# EAGLE schematic MEM_MUX_3 (EAGLE 6.5.0)

## Sheet 1 of 18
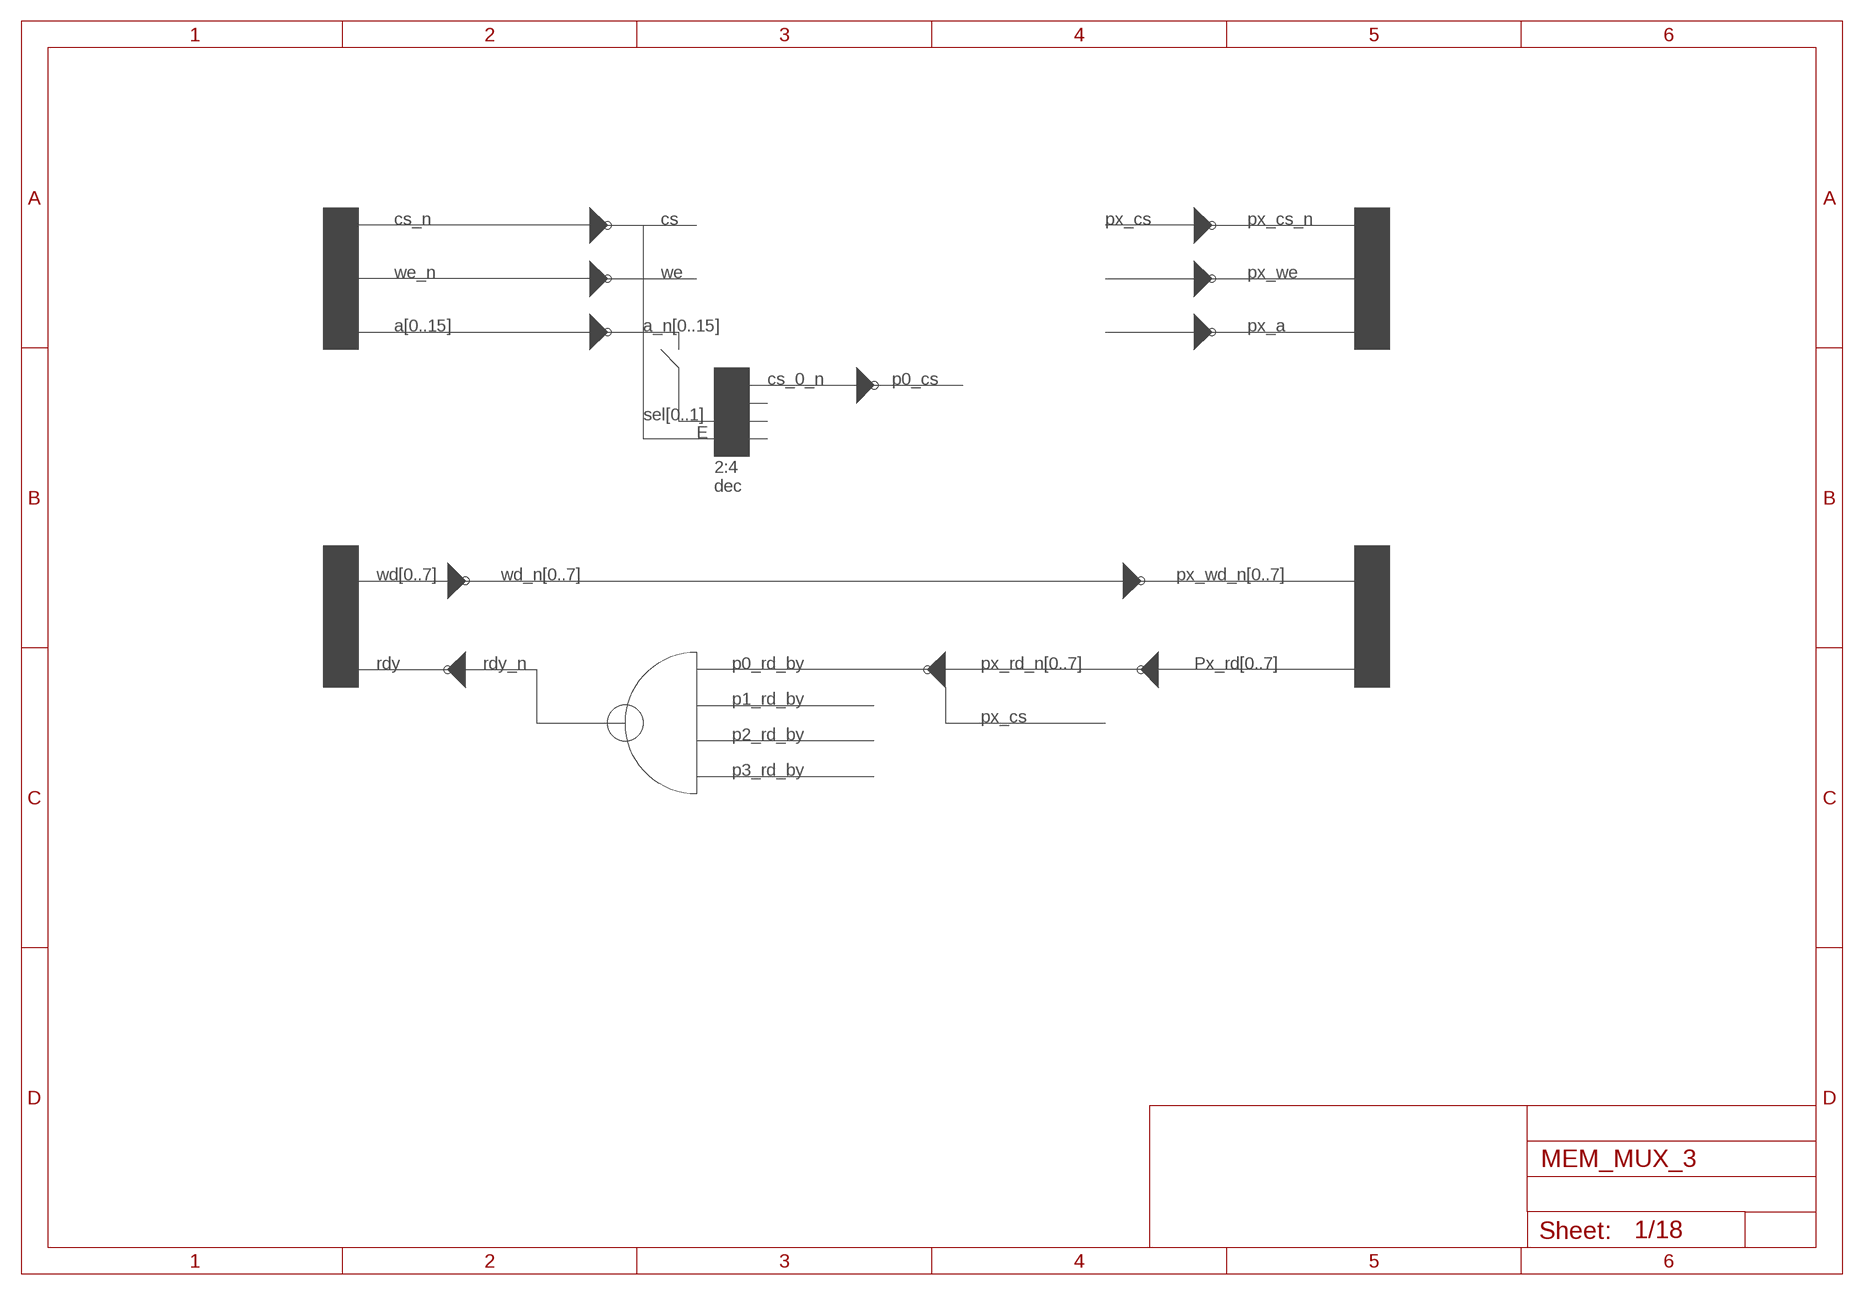
[diagram p0: schematic, sheet 1]

### Notes on the sheet
- cs_n | cs | px_cs | px_cs_n
- we_n | we | px_we
- a[0..15] | a_n[0..15] | px_a
- cs_0_n | p0_cs
- sel[0..1]
- E
- 2:4
  dec
- wd[0..7] | wd_n[0..7] | px_wd_n[0..7]
- rdy | rdy_n | p0_rd_by | px_rd_n[0..7] | Px_rd[0..7]
- p1_rd_by
- px_cs
- p2_rd_by
- p3_rd_by

## Sheet 2 of 18
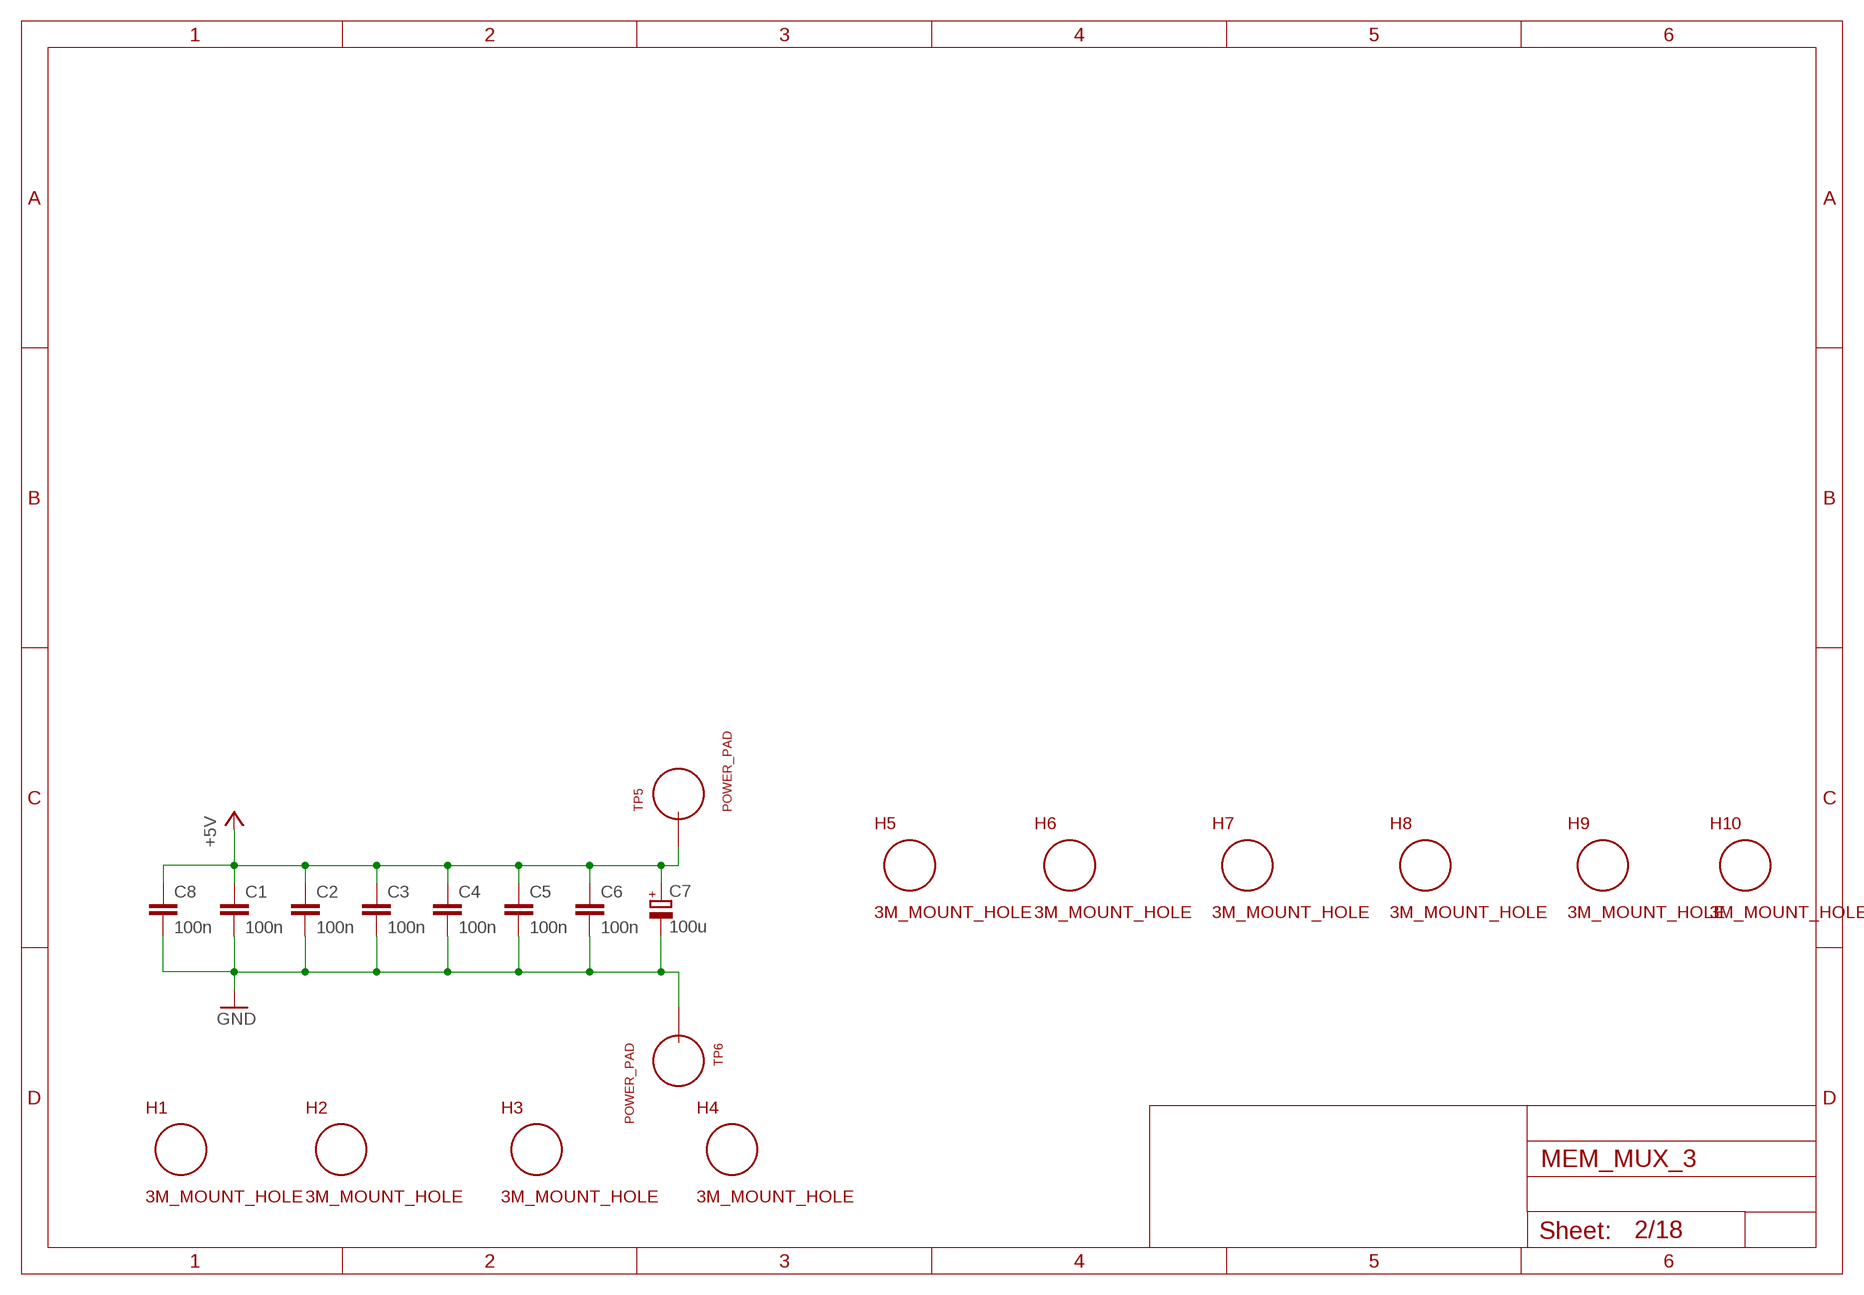
[diagram p1: schematic, sheet 2]

### Parts
C1  100n  C_P2INCH  [CAP_P2INCH]
C2  100n  C_P2INCH  [CAP_P2INCH]
C3  100n  C_P2INCH  [CAP_P2INCH]
C4  100n  C_P2INCH  [CAP_P2INCH]
C5  100n  C_P2INCH  [CAP_P2INCH]
C6  100n  C_P2INCH  [CAP_P2INCH]
C7  100u  POLARISED_CAP_2P5_6P3MM  [POLARISED_CAP_2P5_6P3MM]
C8  100n  C_P2INCH  [CAP_P2INCH]
H1  3M_MOUNT_HOLE  [3M_HOLE]
H2  3M_MOUNT_HOLE  [3M_HOLE]
H3  3M_MOUNT_HOLE  [3M_HOLE]
H4  3M_MOUNT_HOLE  [3M_HOLE]
H5  3M_MOUNT_HOLE  [3M_HOLE]
H6  3M_MOUNT_HOLE  [3M_HOLE]
H7  3M_MOUNT_HOLE  [3M_HOLE]
H8  3M_MOUNT_HOLE  [3M_HOLE]
H9  3M_MOUNT_HOLE  [3M_HOLE]
H10  3M_MOUNT_HOLE  [3M_HOLE]
TP5  POWER_PAD  [POWER_PAD]
TP6  POWER_PAD  [POWER_PAD]

### Nets
+5V: C1.1 C2.1 C3.1 C4.1 C5.1 C6.1 C7.A C8.1 TP5.1 ; also sheet 3,4,5,6,7,8,9,10,11,12,13,14,15,16,17,18
GND: C1.2 C2.2 C3.2 C4.2 C5.2 C6.2 C7.K C8.2 TP6.1 ; also sheet 3,4,5,6,7,8,9,10,11,12,13,14,15,16,17,18

## Sheet 3 of 18
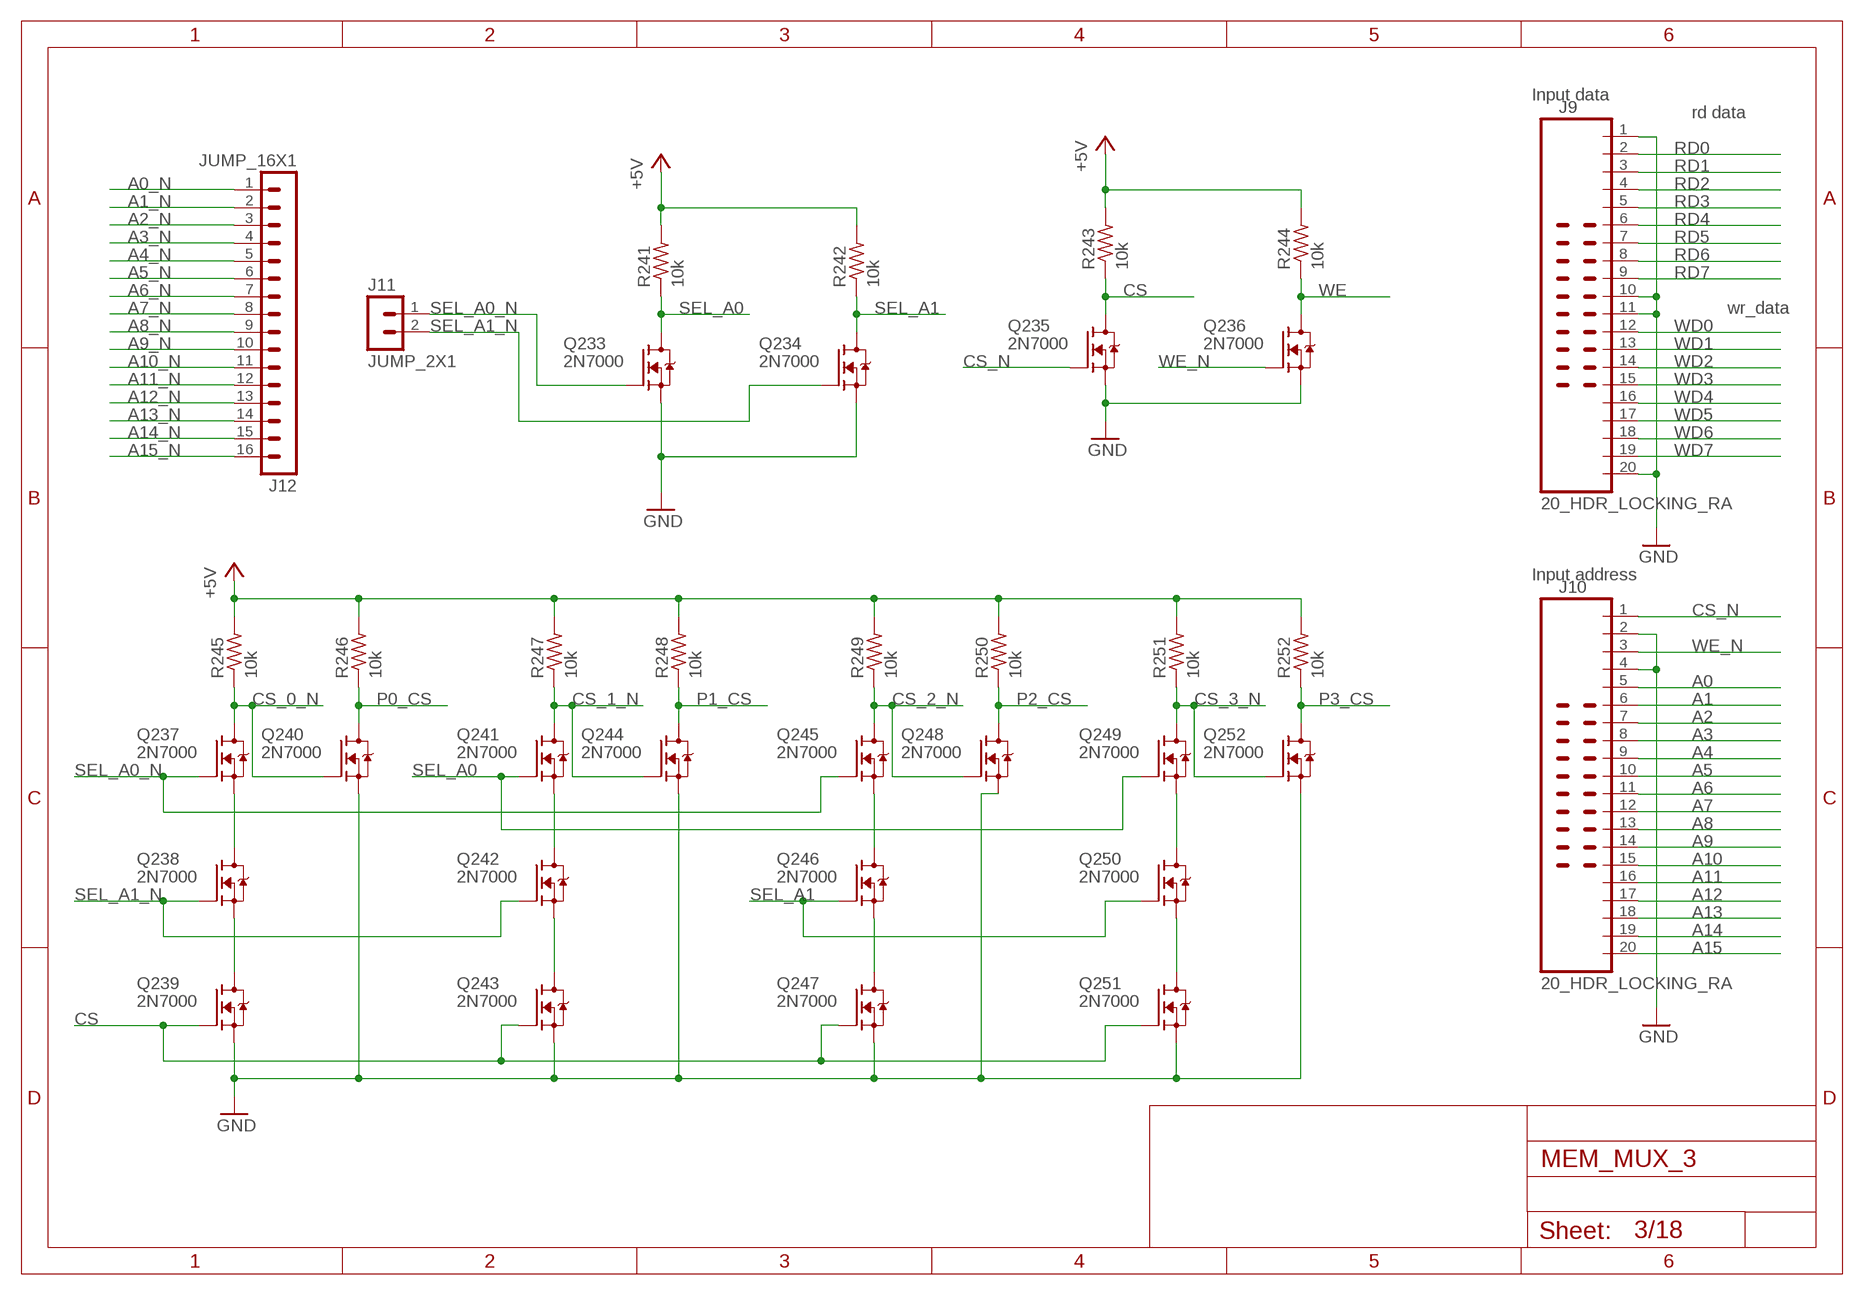
[diagram p2: schematic, sheet 3]

### Parts
J9  20_HDR_LOCKING_RA  [20_HDR_LOCKING_RA]
J10  20_HDR_LOCKING_RA  [20_HDR_LOCKING_RA]
J11  JUMP_2X1  [JUMP_2X1]
J12  JUMP_16X1  [JUMP_16X1]
Q233  2N7000  [TO92-DGS]
Q234  2N7000  [TO92-DGS]
Q235  2N7000  [TO92-DGS]
Q236  2N7000  [TO92-DGS]
Q237  2N7000  [TO92-DGS]
Q238  2N7000  [TO92-DGS]
Q239  2N7000  [TO92-DGS]
Q240  2N7000  [TO92-DGS]
Q241  2N7000  [TO92-DGS]
Q242  2N7000  [TO92-DGS]
Q243  2N7000  [TO92-DGS]
Q244  2N7000  [TO92-DGS]
Q245  2N7000  [TO92-DGS]
Q246  2N7000  [TO92-DGS]
Q247  2N7000  [TO92-DGS]
Q248  2N7000  [TO92-DGS]
Q249  2N7000  [TO92-DGS]
Q250  2N7000  [TO92-DGS]
Q251  2N7000  [TO92-DGS]
Q252  2N7000  [TO92-DGS]
R241  10k  R_P2INCH  [R_P2INCH]
R242  10k  R_P2INCH  [R_P2INCH]
R243  10k  R_P2INCH  [R_P2INCH]
R244  10k  R_P2INCH  [R_P2INCH]
R245  10k  R_P2INCH  [R_P2INCH]
R246  10k  R_P2INCH  [R_P2INCH]
R247  10k  R_P2INCH  [R_P2INCH]
R248  10k  R_P2INCH  [R_P2INCH]
R249  10k  R_P2INCH  [R_P2INCH]
R250  10k  R_P2INCH  [R_P2INCH]
R251  10k  R_P2INCH  [R_P2INCH]
R252  10k  R_P2INCH  [R_P2INCH]

### Nets
+5V: R241.2 R242.2 R243.2 R244.2 R245.2 R246.2 R247.2 R248.2 R249.2 R250.2 R251.2 R252.2 ; also sheet 2,4,5,6,7,8,9,10,11,12,13,14,15,16,17,18
A0: J10.5 ; also sheet 4
A0_N: J12.1 ; also sheet 4,7,10,13,16
A1: J10.6 ; also sheet 4
A1_N: J12.2 ; also sheet 4,7,10,13,16
A2: J10.7 ; also sheet 4
A2_N: J12.3 ; also sheet 4,7,10,13,16
A3: J10.8 ; also sheet 4
A3_N: J12.4 ; also sheet 4,7,10,13,16
A4: J10.9 ; also sheet 4
A4_N: J12.5 ; also sheet 4,7,10,13,16
A5: J10.10 ; also sheet 4
A5_N: J12.6 ; also sheet 4,7,10,13,16
A6: J10.11 ; also sheet 4
A6_N: J12.7 ; also sheet 4,7,10,13,16
A7: J10.12 ; also sheet 4
A7_N: J12.8 ; also sheet 4,7,10,13,16
A8: J10.13 ; also sheet 4
A8_N: J12.9 ; also sheet 4,7,10,13,16
A9: J10.14 ; also sheet 4
A9_N: J12.10 ; also sheet 4,7,10,13,16
A10: J10.15 ; also sheet 4
A10_N: J12.11 ; also sheet 4,7,10,13,16
A11: J10.16 ; also sheet 4
A11_N: J12.12 ; also sheet 4,7,10,13,16
A12: J10.17 ; also sheet 4
A12_N: J12.13 ; also sheet 4,7,10,13,16
A13: J10.18 ; also sheet 4
A13_N: J12.14 ; also sheet 4,7,10,13,16
A14: J10.19 ; also sheet 4
A14_N: J12.15 ; also sheet 4,7,10,13,16
A15: J10.20 ; also sheet 4
A15_N: J12.16 ; also sheet 4,7,10,13,16
CS: Q235.D Q239.G Q243.G Q247.G Q251.G R243.1
CS_0_N: Q237.D Q240.G R245.1 ; also sheet 5
CS_1_N: Q241.D Q244.G R247.1 ; also sheet 8
CS_2_N: Q245.D Q248.G R249.1 ; also sheet 11
CS_3_N: Q249.D Q252.G R251.1 ; also sheet 14
CS_N: J10.1 Q235.G
GND: J9.1 J9.10 J9.11 J9.20 J10.2 J10.4 Q233.S Q234.S Q235.S Q236.S Q239.S Q240.S Q243.S Q244.S Q247.S Q248.S Q251.S Q252.S ; also sheet 2,4,5,6,7,8,9,10,11,12,13,14,15,16,17,18
N$100: Q241.S Q242.D
N$101: Q237.S Q238.D
N$102: Q238.S Q239.D
N$103: Q242.S Q243.D
N$104: Q245.S Q246.D
N$105: Q246.S Q247.D
N$106: Q249.S Q250.D
N$107: Q250.S Q251.D
P0_CS: Q240.D R246.1 ; also sheet 6
P1_CS: Q244.D R248.1 ; also sheet 9
P2_CS: Q248.D R250.1 ; also sheet 12
P3_CS: Q252.D R252.1 ; also sheet 15
RD0: J9.2 ; also sheet 17
RD1: J9.3 ; also sheet 17
RD2: J9.4 ; also sheet 17
RD3: J9.5 ; also sheet 17
RD4: J9.6 ; also sheet 18
RD5: J9.7 ; also sheet 18
RD6: J9.8 ; also sheet 18
RD7: J9.9 ; also sheet 18
SEL_A0: Q233.D Q241.G Q249.G R241.1
SEL_A0_N: J11.1 Q233.G Q237.G Q245.G
SEL_A1: Q234.D Q246.G Q250.G R242.1
SEL_A1_N: J11.2 Q234.G Q238.G Q242.G
WD0: J9.12 ; also sheet 4
WD1: J9.13 ; also sheet 4
WD2: J9.14 ; also sheet 4
WD3: J9.15 ; also sheet 4
WD4: J9.16 ; also sheet 4
WD5: J9.17 ; also sheet 4
WD6: J9.18 ; also sheet 4
WD7: J9.19 ; also sheet 4
WE: Q236.D R244.1 ; also sheet 6,9,12,15
WE_N: J10.3 Q236.G

### Notes on the sheet
- Input data
- rd data
- wr_data
- Input address

## Sheet 4 of 18
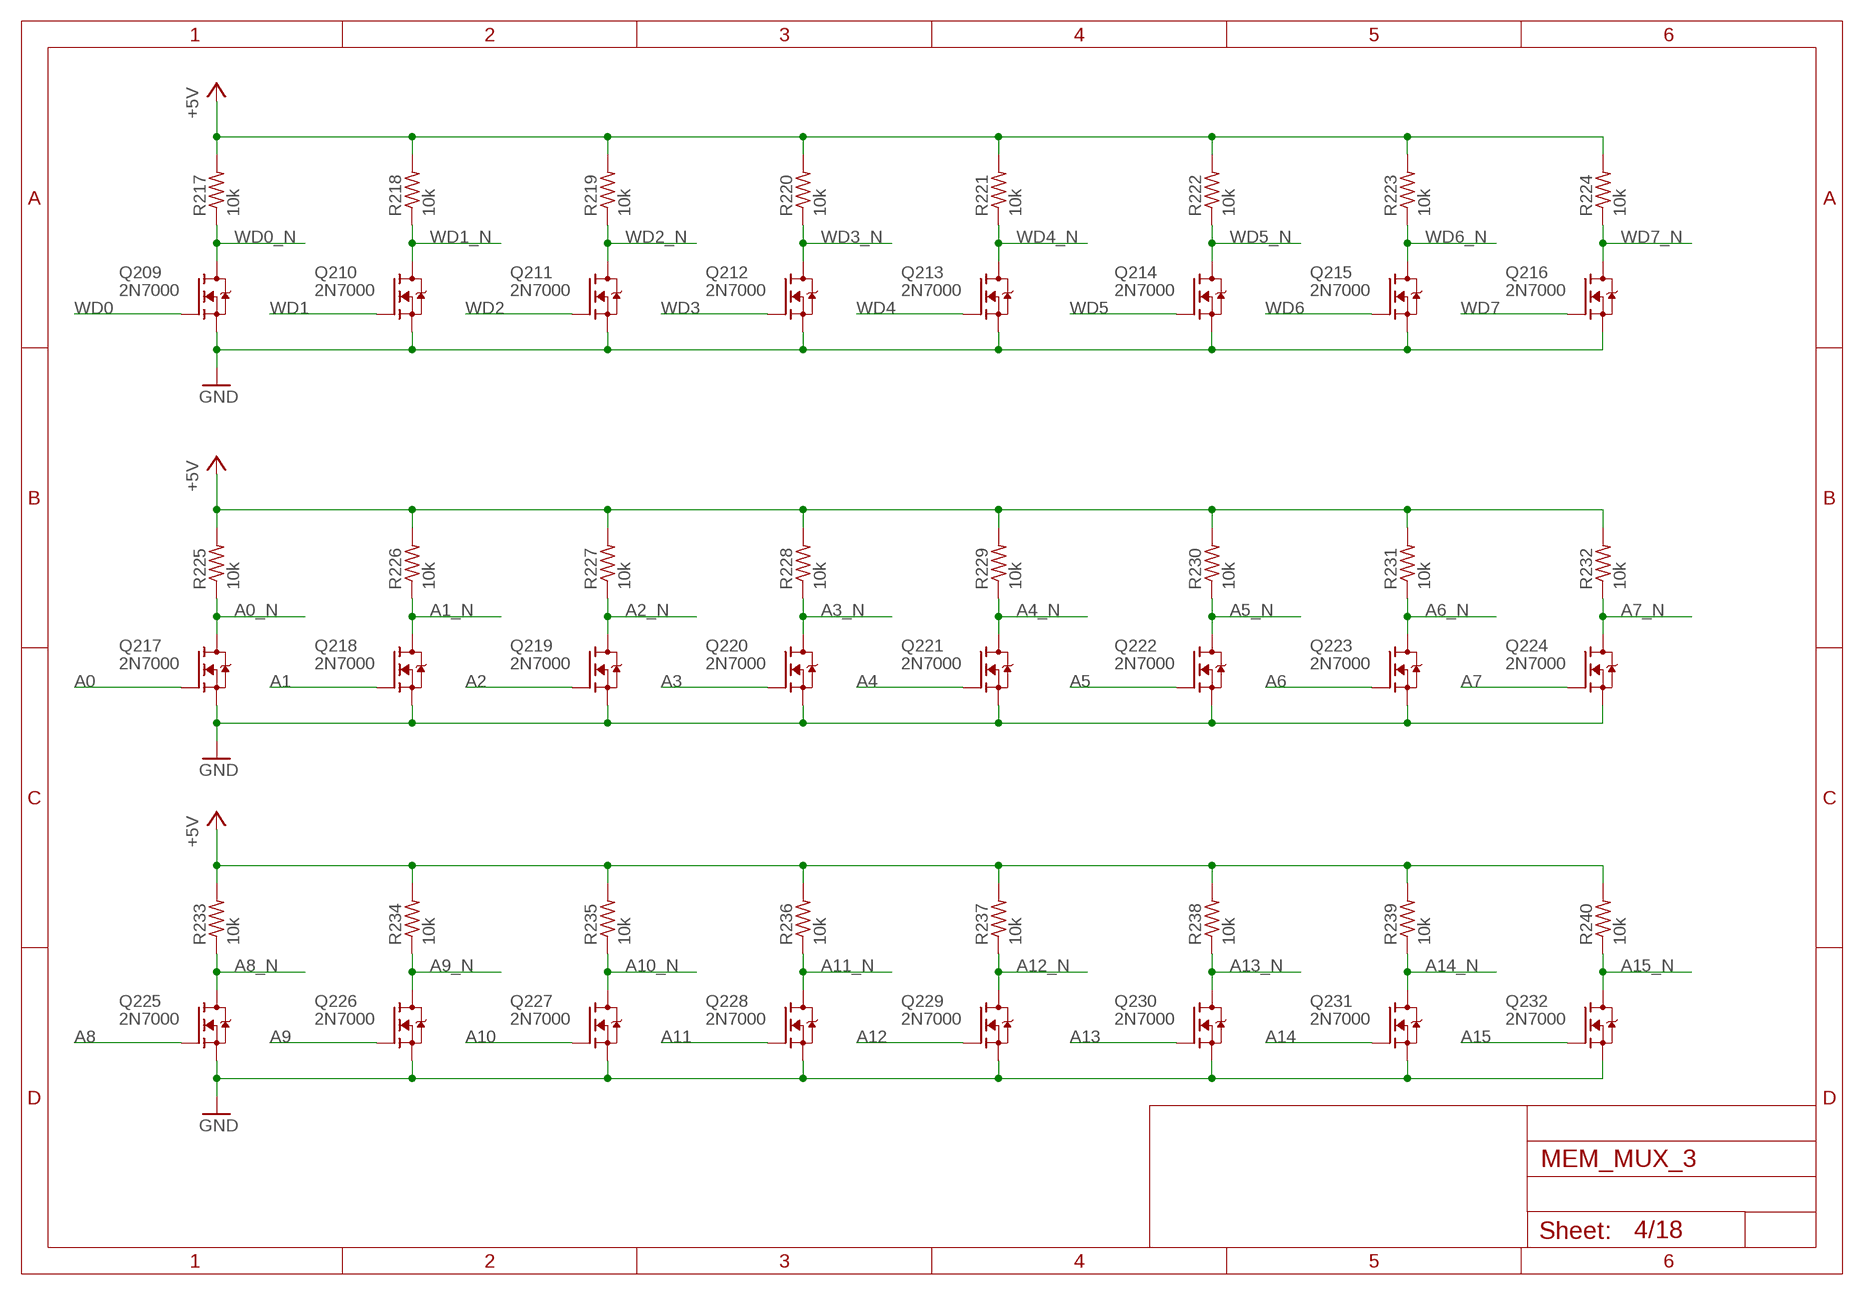
[diagram p3: schematic, sheet 4]

### Parts
Q209  2N7000  [TO92-DGS]
Q210  2N7000  [TO92-DGS]
Q211  2N7000  [TO92-DGS]
Q212  2N7000  [TO92-DGS]
Q213  2N7000  [TO92-DGS]
Q214  2N7000  [TO92-DGS]
Q215  2N7000  [TO92-DGS]
Q216  2N7000  [TO92-DGS]
Q217  2N7000  [TO92-DGS]
Q218  2N7000  [TO92-DGS]
Q219  2N7000  [TO92-DGS]
Q220  2N7000  [TO92-DGS]
Q221  2N7000  [TO92-DGS]
Q222  2N7000  [TO92-DGS]
Q223  2N7000  [TO92-DGS]
Q224  2N7000  [TO92-DGS]
Q225  2N7000  [TO92-DGS]
Q226  2N7000  [TO92-DGS]
Q227  2N7000  [TO92-DGS]
Q228  2N7000  [TO92-DGS]
Q229  2N7000  [TO92-DGS]
Q230  2N7000  [TO92-DGS]
Q231  2N7000  [TO92-DGS]
Q232  2N7000  [TO92-DGS]
R217  10k  R_P2INCH  [R_P2INCH]
R218  10k  R_P2INCH  [R_P2INCH]
R219  10k  R_P2INCH  [R_P2INCH]
R220  10k  R_P2INCH  [R_P2INCH]
R221  10k  R_P2INCH  [R_P2INCH]
R222  10k  R_P2INCH  [R_P2INCH]
R223  10k  R_P2INCH  [R_P2INCH]
R224  10k  R_P2INCH  [R_P2INCH]
R225  10k  R_P2INCH  [R_P2INCH]
R226  10k  R_P2INCH  [R_P2INCH]
R227  10k  R_P2INCH  [R_P2INCH]
R228  10k  R_P2INCH  [R_P2INCH]
R229  10k  R_P2INCH  [R_P2INCH]
R230  10k  R_P2INCH  [R_P2INCH]
R231  10k  R_P2INCH  [R_P2INCH]
R232  10k  R_P2INCH  [R_P2INCH]
R233  10k  R_P2INCH  [R_P2INCH]
R234  10k  R_P2INCH  [R_P2INCH]
R235  10k  R_P2INCH  [R_P2INCH]
R236  10k  R_P2INCH  [R_P2INCH]
R237  10k  R_P2INCH  [R_P2INCH]
R238  10k  R_P2INCH  [R_P2INCH]
R239  10k  R_P2INCH  [R_P2INCH]
R240  10k  R_P2INCH  [R_P2INCH]

### Nets
+5V: R217.2 R218.2 R219.2 R220.2 R221.2 R222.2 R223.2 R224.2 R225.2 R226.2 R227.2 R228.2 R229.2 R230.2 R231.2 R232.2 R233.2 R234.2 R235.2 R236.2 R237.2 R238.2 R239.2 R240.2 ; also sheet 2,3,5,6,7,8,9,10,11,12,13,14,15,16,17,18
A0: Q217.G ; also sheet 3
A0_N: Q217.D R225.1 ; also sheet 3,7,10,13,16
A1: Q218.G ; also sheet 3
A1_N: Q218.D R226.1 ; also sheet 3,7,10,13,16
A2: Q219.G ; also sheet 3
A2_N: Q219.D R227.1 ; also sheet 3,7,10,13,16
A3: Q220.G ; also sheet 3
A3_N: Q220.D R228.1 ; also sheet 3,7,10,13,16
A4: Q221.G ; also sheet 3
A4_N: Q221.D R229.1 ; also sheet 3,7,10,13,16
A5: Q222.G ; also sheet 3
A5_N: Q222.D R230.1 ; also sheet 3,7,10,13,16
A6: Q223.G ; also sheet 3
A6_N: Q223.D R231.1 ; also sheet 3,7,10,13,16
A7: Q224.G ; also sheet 3
A7_N: Q224.D R232.1 ; also sheet 3,7,10,13,16
A8: Q225.G ; also sheet 3
A8_N: Q225.D R233.1 ; also sheet 3,7,10,13,16
A9: Q226.G ; also sheet 3
A9_N: Q226.D R234.1 ; also sheet 3,7,10,13,16
A10: Q227.G ; also sheet 3
A10_N: Q227.D R235.1 ; also sheet 3,7,10,13,16
A11: Q228.G ; also sheet 3
A11_N: Q228.D R236.1 ; also sheet 3,7,10,13,16
A12: Q229.G ; also sheet 3
A12_N: Q229.D R237.1 ; also sheet 3,7,10,13,16
A13: Q230.G ; also sheet 3
A13_N: Q230.D R238.1 ; also sheet 3,7,10,13,16
A14: Q231.G ; also sheet 3
A14_N: Q231.D R239.1 ; also sheet 3,7,10,13,16
A15: Q232.G ; also sheet 3
A15_N: Q232.D R240.1 ; also sheet 3,7,10,13,16
GND: Q209.S Q210.S Q211.S Q212.S Q213.S Q214.S Q215.S Q216.S Q217.S Q218.S Q219.S Q220.S Q221.S Q222.S Q223.S Q224.S Q225.S Q226.S Q227.S Q228.S Q229.S Q230.S Q231.S Q232.S ; also sheet 2,3,5,6,7,8,9,10,11,12,13,14,15,16,17,18
WD0: Q209.G ; also sheet 3
WD0_N: Q209.D R217.1 ; also sheet 7,10,13,16
WD1: Q210.G ; also sheet 3
WD1_N: Q210.D R218.1 ; also sheet 7,10,13,16
WD2: Q211.G ; also sheet 3
WD2_N: Q211.D R219.1 ; also sheet 7,10,13,16
WD3: Q212.G ; also sheet 3
WD3_N: Q212.D R220.1 ; also sheet 7,10,13,16
WD4: Q213.G ; also sheet 3
WD4_N: Q213.D R221.1 ; also sheet 7,10,13,16
WD5: Q214.G ; also sheet 3
WD5_N: Q214.D R222.1 ; also sheet 7,10,13,16
WD6: Q215.G ; also sheet 3
WD6_N: Q215.D R223.1 ; also sheet 7,10,13,16
WD7: Q216.G ; also sheet 3
WD7_N: Q216.D R224.1 ; also sheet 7,10,13,16

## Sheet 5 of 18
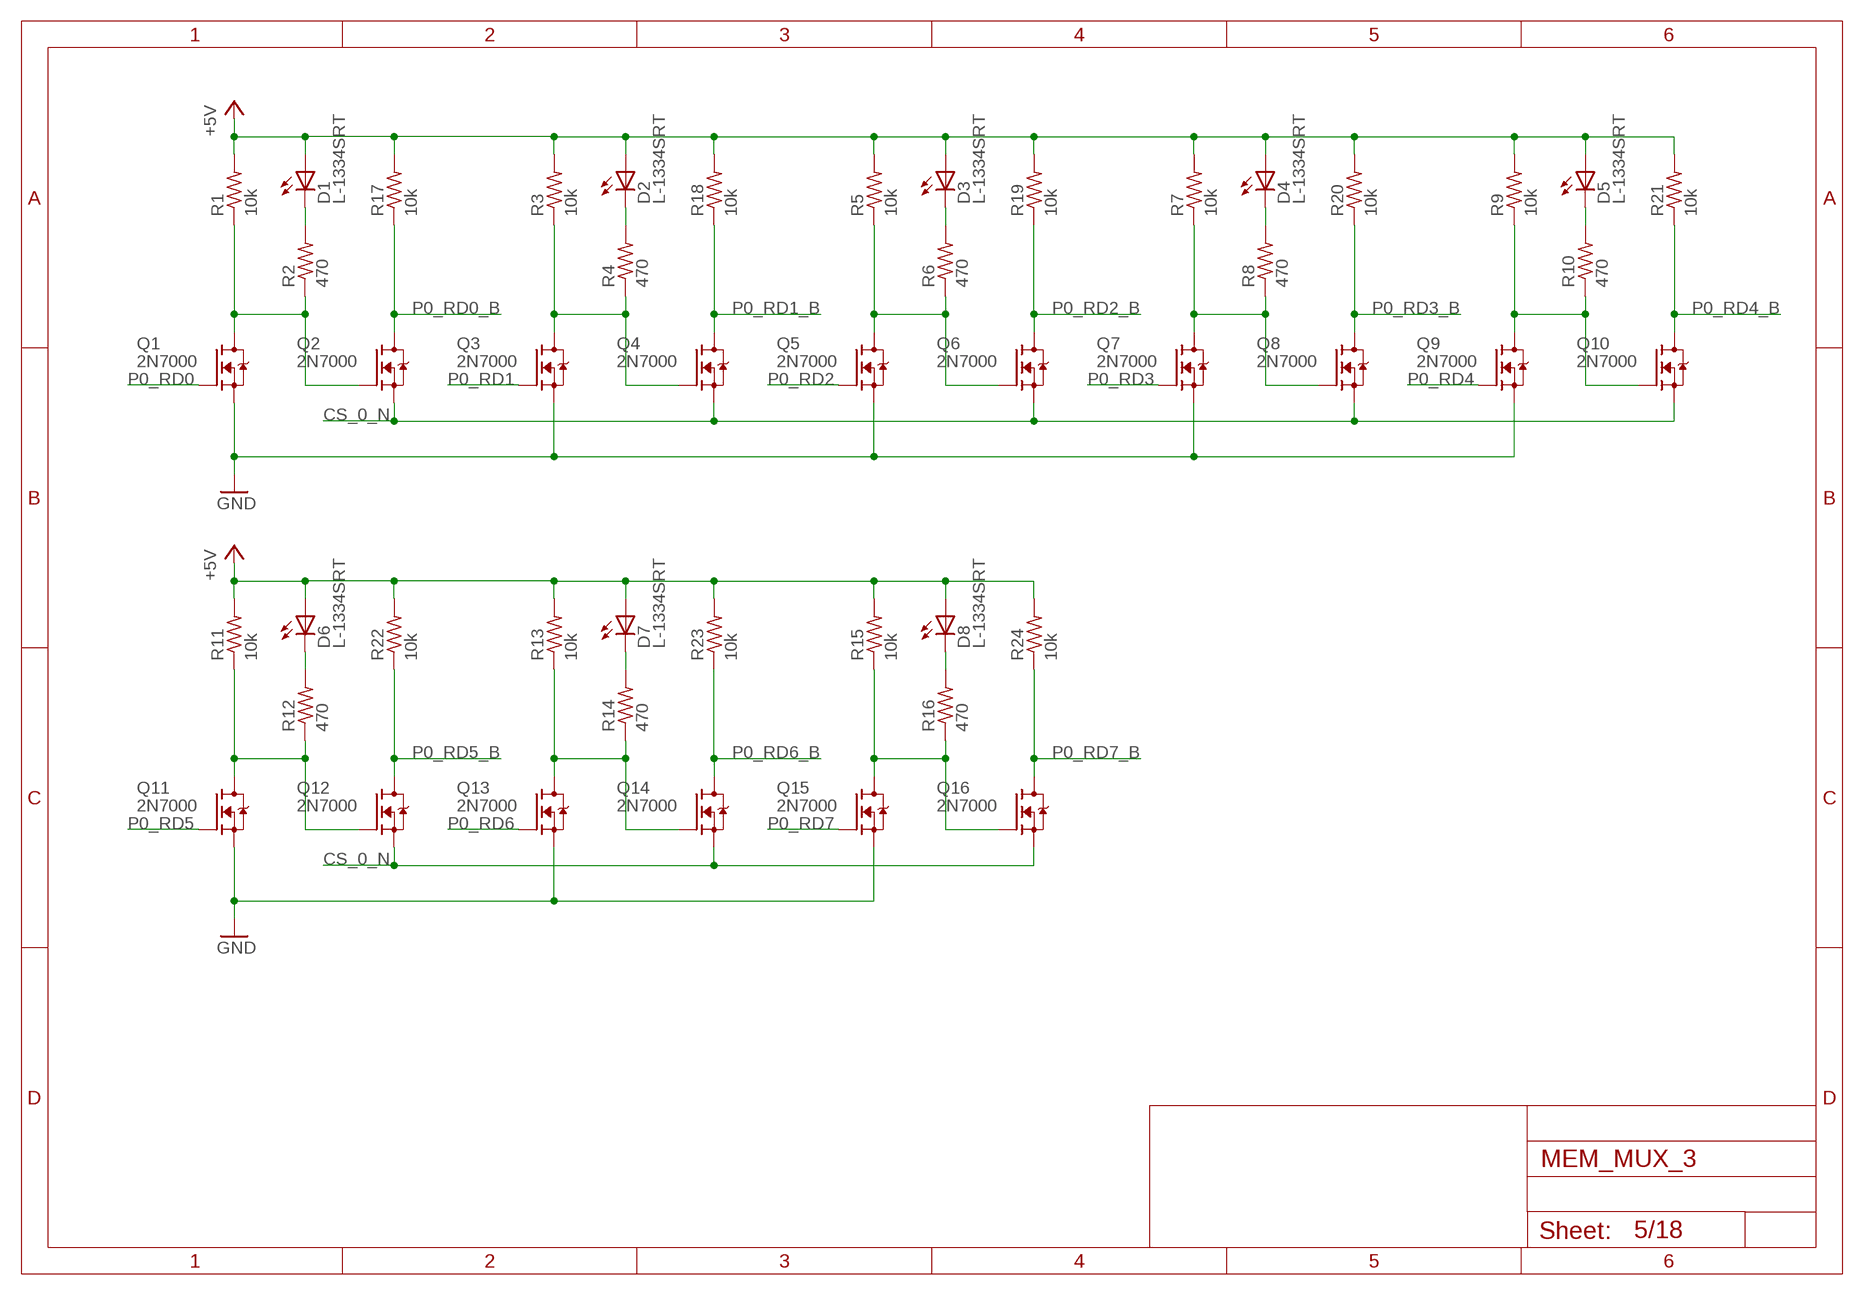
[diagram p4: schematic, sheet 5]

### Parts
D1  L-1334SRT  [LED3MM]
D2  L-1334SRT  [LED3MM]
D3  L-1334SRT  [LED3MM]
D4  L-1334SRT  [LED3MM]
D5  L-1334SRT  [LED3MM]
D6  L-1334SRT  [LED3MM]
D7  L-1334SRT  [LED3MM]
D8  L-1334SRT  [LED3MM]
Q1  2N7000  [TO92-DGS]
Q2  2N7000  [TO92-DGS]
Q3  2N7000  [TO92-DGS]
Q4  2N7000  [TO92-DGS]
Q5  2N7000  [TO92-DGS]
Q6  2N7000  [TO92-DGS]
Q7  2N7000  [TO92-DGS]
Q8  2N7000  [TO92-DGS]
Q9  2N7000  [TO92-DGS]
Q10  2N7000  [TO92-DGS]
Q11  2N7000  [TO92-DGS]
Q12  2N7000  [TO92-DGS]
Q13  2N7000  [TO92-DGS]
Q14  2N7000  [TO92-DGS]
Q15  2N7000  [TO92-DGS]
Q16  2N7000  [TO92-DGS]
R1  10k  R_P2INCH  [R_P2INCH]
R2  470  R_P2INCH  [R_P2INCH]
R3  10k  R_P2INCH  [R_P2INCH]
R4  470  R_P2INCH  [R_P2INCH]
R5  10k  R_P2INCH  [R_P2INCH]
R6  470  R_P2INCH  [R_P2INCH]
R7  10k  R_P2INCH  [R_P2INCH]
R8  470  R_P2INCH  [R_P2INCH]
R9  10k  R_P2INCH  [R_P2INCH]
R10  470  R_P2INCH  [R_P2INCH]
R11  10k  R_P2INCH  [R_P2INCH]
R12  470  R_P2INCH  [R_P2INCH]
R13  10k  R_P2INCH  [R_P2INCH]
R14  470  R_P2INCH  [R_P2INCH]
R15  10k  R_P2INCH  [R_P2INCH]
R16  470  R_P2INCH  [R_P2INCH]
R17  10k  R_P2INCH  [R_P2INCH]
R18  10k  R_P2INCH  [R_P2INCH]
R19  10k  R_P2INCH  [R_P2INCH]
R20  10k  R_P2INCH  [R_P2INCH]
R21  10k  R_P2INCH  [R_P2INCH]
R22  10k  R_P2INCH  [R_P2INCH]
R23  10k  R_P2INCH  [R_P2INCH]
R24  10k  R_P2INCH  [R_P2INCH]

### Nets
+5V: D1.A D2.A D3.A D4.A D5.A D6.A D7.A D8.A R1.2 R3.2 R5.2 R7.2 R9.2 R11.2 R13.2 R15.2 R17.2 R18.2 R19.2 R20.2 R21.2 R22.2 R23.2 R24.2 ; also sheet 2,3,4,6,7,8,9,10,11,12,13,14,15,16,17,18
CS_0_N: Q2.S Q4.S Q6.S Q8.S Q10.S Q12.S Q14.S Q16.S ; also sheet 3
GND: Q1.S Q3.S Q5.S Q7.S Q9.S Q11.S Q13.S Q15.S ; also sheet 2,3,4,6,7,8,9,10,11,12,13,14,15,16,17,18
N$1: Q3.D Q4.G R3.1 R4.1
N$2: Q1.D Q2.G R1.1 R2.1
N$3: D1.K(C) R2.2
N$4: D2.K(C) R4.2
N$5: Q5.D Q6.G R5.1 R6.1
N$6: D3.K(C) R6.2
N$7: Q7.D Q8.G R7.1 R8.1
N$8: D4.K(C) R8.2
N$9: Q9.D Q10.G R9.1 R10.1
N$10: D5.K(C) R10.2
N$12: Q11.D Q12.G R11.1 R12.1
N$13: D6.K(C) R12.2
N$14: Q13.D Q14.G R13.1 R14.1
N$15: D7.K(C) R14.2
N$16: Q15.D Q16.G R15.1 R16.1
N$17: D8.K(C) R16.2
P0_RD0: Q1.G ; also sheet 6
P0_RD0_B: Q2.D R17.1 ; also sheet 17
P0_RD1: Q3.G ; also sheet 6
P0_RD1_B: Q4.D R18.1 ; also sheet 17
P0_RD2: Q5.G ; also sheet 6
P0_RD2_B: Q6.D R19.1 ; also sheet 17
P0_RD3: Q7.G ; also sheet 6
P0_RD3_B: Q8.D R20.1 ; also sheet 17
P0_RD4: Q9.G ; also sheet 6
P0_RD4_B: Q10.D R21.1 ; also sheet 18
P0_RD5: Q11.G ; also sheet 6
P0_RD5_B: Q12.D R22.1 ; also sheet 18
P0_RD6: Q13.G ; also sheet 6
P0_RD6_B: Q14.D R23.1 ; also sheet 18
P0_RD7: Q15.G ; also sheet 6
P0_RD7_B: Q16.D R24.1 ; also sheet 18

## Sheet 6 of 18
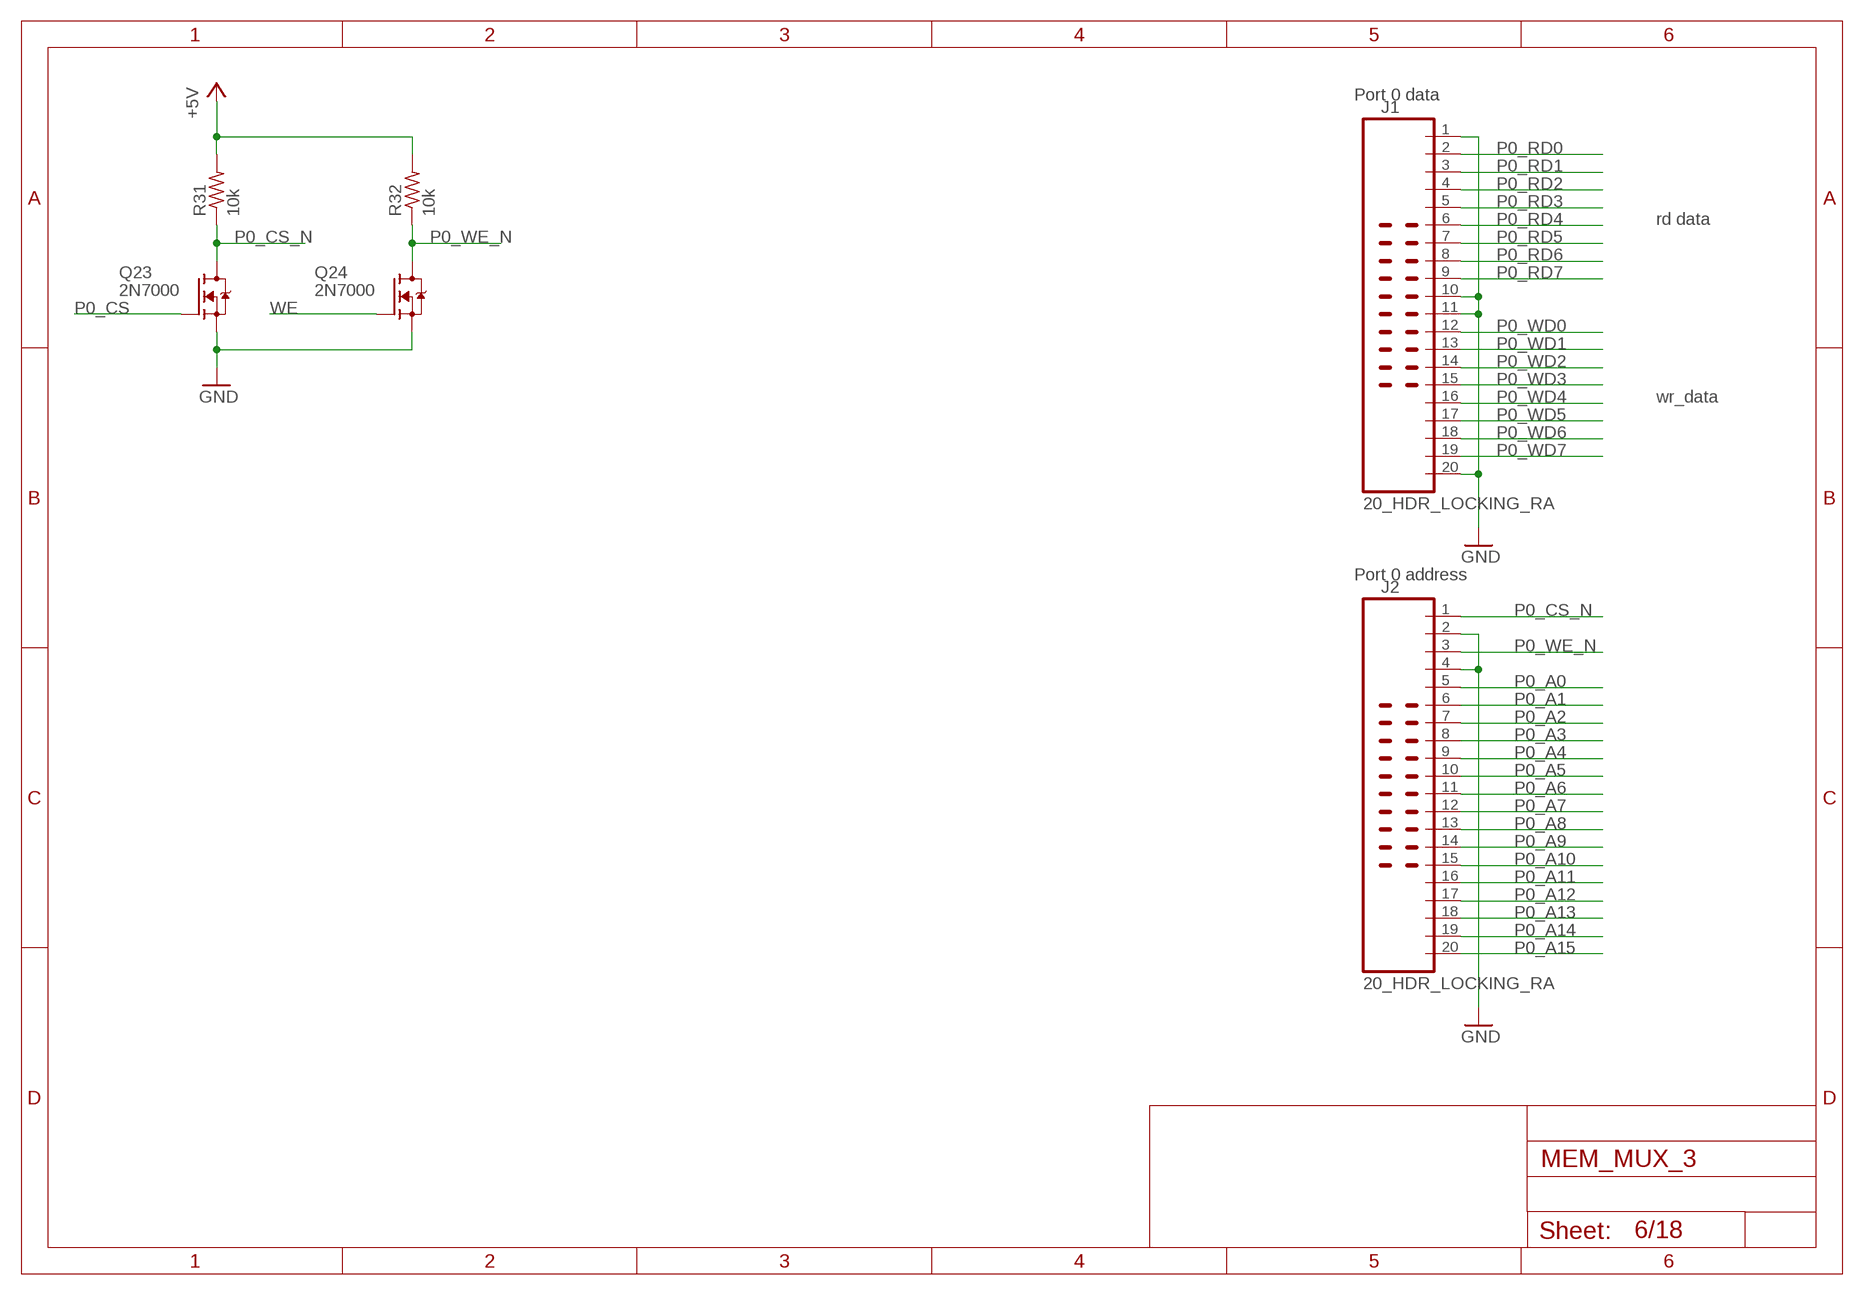
[diagram p5: schematic, sheet 6]

### Parts
J1  20_HDR_LOCKING_RA  [20_HDR_LOCKING_RA]
J2  20_HDR_LOCKING_RA  [20_HDR_LOCKING_RA]
Q23  2N7000  [TO92-DGS]
Q24  2N7000  [TO92-DGS]
R31  10k  R_P2INCH  [R_P2INCH]
R32  10k  R_P2INCH  [R_P2INCH]

### Nets
+5V: R31.2 R32.2 ; also sheet 2,3,4,5,7,8,9,10,11,12,13,14,15,16,17,18
GND: J1.1 J1.10 J1.11 J1.20 J2.2 J2.4 Q23.S Q24.S ; also sheet 2,3,4,5,7,8,9,10,11,12,13,14,15,16,17,18
P0_A0: J2.5 ; also sheet 7
P0_A1: J2.6 ; also sheet 7
P0_A2: J2.7 ; also sheet 7
P0_A3: J2.8 ; also sheet 7
P0_A4: J2.9 ; also sheet 7
P0_A5: J2.10 ; also sheet 7
P0_A6: J2.11 ; also sheet 7
P0_A7: J2.12 ; also sheet 7
P0_A8: J2.13 ; also sheet 7
P0_A9: J2.14 ; also sheet 7
P0_A10: J2.15 ; also sheet 7
P0_A11: J2.16 ; also sheet 7
P0_A12: J2.17 ; also sheet 7
P0_A13: J2.18 ; also sheet 7
P0_A14: J2.19 ; also sheet 7
P0_A15: J2.20 ; also sheet 7
P0_CS: Q23.G ; also sheet 3
P0_CS_N: J2.1 Q23.D R31.1
P0_RD0: J1.2 ; also sheet 5
P0_RD1: J1.3 ; also sheet 5
P0_RD2: J1.4 ; also sheet 5
P0_RD3: J1.5 ; also sheet 5
P0_RD4: J1.6 ; also sheet 5
P0_RD5: J1.7 ; also sheet 5
P0_RD6: J1.8 ; also sheet 5
P0_RD7: J1.9 ; also sheet 5
P0_WD0: J1.12 ; also sheet 7
P0_WD1: J1.13 ; also sheet 7
P0_WD2: J1.14 ; also sheet 7
P0_WD3: J1.15 ; also sheet 7
P0_WD4: J1.16 ; also sheet 7
P0_WD5: J1.17 ; also sheet 7
P0_WD6: J1.18 ; also sheet 7
P0_WD7: J1.19 ; also sheet 7
P0_WE_N: J2.3 Q24.D R32.1
WE: Q24.G ; also sheet 3,9,12,15

### Notes on the sheet
- Port 0 data
- rd data
- wr_data
- Port 0 address

## Sheet 7 of 18
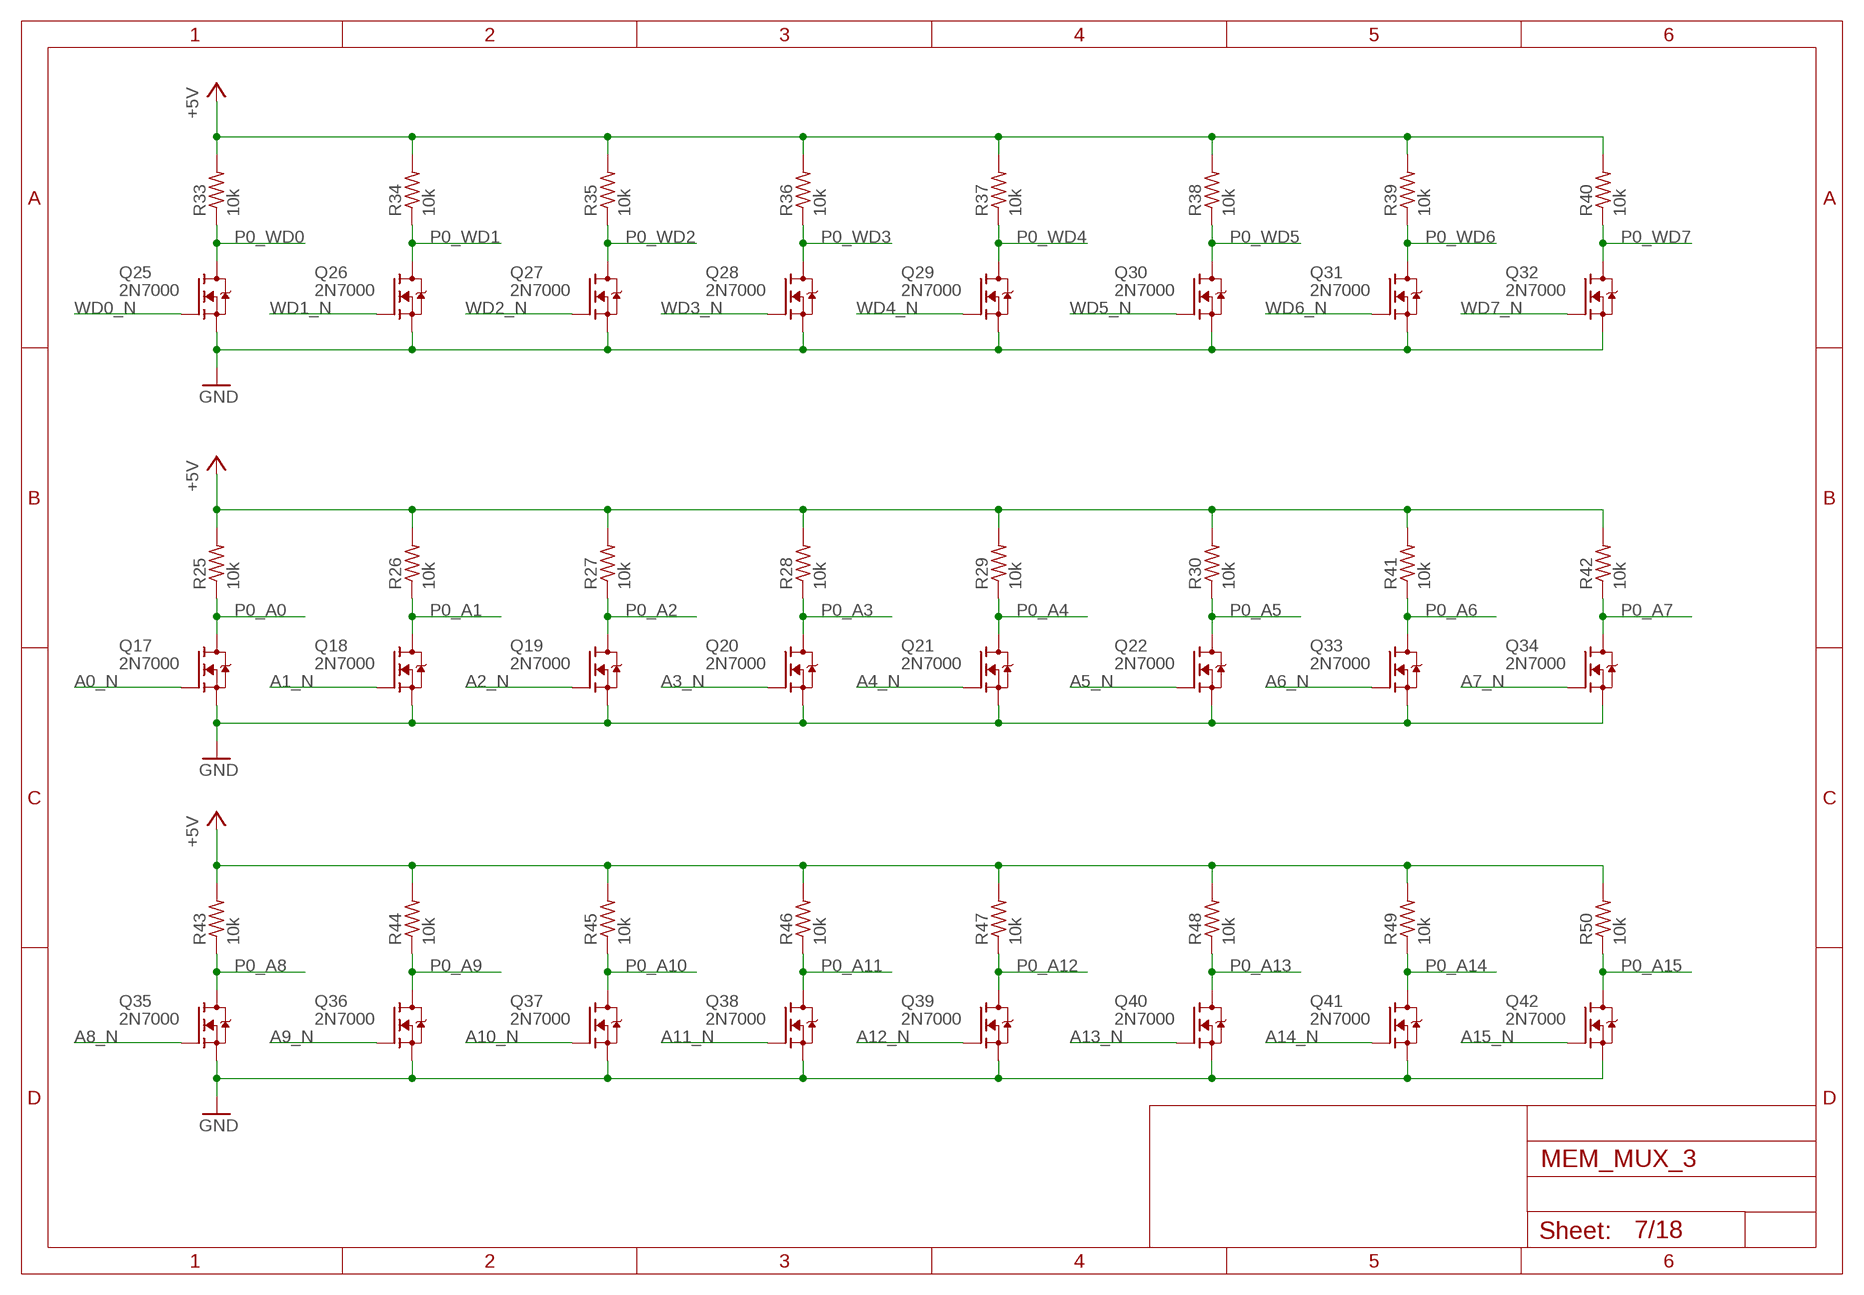
[diagram p6: schematic, sheet 7]

### Parts
Q17  2N7000  [TO92-DGS]
Q18  2N7000  [TO92-DGS]
Q19  2N7000  [TO92-DGS]
Q20  2N7000  [TO92-DGS]
Q21  2N7000  [TO92-DGS]
Q22  2N7000  [TO92-DGS]
Q25  2N7000  [TO92-DGS]
Q26  2N7000  [TO92-DGS]
Q27  2N7000  [TO92-DGS]
Q28  2N7000  [TO92-DGS]
Q29  2N7000  [TO92-DGS]
Q30  2N7000  [TO92-DGS]
Q31  2N7000  [TO92-DGS]
Q32  2N7000  [TO92-DGS]
Q33  2N7000  [TO92-DGS]
Q34  2N7000  [TO92-DGS]
Q35  2N7000  [TO92-DGS]
Q36  2N7000  [TO92-DGS]
Q37  2N7000  [TO92-DGS]
Q38  2N7000  [TO92-DGS]
Q39  2N7000  [TO92-DGS]
Q40  2N7000  [TO92-DGS]
Q41  2N7000  [TO92-DGS]
Q42  2N7000  [TO92-DGS]
R25  10k  R_P2INCH  [R_P2INCH]
R26  10k  R_P2INCH  [R_P2INCH]
R27  10k  R_P2INCH  [R_P2INCH]
R28  10k  R_P2INCH  [R_P2INCH]
R29  10k  R_P2INCH  [R_P2INCH]
R30  10k  R_P2INCH  [R_P2INCH]
R33  10k  R_P2INCH  [R_P2INCH]
R34  10k  R_P2INCH  [R_P2INCH]
R35  10k  R_P2INCH  [R_P2INCH]
R36  10k  R_P2INCH  [R_P2INCH]
R37  10k  R_P2INCH  [R_P2INCH]
R38  10k  R_P2INCH  [R_P2INCH]
R39  10k  R_P2INCH  [R_P2INCH]
R40  10k  R_P2INCH  [R_P2INCH]
R41  10k  R_P2INCH  [R_P2INCH]
R42  10k  R_P2INCH  [R_P2INCH]
R43  10k  R_P2INCH  [R_P2INCH]
R44  10k  R_P2INCH  [R_P2INCH]
R45  10k  R_P2INCH  [R_P2INCH]
R46  10k  R_P2INCH  [R_P2INCH]
R47  10k  R_P2INCH  [R_P2INCH]
R48  10k  R_P2INCH  [R_P2INCH]
R49  10k  R_P2INCH  [R_P2INCH]
R50  10k  R_P2INCH  [R_P2INCH]

### Nets
+5V: R25.2 R26.2 R27.2 R28.2 R29.2 R30.2 R33.2 R34.2 R35.2 R36.2 R37.2 R38.2 R39.2 R40.2 R41.2 R42.2 R43.2 R44.2 R45.2 R46.2 R47.2 R48.2 R49.2 R50.2 ; also sheet 2,3,4,5,6,8,9,10,11,12,13,14,15,16,17,18
A0_N: Q17.G ; also sheet 3,4,10,13,16
A1_N: Q18.G ; also sheet 3,4,10,13,16
A2_N: Q19.G ; also sheet 3,4,10,13,16
A3_N: Q20.G ; also sheet 3,4,10,13,16
A4_N: Q21.G ; also sheet 3,4,10,13,16
A5_N: Q22.G ; also sheet 3,4,10,13,16
A6_N: Q33.G ; also sheet 3,4,10,13,16
A7_N: Q34.G ; also sheet 3,4,10,13,16
A8_N: Q35.G ; also sheet 3,4,10,13,16
A9_N: Q36.G ; also sheet 3,4,10,13,16
A10_N: Q37.G ; also sheet 3,4,10,13,16
A11_N: Q38.G ; also sheet 3,4,10,13,16
A12_N: Q39.G ; also sheet 3,4,10,13,16
A13_N: Q40.G ; also sheet 3,4,10,13,16
A14_N: Q41.G ; also sheet 3,4,10,13,16
A15_N: Q42.G ; also sheet 3,4,10,13,16
GND: Q17.S Q18.S Q19.S Q20.S Q21.S Q22.S Q25.S Q26.S Q27.S Q28.S Q29.S Q30.S Q31.S Q32.S Q33.S Q34.S Q35.S Q36.S Q37.S Q38.S Q39.S Q40.S Q41.S Q42.S ; also sheet 2,3,4,5,6,8,9,10,11,12,13,14,15,16,17,18
P0_A0: Q17.D R25.1 ; also sheet 6
P0_A1: Q18.D R26.1 ; also sheet 6
P0_A2: Q19.D R27.1 ; also sheet 6
P0_A3: Q20.D R28.1 ; also sheet 6
P0_A4: Q21.D R29.1 ; also sheet 6
P0_A5: Q22.D R30.1 ; also sheet 6
P0_A6: Q33.D R41.1 ; also sheet 6
P0_A7: Q34.D R42.1 ; also sheet 6
P0_A8: Q35.D R43.1 ; also sheet 6
P0_A9: Q36.D R44.1 ; also sheet 6
P0_A10: Q37.D R45.1 ; also sheet 6
P0_A11: Q38.D R46.1 ; also sheet 6
P0_A12: Q39.D R47.1 ; also sheet 6
P0_A13: Q40.D R48.1 ; also sheet 6
P0_A14: Q41.D R49.1 ; also sheet 6
P0_A15: Q42.D R50.1 ; also sheet 6
P0_WD0: Q25.D R33.1 ; also sheet 6
P0_WD1: Q26.D R34.1 ; also sheet 6
P0_WD2: Q27.D R35.1 ; also sheet 6
P0_WD3: Q28.D R36.1 ; also sheet 6
P0_WD4: Q29.D R37.1 ; also sheet 6
P0_WD5: Q30.D R38.1 ; also sheet 6
P0_WD6: Q31.D R39.1 ; also sheet 6
P0_WD7: Q32.D R40.1 ; also sheet 6
WD0_N: Q25.G ; also sheet 4,10,13,16
WD1_N: Q26.G ; also sheet 4,10,13,16
WD2_N: Q27.G ; also sheet 4,10,13,16
WD3_N: Q28.G ; also sheet 4,10,13,16
WD4_N: Q29.G ; also sheet 4,10,13,16
WD5_N: Q30.G ; also sheet 4,10,13,16
WD6_N: Q31.G ; also sheet 4,10,13,16
WD7_N: Q32.G ; also sheet 4,10,13,16

## Sheet 8 of 18
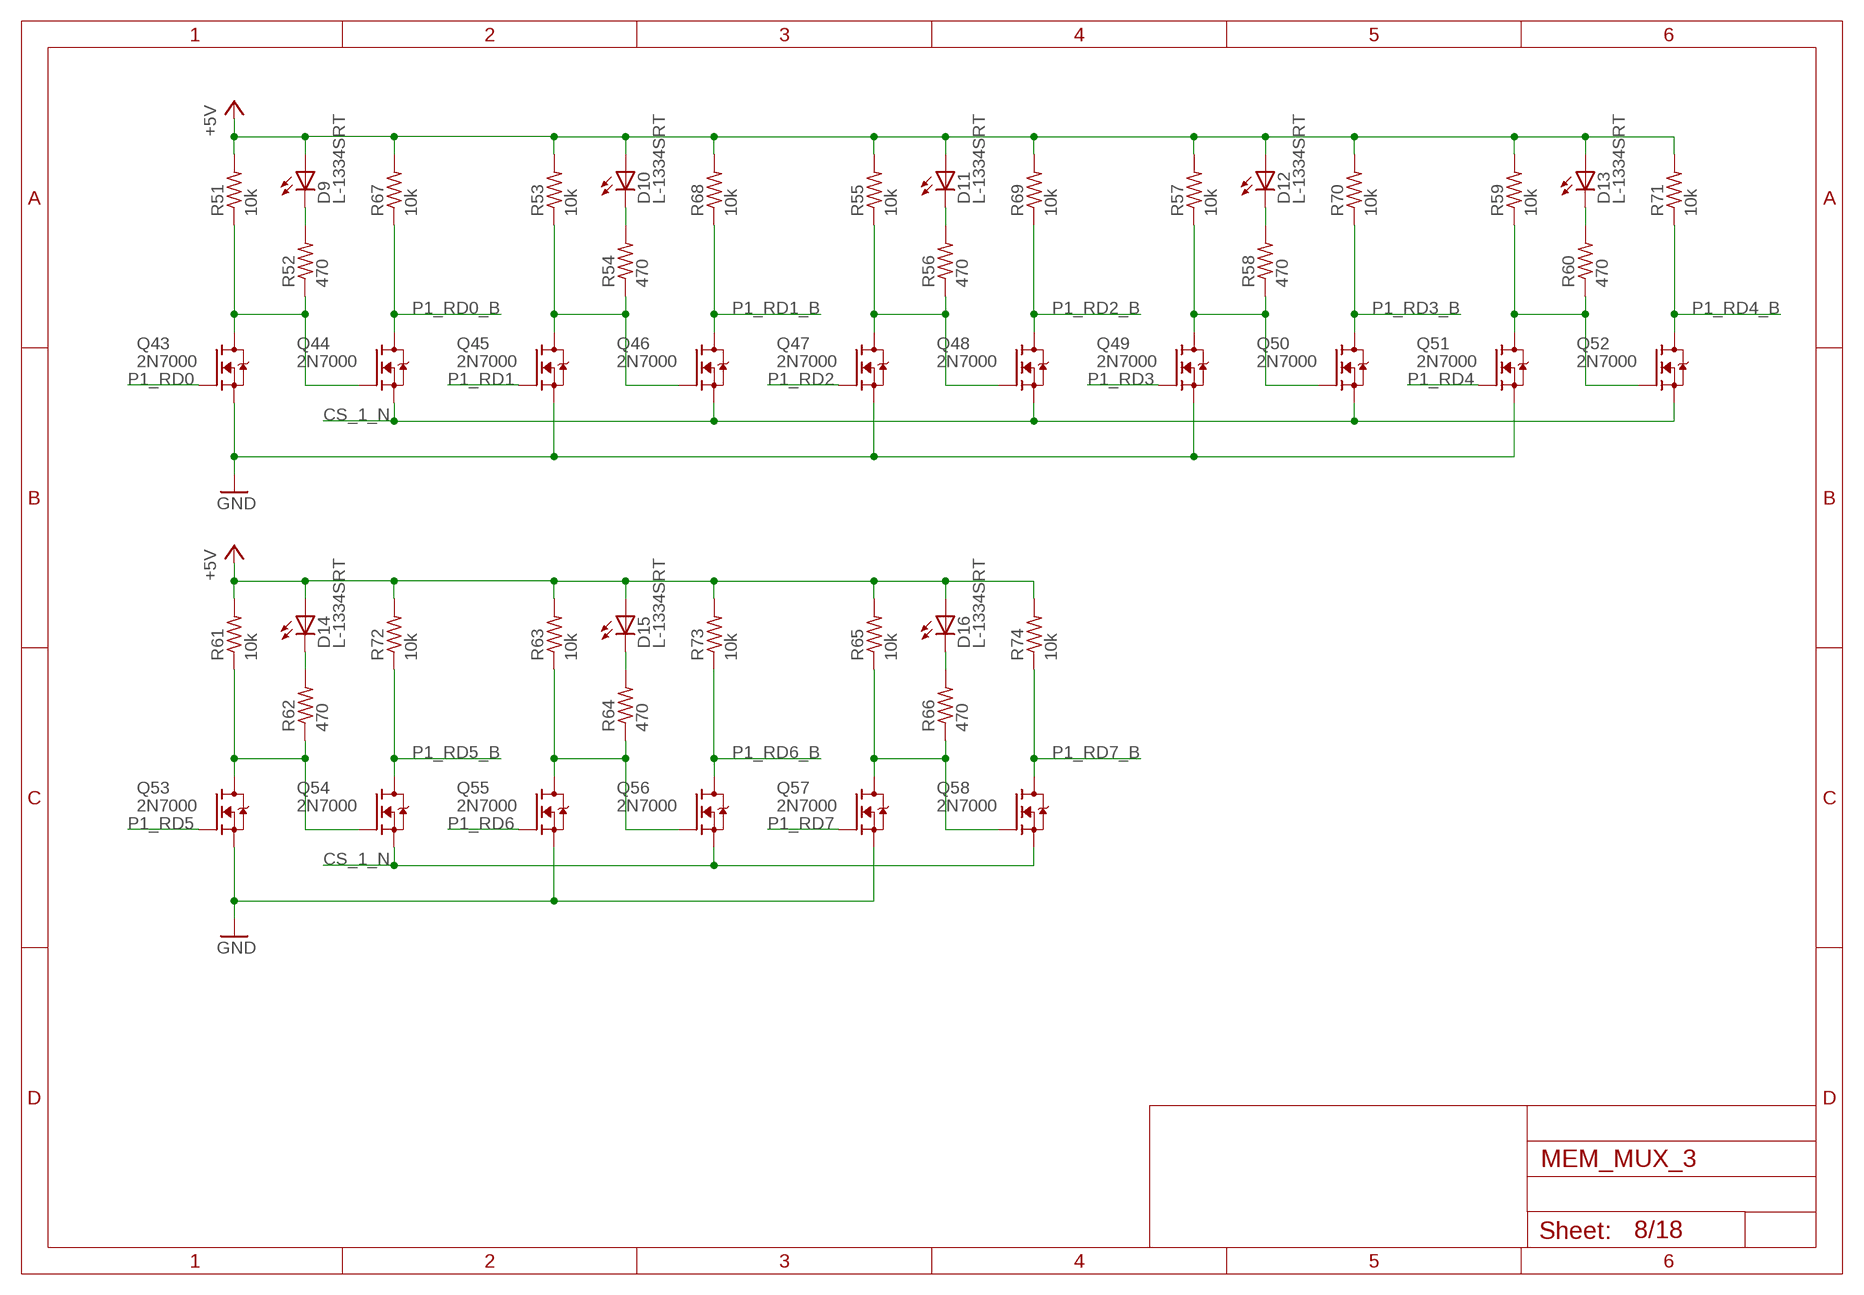
[diagram p7: schematic, sheet 8]

### Parts
D9  L-1334SRT  [LED3MM]
D10  L-1334SRT  [LED3MM]
D11  L-1334SRT  [LED3MM]
D12  L-1334SRT  [LED3MM]
D13  L-1334SRT  [LED3MM]
D14  L-1334SRT  [LED3MM]
D15  L-1334SRT  [LED3MM]
D16  L-1334SRT  [LED3MM]
Q43  2N7000  [TO92-DGS]
Q44  2N7000  [TO92-DGS]
Q45  2N7000  [TO92-DGS]
Q46  2N7000  [TO92-DGS]
Q47  2N7000  [TO92-DGS]
Q48  2N7000  [TO92-DGS]
Q49  2N7000  [TO92-DGS]
Q50  2N7000  [TO92-DGS]
Q51  2N7000  [TO92-DGS]
Q52  2N7000  [TO92-DGS]
Q53  2N7000  [TO92-DGS]
Q54  2N7000  [TO92-DGS]
Q55  2N7000  [TO92-DGS]
Q56  2N7000  [TO92-DGS]
Q57  2N7000  [TO92-DGS]
Q58  2N7000  [TO92-DGS]
R51  10k  R_P2INCH  [R_P2INCH]
R52  470  R_P2INCH  [R_P2INCH]
R53  10k  R_P2INCH  [R_P2INCH]
R54  470  R_P2INCH  [R_P2INCH]
R55  10k  R_P2INCH  [R_P2INCH]
R56  470  R_P2INCH  [R_P2INCH]
R57  10k  R_P2INCH  [R_P2INCH]
R58  470  R_P2INCH  [R_P2INCH]
R59  10k  R_P2INCH  [R_P2INCH]
R60  470  R_P2INCH  [R_P2INCH]
R61  10k  R_P2INCH  [R_P2INCH]
R62  470  R_P2INCH  [R_P2INCH]
R63  10k  R_P2INCH  [R_P2INCH]
R64  470  R_P2INCH  [R_P2INCH]
R65  10k  R_P2INCH  [R_P2INCH]
R66  470  R_P2INCH  [R_P2INCH]
R67  10k  R_P2INCH  [R_P2INCH]
R68  10k  R_P2INCH  [R_P2INCH]
R69  10k  R_P2INCH  [R_P2INCH]
R70  10k  R_P2INCH  [R_P2INCH]
R71  10k  R_P2INCH  [R_P2INCH]
R72  10k  R_P2INCH  [R_P2INCH]
R73  10k  R_P2INCH  [R_P2INCH]
R74  10k  R_P2INCH  [R_P2INCH]

### Nets
+5V: D9.A D10.A D11.A D12.A D13.A D14.A D15.A D16.A R51.2 R53.2 R55.2 R57.2 R59.2 R61.2 R63.2 R65.2 R67.2 R68.2 R69.2 R70.2 R71.2 R72.2 R73.2 R74.2 ; also sheet 2,3,4,5,6,7,9,10,11,12,13,14,15,16,17,18
CS_1_N: Q44.S Q46.S Q48.S Q50.S Q52.S Q54.S Q56.S Q58.S ; also sheet 3
GND: Q43.S Q45.S Q47.S Q49.S Q51.S Q53.S Q55.S Q57.S ; also sheet 2,3,4,5,6,7,9,10,11,12,13,14,15,16,17,18
N$11: Q43.D Q44.G R51.1 R52.1
N$18: D9.K(C) R52.2
N$19: Q45.D Q46.G R53.1 R54.1
N$20: D10.K(C) R54.2
N$21: Q47.D Q48.G R55.1 R56.1
N$22: D11.K(C) R56.2
N$23: Q49.D Q50.G R57.1 R58.1
N$24: D12.K(C) R58.2
N$25: Q51.D Q52.G R59.1 R60.1
N$26: D13.K(C) R60.2
N$27: Q53.D Q54.G R61.1 R62.1
N$28: D14.K(C) R62.2
N$29: Q55.D Q56.G R63.1 R64.1
N$30: D15.K(C) R64.2
N$31: Q57.D Q58.G R65.1 R66.1
N$32: D16.K(C) R66.2
P1_RD0: Q43.G ; also sheet 9
P1_RD0_B: Q44.D R67.1 ; also sheet 17
P1_RD1: Q45.G ; also sheet 9
P1_RD1_B: Q46.D R68.1 ; also sheet 17
P1_RD2: Q47.G ; also sheet 9
P1_RD2_B: Q48.D R69.1 ; also sheet 17
P1_RD3: Q49.G ; also sheet 9
P1_RD3_B: Q50.D R70.1 ; also sheet 17
P1_RD4: Q51.G ; also sheet 9
P1_RD4_B: Q52.D R71.1 ; also sheet 18
P1_RD5: Q53.G ; also sheet 9
P1_RD5_B: Q54.D R72.1 ; also sheet 18
P1_RD6: Q55.G ; also sheet 9
P1_RD6_B: Q56.D R73.1 ; also sheet 18
P1_RD7: Q57.G ; also sheet 9
P1_RD7_B: Q58.D R74.1 ; also sheet 18

## Sheet 9 of 18
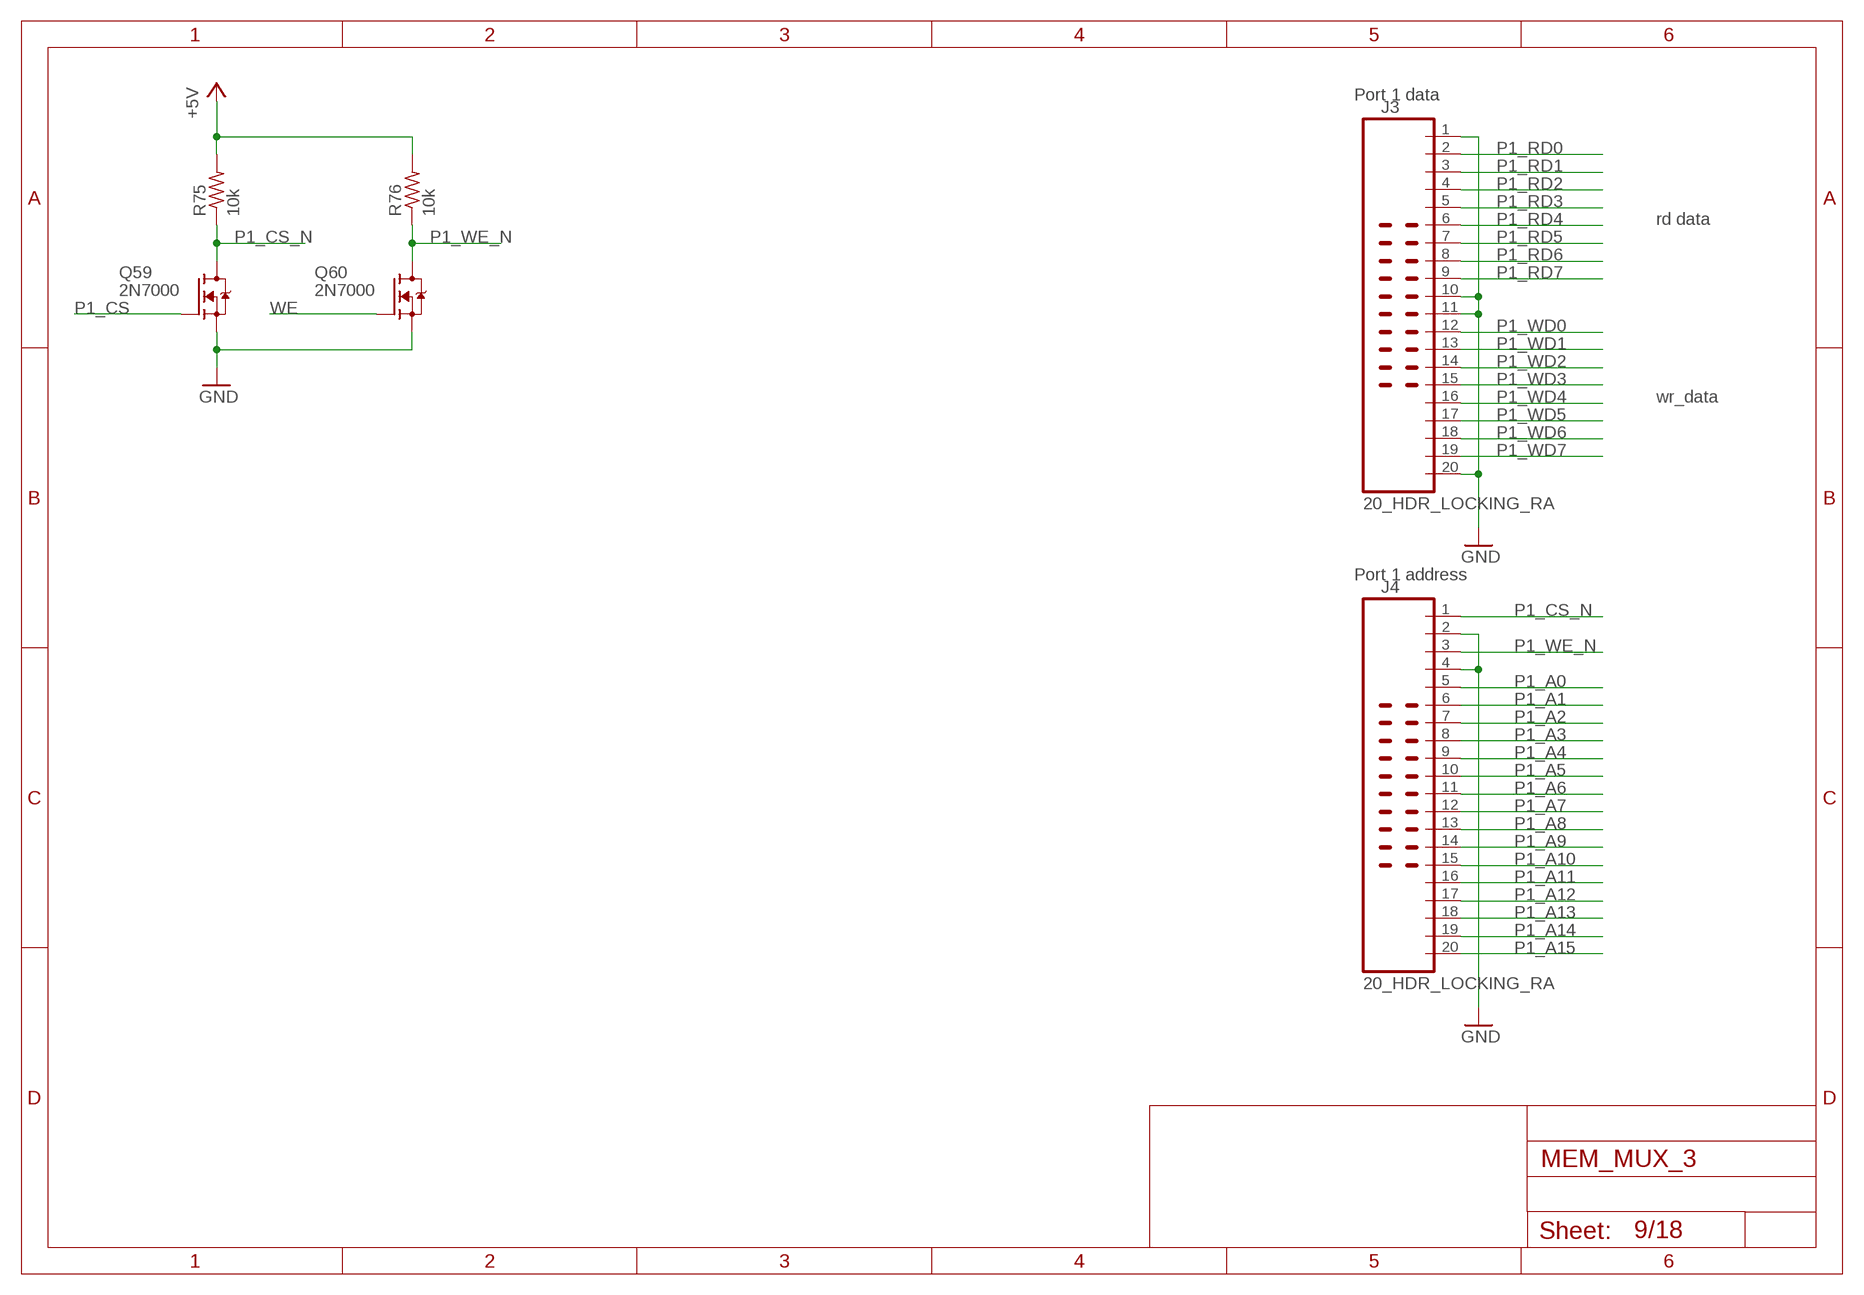
[diagram p8: schematic, sheet 9]

### Parts
J3  20_HDR_LOCKING_RA  [20_HDR_LOCKING_RA]
J4  20_HDR_LOCKING_RA  [20_HDR_LOCKING_RA]
Q59  2N7000  [TO92-DGS]
Q60  2N7000  [TO92-DGS]
R75  10k  R_P2INCH  [R_P2INCH]
R76  10k  R_P2INCH  [R_P2INCH]

### Nets
+5V: R75.2 R76.2 ; also sheet 2,3,4,5,6,7,8,10,11,12,13,14,15,16,17,18
GND: J3.1 J3.10 J3.11 J3.20 J4.2 J4.4 Q59.S Q60.S ; also sheet 2,3,4,5,6,7,8,10,11,12,13,14,15,16,17,18
P1_A0: J4.5 ; also sheet 10
P1_A1: J4.6 ; also sheet 10
P1_A2: J4.7 ; also sheet 10
P1_A3: J4.8 ; also sheet 10
P1_A4: J4.9 ; also sheet 10
P1_A5: J4.10 ; also sheet 10
P1_A6: J4.11 ; also sheet 10
P1_A7: J4.12 ; also sheet 10
P1_A8: J4.13 ; also sheet 10
P1_A9: J4.14 ; also sheet 10
P1_A10: J4.15 ; also sheet 10
P1_A11: J4.16 ; also sheet 10
P1_A12: J4.17 ; also sheet 10
P1_A13: J4.18 ; also sheet 10
P1_A14: J4.19 ; also sheet 10
P1_A15: J4.20 ; also sheet 10
P1_CS: Q59.G ; also sheet 3
P1_CS_N: J4.1 Q59.D R75.1
P1_RD0: J3.2 ; also sheet 8
P1_RD1: J3.3 ; also sheet 8
P1_RD2: J3.4 ; also sheet 8
P1_RD3: J3.5 ; also sheet 8
P1_RD4: J3.6 ; also sheet 8
P1_RD5: J3.7 ; also sheet 8
P1_RD6: J3.8 ; also sheet 8
P1_RD7: J3.9 ; also sheet 8
P1_WD0: J3.12 ; also sheet 10
P1_WD1: J3.13 ; also sheet 10
P1_WD2: J3.14 ; also sheet 10
P1_WD3: J3.15 ; also sheet 10
P1_WD4: J3.16 ; also sheet 10
P1_WD5: J3.17 ; also sheet 10
P1_WD6: J3.18 ; also sheet 10
P1_WD7: J3.19 ; also sheet 10
P1_WE_N: J4.3 Q60.D R76.1
WE: Q60.G ; also sheet 3,6,12,15

### Notes on the sheet
- Port 1 data
- rd data
- wr_data
- Port 1 address

## Sheet 10 of 18
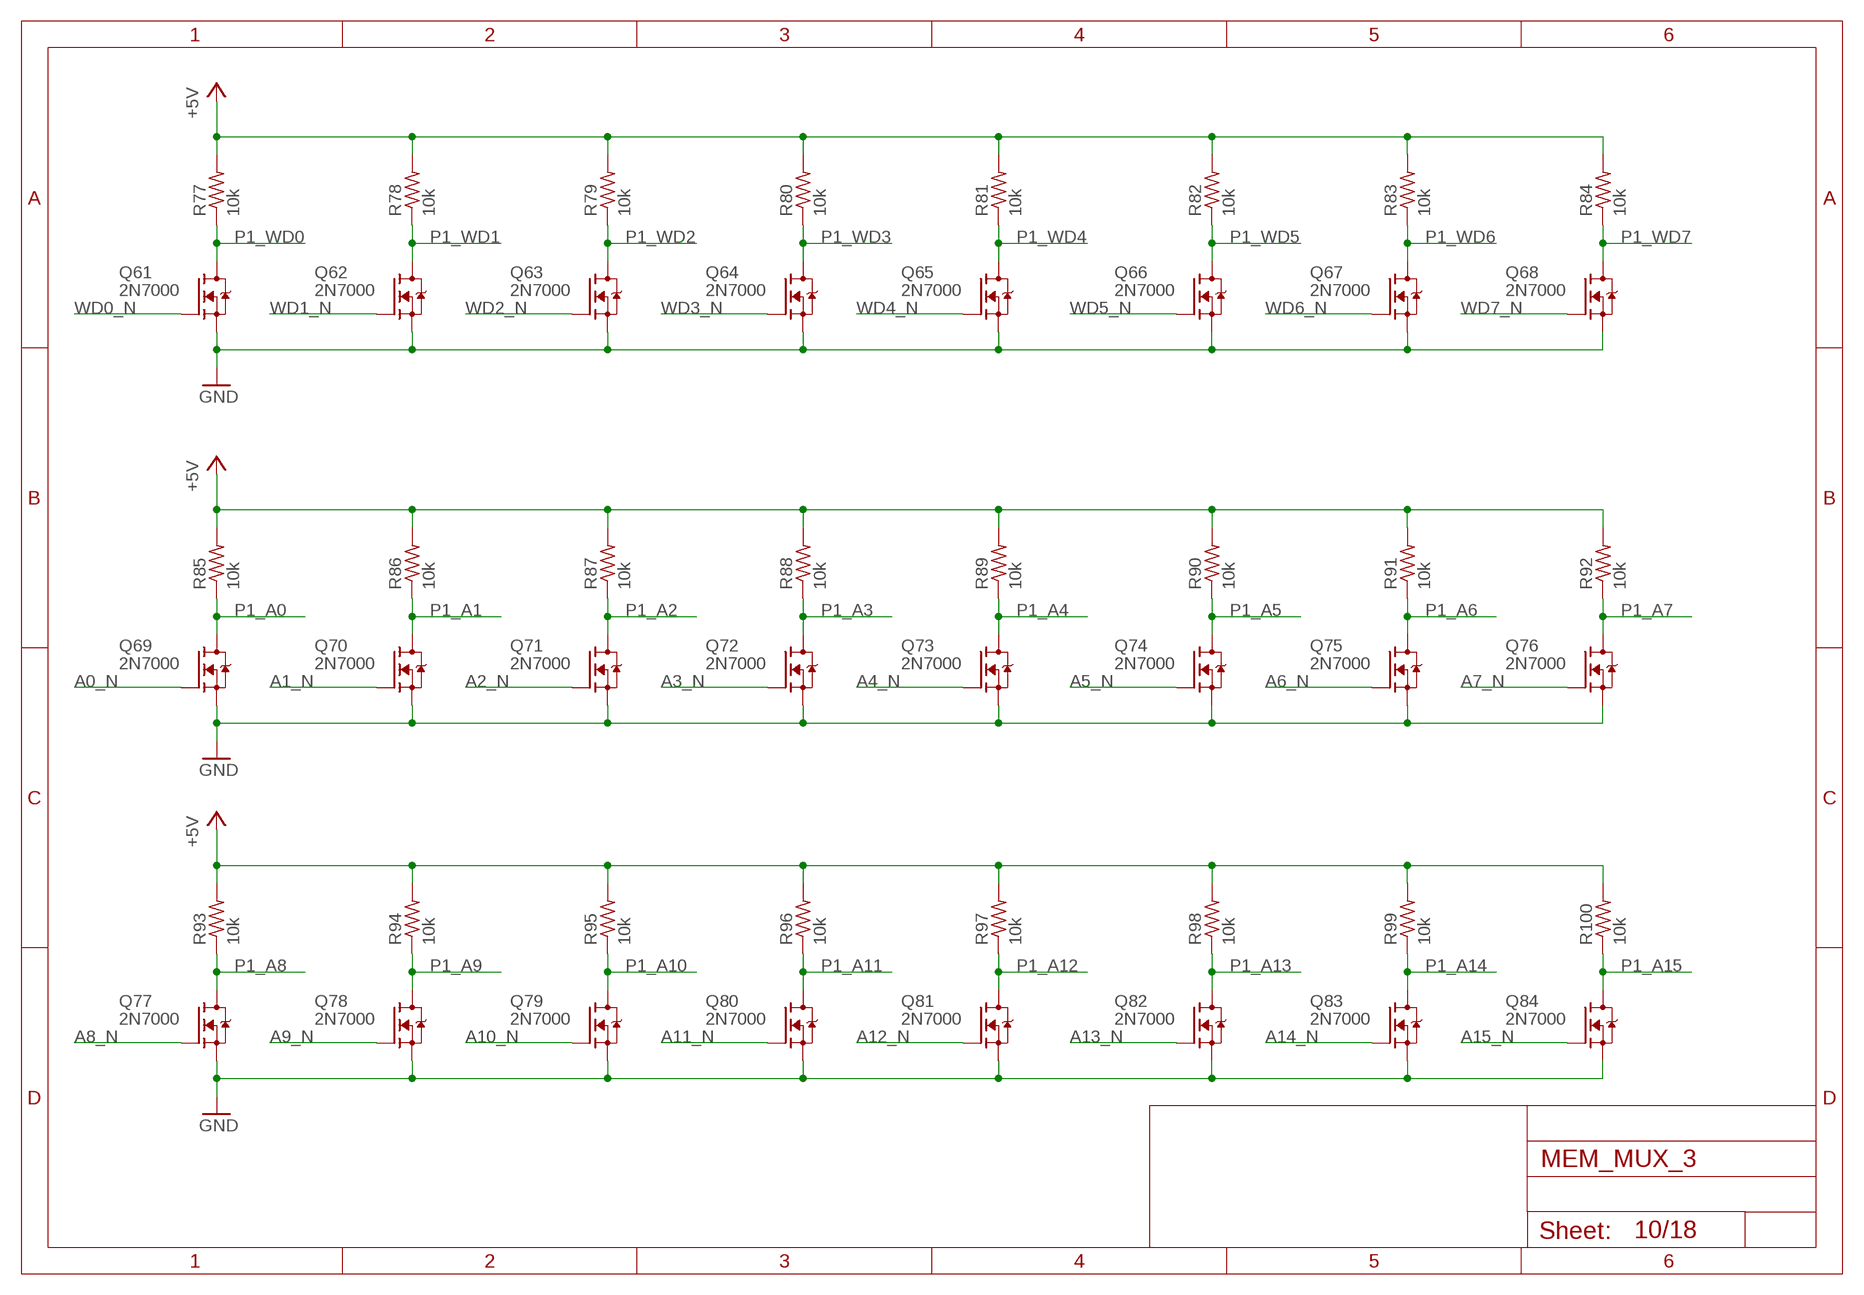
[diagram p9: schematic, sheet 10]

### Parts
Q61  2N7000  [TO92-DGS]
Q62  2N7000  [TO92-DGS]
Q63  2N7000  [TO92-DGS]
Q64  2N7000  [TO92-DGS]
Q65  2N7000  [TO92-DGS]
Q66  2N7000  [TO92-DGS]
Q67  2N7000  [TO92-DGS]
Q68  2N7000  [TO92-DGS]
Q69  2N7000  [TO92-DGS]
Q70  2N7000  [TO92-DGS]
Q71  2N7000  [TO92-DGS]
Q72  2N7000  [TO92-DGS]
Q73  2N7000  [TO92-DGS]
Q74  2N7000  [TO92-DGS]
Q75  2N7000  [TO92-DGS]
Q76  2N7000  [TO92-DGS]
Q77  2N7000  [TO92-DGS]
Q78  2N7000  [TO92-DGS]
Q79  2N7000  [TO92-DGS]
Q80  2N7000  [TO92-DGS]
Q81  2N7000  [TO92-DGS]
Q82  2N7000  [TO92-DGS]
Q83  2N7000  [TO92-DGS]
Q84  2N7000  [TO92-DGS]
R77  10k  R_P2INCH  [R_P2INCH]
R78  10k  R_P2INCH  [R_P2INCH]
R79  10k  R_P2INCH  [R_P2INCH]
R80  10k  R_P2INCH  [R_P2INCH]
R81  10k  R_P2INCH  [R_P2INCH]
R82  10k  R_P2INCH  [R_P2INCH]
R83  10k  R_P2INCH  [R_P2INCH]
R84  10k  R_P2INCH  [R_P2INCH]
R85  10k  R_P2INCH  [R_P2INCH]
R86  10k  R_P2INCH  [R_P2INCH]
R87  10k  R_P2INCH  [R_P2INCH]
R88  10k  R_P2INCH  [R_P2INCH]
R89  10k  R_P2INCH  [R_P2INCH]
R90  10k  R_P2INCH  [R_P2INCH]
R91  10k  R_P2INCH  [R_P2INCH]
R92  10k  R_P2INCH  [R_P2INCH]
R93  10k  R_P2INCH  [R_P2INCH]
R94  10k  R_P2INCH  [R_P2INCH]
R95  10k  R_P2INCH  [R_P2INCH]
R96  10k  R_P2INCH  [R_P2INCH]
R97  10k  R_P2INCH  [R_P2INCH]
R98  10k  R_P2INCH  [R_P2INCH]
R99  10k  R_P2INCH  [R_P2INCH]
R100  10k  R_P2INCH  [R_P2INCH]

### Nets
+5V: R77.2 R78.2 R79.2 R80.2 R81.2 R82.2 R83.2 R84.2 R85.2 R86.2 R87.2 R88.2 R89.2 R90.2 R91.2 R92.2 R93.2 R94.2 R95.2 R96.2 R97.2 R98.2 R99.2 R100.2 ; also sheet 2,3,4,5,6,7,8,9,11,12,13,14,15,16,17,18
A0_N: Q69.G ; also sheet 3,4,7,13,16
A1_N: Q70.G ; also sheet 3,4,7,13,16
A2_N: Q71.G ; also sheet 3,4,7,13,16
A3_N: Q72.G ; also sheet 3,4,7,13,16
A4_N: Q73.G ; also sheet 3,4,7,13,16
A5_N: Q74.G ; also sheet 3,4,7,13,16
A6_N: Q75.G ; also sheet 3,4,7,13,16
A7_N: Q76.G ; also sheet 3,4,7,13,16
A8_N: Q77.G ; also sheet 3,4,7,13,16
A9_N: Q78.G ; also sheet 3,4,7,13,16
A10_N: Q79.G ; also sheet 3,4,7,13,16
A11_N: Q80.G ; also sheet 3,4,7,13,16
A12_N: Q81.G ; also sheet 3,4,7,13,16
A13_N: Q82.G ; also sheet 3,4,7,13,16
A14_N: Q83.G ; also sheet 3,4,7,13,16
A15_N: Q84.G ; also sheet 3,4,7,13,16
GND: Q61.S Q62.S Q63.S Q64.S Q65.S Q66.S Q67.S Q68.S Q69.S Q70.S Q71.S Q72.S Q73.S Q74.S Q75.S Q76.S Q77.S Q78.S Q79.S Q80.S Q81.S Q82.S Q83.S Q84.S ; also sheet 2,3,4,5,6,7,8,9,11,12,13,14,15,16,17,18
P1_A0: Q69.D R85.1 ; also sheet 9
P1_A1: Q70.D R86.1 ; also sheet 9
P1_A2: Q71.D R87.1 ; also sheet 9
P1_A3: Q72.D R88.1 ; also sheet 9
P1_A4: Q73.D R89.1 ; also sheet 9
P1_A5: Q74.D R90.1 ; also sheet 9
P1_A6: Q75.D R91.1 ; also sheet 9
P1_A7: Q76.D R92.1 ; also sheet 9
P1_A8: Q77.D R93.1 ; also sheet 9
P1_A9: Q78.D R94.1 ; also sheet 9
P1_A10: Q79.D R95.1 ; also sheet 9
P1_A11: Q80.D R96.1 ; also sheet 9
P1_A12: Q81.D R97.1 ; also sheet 9
P1_A13: Q82.D R98.1 ; also sheet 9
P1_A14: Q83.D R99.1 ; also sheet 9
P1_A15: Q84.D R100.1 ; also sheet 9
P1_WD0: Q61.D R77.1 ; also sheet 9
P1_WD1: Q62.D R78.1 ; also sheet 9
P1_WD2: Q63.D R79.1 ; also sheet 9
P1_WD3: Q64.D R80.1 ; also sheet 9
P1_WD4: Q65.D R81.1 ; also sheet 9
P1_WD5: Q66.D R82.1 ; also sheet 9
P1_WD6: Q67.D R83.1 ; also sheet 9
P1_WD7: Q68.D R84.1 ; also sheet 9
WD0_N: Q61.G ; also sheet 4,7,13,16
WD1_N: Q62.G ; also sheet 4,7,13,16
WD2_N: Q63.G ; also sheet 4,7,13,16
WD3_N: Q64.G ; also sheet 4,7,13,16
WD4_N: Q65.G ; also sheet 4,7,13,16
WD5_N: Q66.G ; also sheet 4,7,13,16
WD6_N: Q67.G ; also sheet 4,7,13,16
WD7_N: Q68.G ; also sheet 4,7,13,16

## Sheet 11 of 18
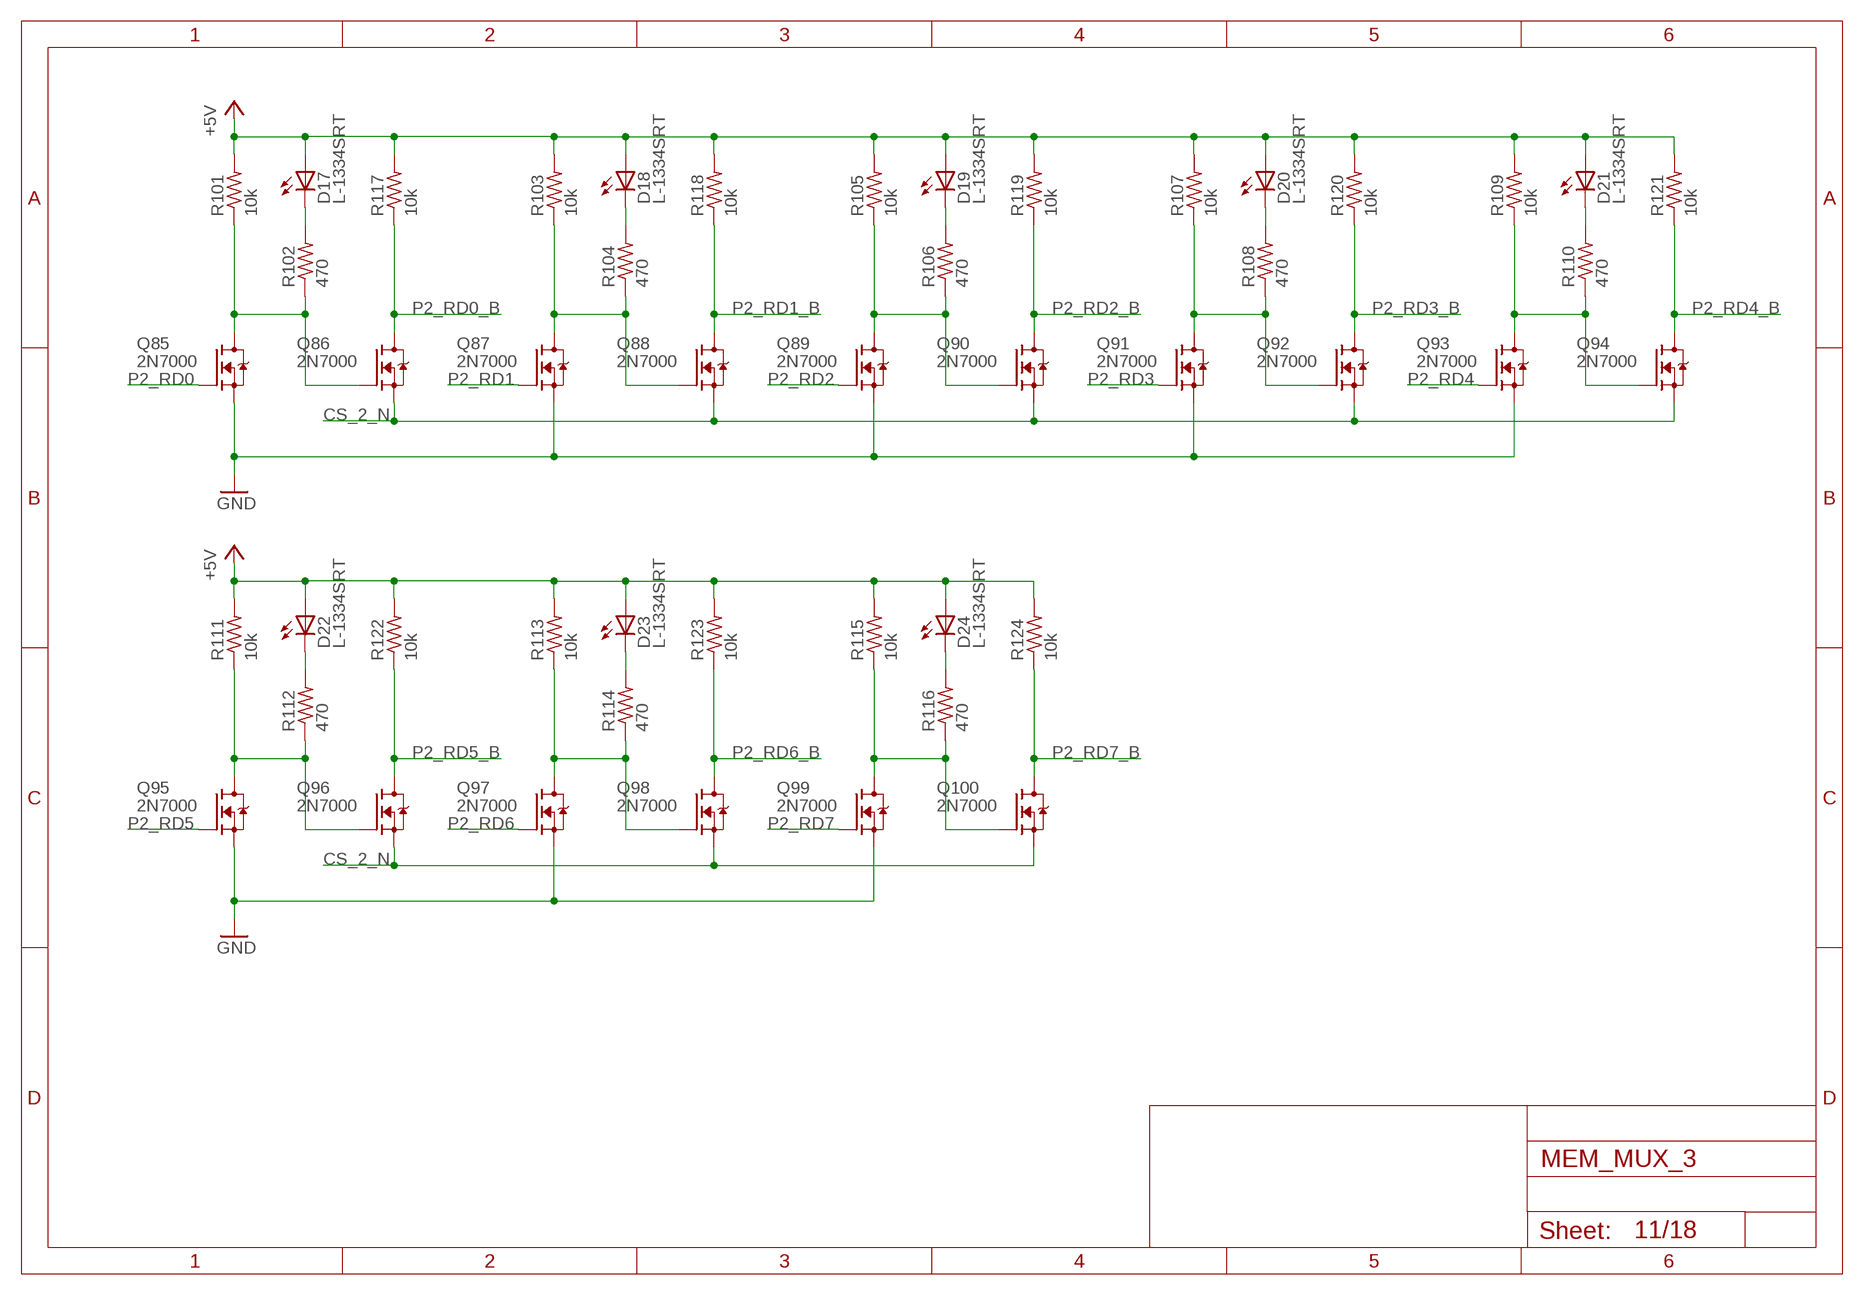
[diagram p10: schematic, sheet 11]

### Parts
D17  L-1334SRT  [LED3MM]
D18  L-1334SRT  [LED3MM]
D19  L-1334SRT  [LED3MM]
D20  L-1334SRT  [LED3MM]
D21  L-1334SRT  [LED3MM]
D22  L-1334SRT  [LED3MM]
D23  L-1334SRT  [LED3MM]
D24  L-1334SRT  [LED3MM]
Q85  2N7000  [TO92-DGS]
Q86  2N7000  [TO92-DGS]
Q87  2N7000  [TO92-DGS]
Q88  2N7000  [TO92-DGS]
Q89  2N7000  [TO92-DGS]
Q90  2N7000  [TO92-DGS]
Q91  2N7000  [TO92-DGS]
Q92  2N7000  [TO92-DGS]
Q93  2N7000  [TO92-DGS]
Q94  2N7000  [TO92-DGS]
Q95  2N7000  [TO92-DGS]
Q96  2N7000  [TO92-DGS]
Q97  2N7000  [TO92-DGS]
Q98  2N7000  [TO92-DGS]
Q99  2N7000  [TO92-DGS]
Q100  2N7000  [TO92-DGS]
R101  10k  R_P2INCH  [R_P2INCH]
R102  470  R_P2INCH  [R_P2INCH]
R103  10k  R_P2INCH  [R_P2INCH]
R104  470  R_P2INCH  [R_P2INCH]
R105  10k  R_P2INCH  [R_P2INCH]
R106  470  R_P2INCH  [R_P2INCH]
R107  10k  R_P2INCH  [R_P2INCH]
R108  470  R_P2INCH  [R_P2INCH]
R109  10k  R_P2INCH  [R_P2INCH]
R110  470  R_P2INCH  [R_P2INCH]
R111  10k  R_P2INCH  [R_P2INCH]
R112  470  R_P2INCH  [R_P2INCH]
R113  10k  R_P2INCH  [R_P2INCH]
R114  470  R_P2INCH  [R_P2INCH]
R115  10k  R_P2INCH  [R_P2INCH]
R116  470  R_P2INCH  [R_P2INCH]
R117  10k  R_P2INCH  [R_P2INCH]
R118  10k  R_P2INCH  [R_P2INCH]
R119  10k  R_P2INCH  [R_P2INCH]
R120  10k  R_P2INCH  [R_P2INCH]
R121  10k  R_P2INCH  [R_P2INCH]
R122  10k  R_P2INCH  [R_P2INCH]
R123  10k  R_P2INCH  [R_P2INCH]
R124  10k  R_P2INCH  [R_P2INCH]

### Nets
+5V: D17.A D18.A D19.A D20.A D21.A D22.A D23.A D24.A R101.2 R103.2 R105.2 R107.2 R109.2 R111.2 R113.2 R115.2 R117.2 R118.2 R119.2 R120.2 R121.2 R122.2 R123.2 R124.2 ; also sheet 2,3,4,5,6,7,8,9,10,12,13,14,15,16,17,18
CS_2_N: Q86.S Q88.S Q90.S Q92.S Q94.S Q96.S Q98.S Q100.S ; also sheet 3
GND: Q85.S Q87.S Q89.S Q91.S Q93.S Q95.S Q97.S Q99.S ; also sheet 2,3,4,5,6,7,8,9,10,12,13,14,15,16,17,18
N$33: Q85.D Q86.G R101.1 R102.1
N$34: D17.K(C) R102.2
N$35: Q87.D Q88.G R103.1 R104.1
N$36: D18.K(C) R104.2
N$37: Q89.D Q90.G R105.1 R106.1
N$38: D19.K(C) R106.2
N$39: Q91.D Q92.G R107.1 R108.1
N$40: D20.K(C) R108.2
N$41: Q93.D Q94.G R109.1 R110.1
N$42: D21.K(C) R110.2
N$43: Q95.D Q96.G R111.1 R112.1
N$44: D22.K(C) R112.2
N$45: Q97.D Q98.G R113.1 R114.1
N$46: D23.K(C) R114.2
N$47: Q99.D Q100.G R115.1 R116.1
N$48: D24.K(C) R116.2
P2_RD0: Q85.G ; also sheet 12
P2_RD0_B: Q86.D R117.1 ; also sheet 17
P2_RD1: Q87.G ; also sheet 12
P2_RD1_B: Q88.D R118.1 ; also sheet 17
P2_RD2: Q89.G ; also sheet 12
P2_RD2_B: Q90.D R119.1 ; also sheet 17
P2_RD3: Q91.G ; also sheet 12
P2_RD3_B: Q92.D R120.1 ; also sheet 17
P2_RD4: Q93.G ; also sheet 12
P2_RD4_B: Q94.D R121.1 ; also sheet 18
P2_RD5: Q95.G ; also sheet 12
P2_RD5_B: Q96.D R122.1 ; also sheet 18
P2_RD6: Q97.G ; also sheet 12
P2_RD6_B: Q98.D R123.1 ; also sheet 18
P2_RD7: Q99.G ; also sheet 12
P2_RD7_B: Q100.D R124.1 ; also sheet 18

## Sheet 12 of 18
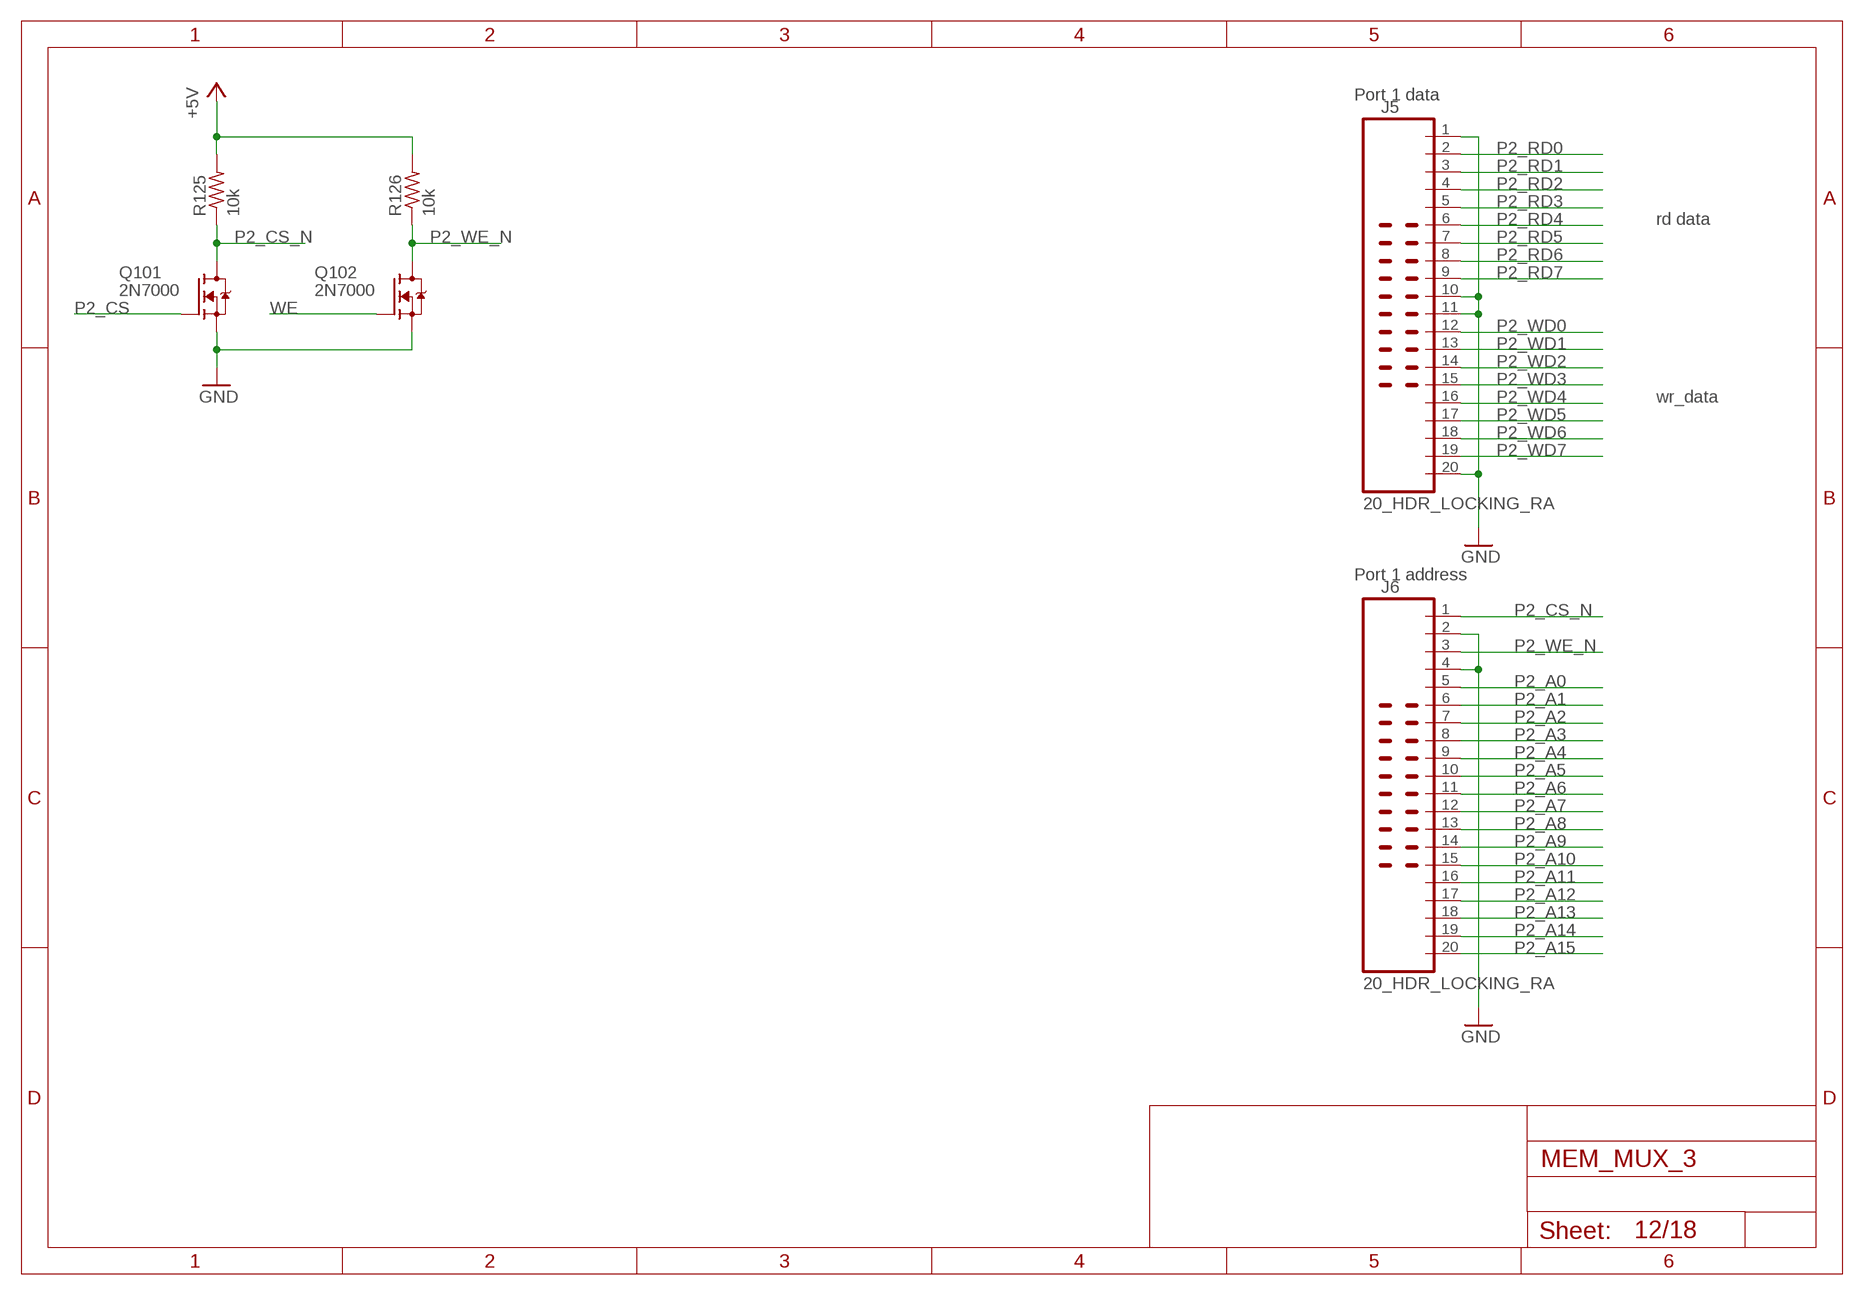
[diagram p11: schematic, sheet 12]

### Parts
J5  20_HDR_LOCKING_RA  [20_HDR_LOCKING_RA]
J6  20_HDR_LOCKING_RA  [20_HDR_LOCKING_RA]
Q101  2N7000  [TO92-DGS]
Q102  2N7000  [TO92-DGS]
R125  10k  R_P2INCH  [R_P2INCH]
R126  10k  R_P2INCH  [R_P2INCH]

### Nets
+5V: R125.2 R126.2 ; also sheet 2,3,4,5,6,7,8,9,10,11,13,14,15,16,17,18
GND: J5.1 J5.10 J5.11 J5.20 J6.2 J6.4 Q101.S Q102.S ; also sheet 2,3,4,5,6,7,8,9,10,11,13,14,15,16,17,18
P2_A0: J6.5 ; also sheet 13
P2_A1: J6.6 ; also sheet 13
P2_A2: J6.7 ; also sheet 13
P2_A3: J6.8 ; also sheet 13
P2_A4: J6.9 ; also sheet 13
P2_A5: J6.10 ; also sheet 13
P2_A6: J6.11 ; also sheet 13
P2_A7: J6.12 ; also sheet 13
P2_A8: J6.13 ; also sheet 13
P2_A9: J6.14 ; also sheet 13
P2_A10: J6.15 ; also sheet 13
P2_A11: J6.16 ; also sheet 13
P2_A12: J6.17 ; also sheet 13
P2_A13: J6.18 ; also sheet 13
P2_A14: J6.19 ; also sheet 13
P2_A15: J6.20 ; also sheet 13
P2_CS: Q101.G ; also sheet 3
P2_CS_N: J6.1 Q101.D R125.1
P2_RD0: J5.2 ; also sheet 11
P2_RD1: J5.3 ; also sheet 11
P2_RD2: J5.4 ; also sheet 11
P2_RD3: J5.5 ; also sheet 11
P2_RD4: J5.6 ; also sheet 11
P2_RD5: J5.7 ; also sheet 11
P2_RD6: J5.8 ; also sheet 11
P2_RD7: J5.9 ; also sheet 11
P2_WD0: J5.12 ; also sheet 13
P2_WD1: J5.13 ; also sheet 13
P2_WD2: J5.14 ; also sheet 13
P2_WD3: J5.15 ; also sheet 13
P2_WD4: J5.16 ; also sheet 13
P2_WD5: J5.17 ; also sheet 13
P2_WD6: J5.18 ; also sheet 13
P2_WD7: J5.19 ; also sheet 13
P2_WE_N: J6.3 Q102.D R126.1
WE: Q102.G ; also sheet 3,6,9,15

### Notes on the sheet
- Port 1 data
- rd data
- wr_data
- Port 1 address

## Sheet 13 of 18
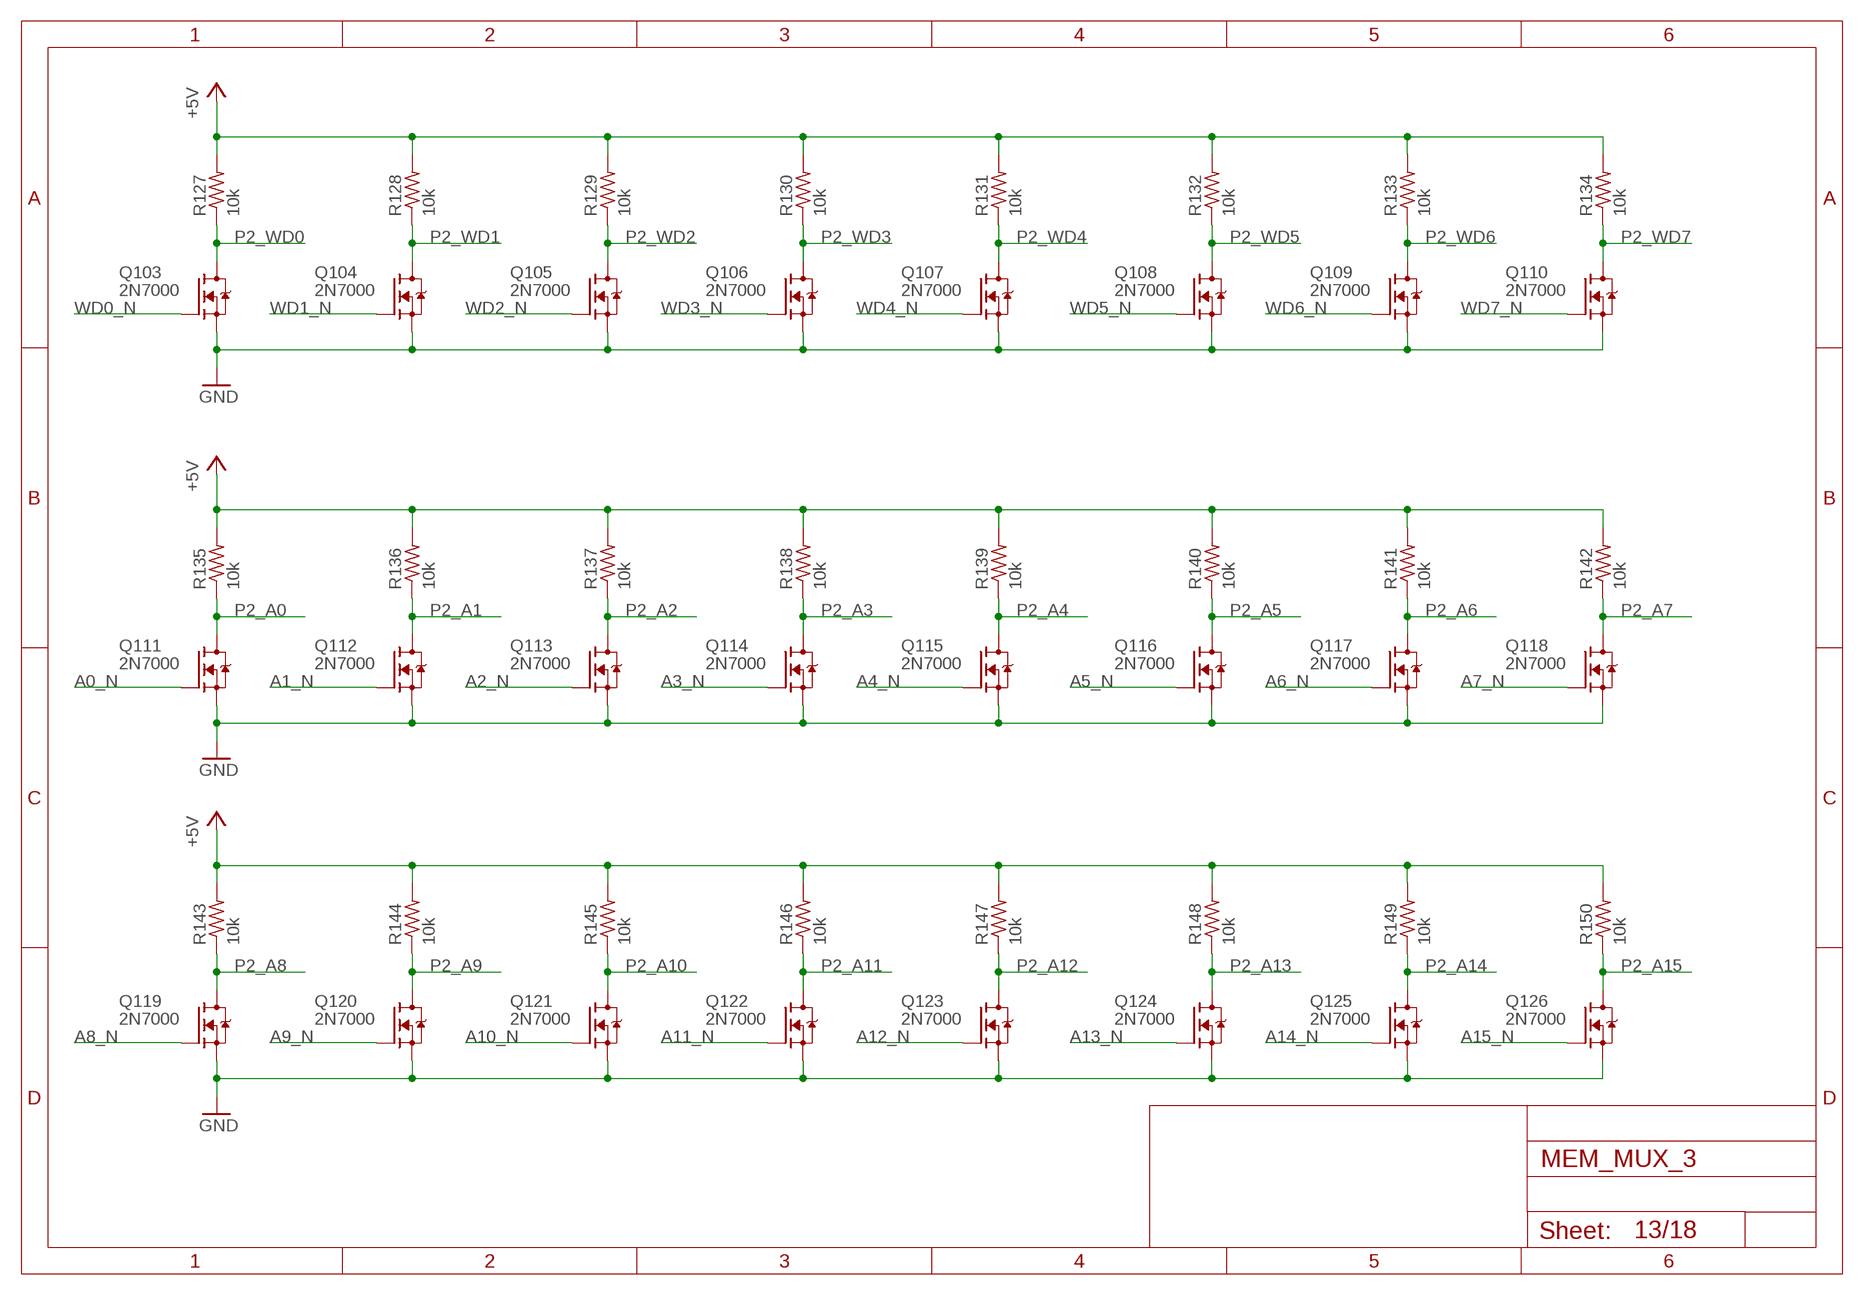
[diagram p12: schematic, sheet 13]

### Parts
Q103  2N7000  [TO92-DGS]
Q104  2N7000  [TO92-DGS]
Q105  2N7000  [TO92-DGS]
Q106  2N7000  [TO92-DGS]
Q107  2N7000  [TO92-DGS]
Q108  2N7000  [TO92-DGS]
Q109  2N7000  [TO92-DGS]
Q110  2N7000  [TO92-DGS]
Q111  2N7000  [TO92-DGS]
Q112  2N7000  [TO92-DGS]
Q113  2N7000  [TO92-DGS]
Q114  2N7000  [TO92-DGS]
Q115  2N7000  [TO92-DGS]
Q116  2N7000  [TO92-DGS]
Q117  2N7000  [TO92-DGS]
Q118  2N7000  [TO92-DGS]
Q119  2N7000  [TO92-DGS]
Q120  2N7000  [TO92-DGS]
Q121  2N7000  [TO92-DGS]
Q122  2N7000  [TO92-DGS]
Q123  2N7000  [TO92-DGS]
Q124  2N7000  [TO92-DGS]
Q125  2N7000  [TO92-DGS]
Q126  2N7000  [TO92-DGS]
R127  10k  R_P2INCH  [R_P2INCH]
R128  10k  R_P2INCH  [R_P2INCH]
R129  10k  R_P2INCH  [R_P2INCH]
R130  10k  R_P2INCH  [R_P2INCH]
R131  10k  R_P2INCH  [R_P2INCH]
R132  10k  R_P2INCH  [R_P2INCH]
R133  10k  R_P2INCH  [R_P2INCH]
R134  10k  R_P2INCH  [R_P2INCH]
R135  10k  R_P2INCH  [R_P2INCH]
R136  10k  R_P2INCH  [R_P2INCH]
R137  10k  R_P2INCH  [R_P2INCH]
R138  10k  R_P2INCH  [R_P2INCH]
R139  10k  R_P2INCH  [R_P2INCH]
R140  10k  R_P2INCH  [R_P2INCH]
R141  10k  R_P2INCH  [R_P2INCH]
R142  10k  R_P2INCH  [R_P2INCH]
R143  10k  R_P2INCH  [R_P2INCH]
R144  10k  R_P2INCH  [R_P2INCH]
R145  10k  R_P2INCH  [R_P2INCH]
R146  10k  R_P2INCH  [R_P2INCH]
R147  10k  R_P2INCH  [R_P2INCH]
R148  10k  R_P2INCH  [R_P2INCH]
R149  10k  R_P2INCH  [R_P2INCH]
R150  10k  R_P2INCH  [R_P2INCH]

### Nets
+5V: R127.2 R128.2 R129.2 R130.2 R131.2 R132.2 R133.2 R134.2 R135.2 R136.2 R137.2 R138.2 R139.2 R140.2 R141.2 R142.2 R143.2 R144.2 R145.2 R146.2 R147.2 R148.2 R149.2 R150.2 ; also sheet 2,3,4,5,6,7,8,9,10,11,12,14,15,16,17,18
A0_N: Q111.G ; also sheet 3,4,7,10,16
A1_N: Q112.G ; also sheet 3,4,7,10,16
A2_N: Q113.G ; also sheet 3,4,7,10,16
A3_N: Q114.G ; also sheet 3,4,7,10,16
A4_N: Q115.G ; also sheet 3,4,7,10,16
A5_N: Q116.G ; also sheet 3,4,7,10,16
A6_N: Q117.G ; also sheet 3,4,7,10,16
A7_N: Q118.G ; also sheet 3,4,7,10,16
A8_N: Q119.G ; also sheet 3,4,7,10,16
A9_N: Q120.G ; also sheet 3,4,7,10,16
A10_N: Q121.G ; also sheet 3,4,7,10,16
A11_N: Q122.G ; also sheet 3,4,7,10,16
A12_N: Q123.G ; also sheet 3,4,7,10,16
A13_N: Q124.G ; also sheet 3,4,7,10,16
A14_N: Q125.G ; also sheet 3,4,7,10,16
A15_N: Q126.G ; also sheet 3,4,7,10,16
GND: Q103.S Q104.S Q105.S Q106.S Q107.S Q108.S Q109.S Q110.S Q111.S Q112.S Q113.S Q114.S Q115.S Q116.S Q117.S Q118.S Q119.S Q120.S Q121.S Q122.S Q123.S Q124.S Q125.S Q126.S ; also sheet 2,3,4,5,6,7,8,9,10,11,12,14,15,16,17,18
P2_A0: Q111.D R135.1 ; also sheet 12
P2_A1: Q112.D R136.1 ; also sheet 12
P2_A2: Q113.D R137.1 ; also sheet 12
P2_A3: Q114.D R138.1 ; also sheet 12
P2_A4: Q115.D R139.1 ; also sheet 12
P2_A5: Q116.D R140.1 ; also sheet 12
P2_A6: Q117.D R141.1 ; also sheet 12
P2_A7: Q118.D R142.1 ; also sheet 12
P2_A8: Q119.D R143.1 ; also sheet 12
P2_A9: Q120.D R144.1 ; also sheet 12
P2_A10: Q121.D R145.1 ; also sheet 12
P2_A11: Q122.D R146.1 ; also sheet 12
P2_A12: Q123.D R147.1 ; also sheet 12
P2_A13: Q124.D R148.1 ; also sheet 12
P2_A14: Q125.D R149.1 ; also sheet 12
P2_A15: Q126.D R150.1 ; also sheet 12
P2_WD0: Q103.D R127.1 ; also sheet 12
P2_WD1: Q104.D R128.1 ; also sheet 12
P2_WD2: Q105.D R129.1 ; also sheet 12
P2_WD3: Q106.D R130.1 ; also sheet 12
P2_WD4: Q107.D R131.1 ; also sheet 12
P2_WD5: Q108.D R132.1 ; also sheet 12
P2_WD6: Q109.D R133.1 ; also sheet 12
P2_WD7: Q110.D R134.1 ; also sheet 12
WD0_N: Q103.G ; also sheet 4,7,10,16
WD1_N: Q104.G ; also sheet 4,7,10,16
WD2_N: Q105.G ; also sheet 4,7,10,16
WD3_N: Q106.G ; also sheet 4,7,10,16
WD4_N: Q107.G ; also sheet 4,7,10,16
WD5_N: Q108.G ; also sheet 4,7,10,16
WD6_N: Q109.G ; also sheet 4,7,10,16
WD7_N: Q110.G ; also sheet 4,7,10,16

## Sheet 14 of 18
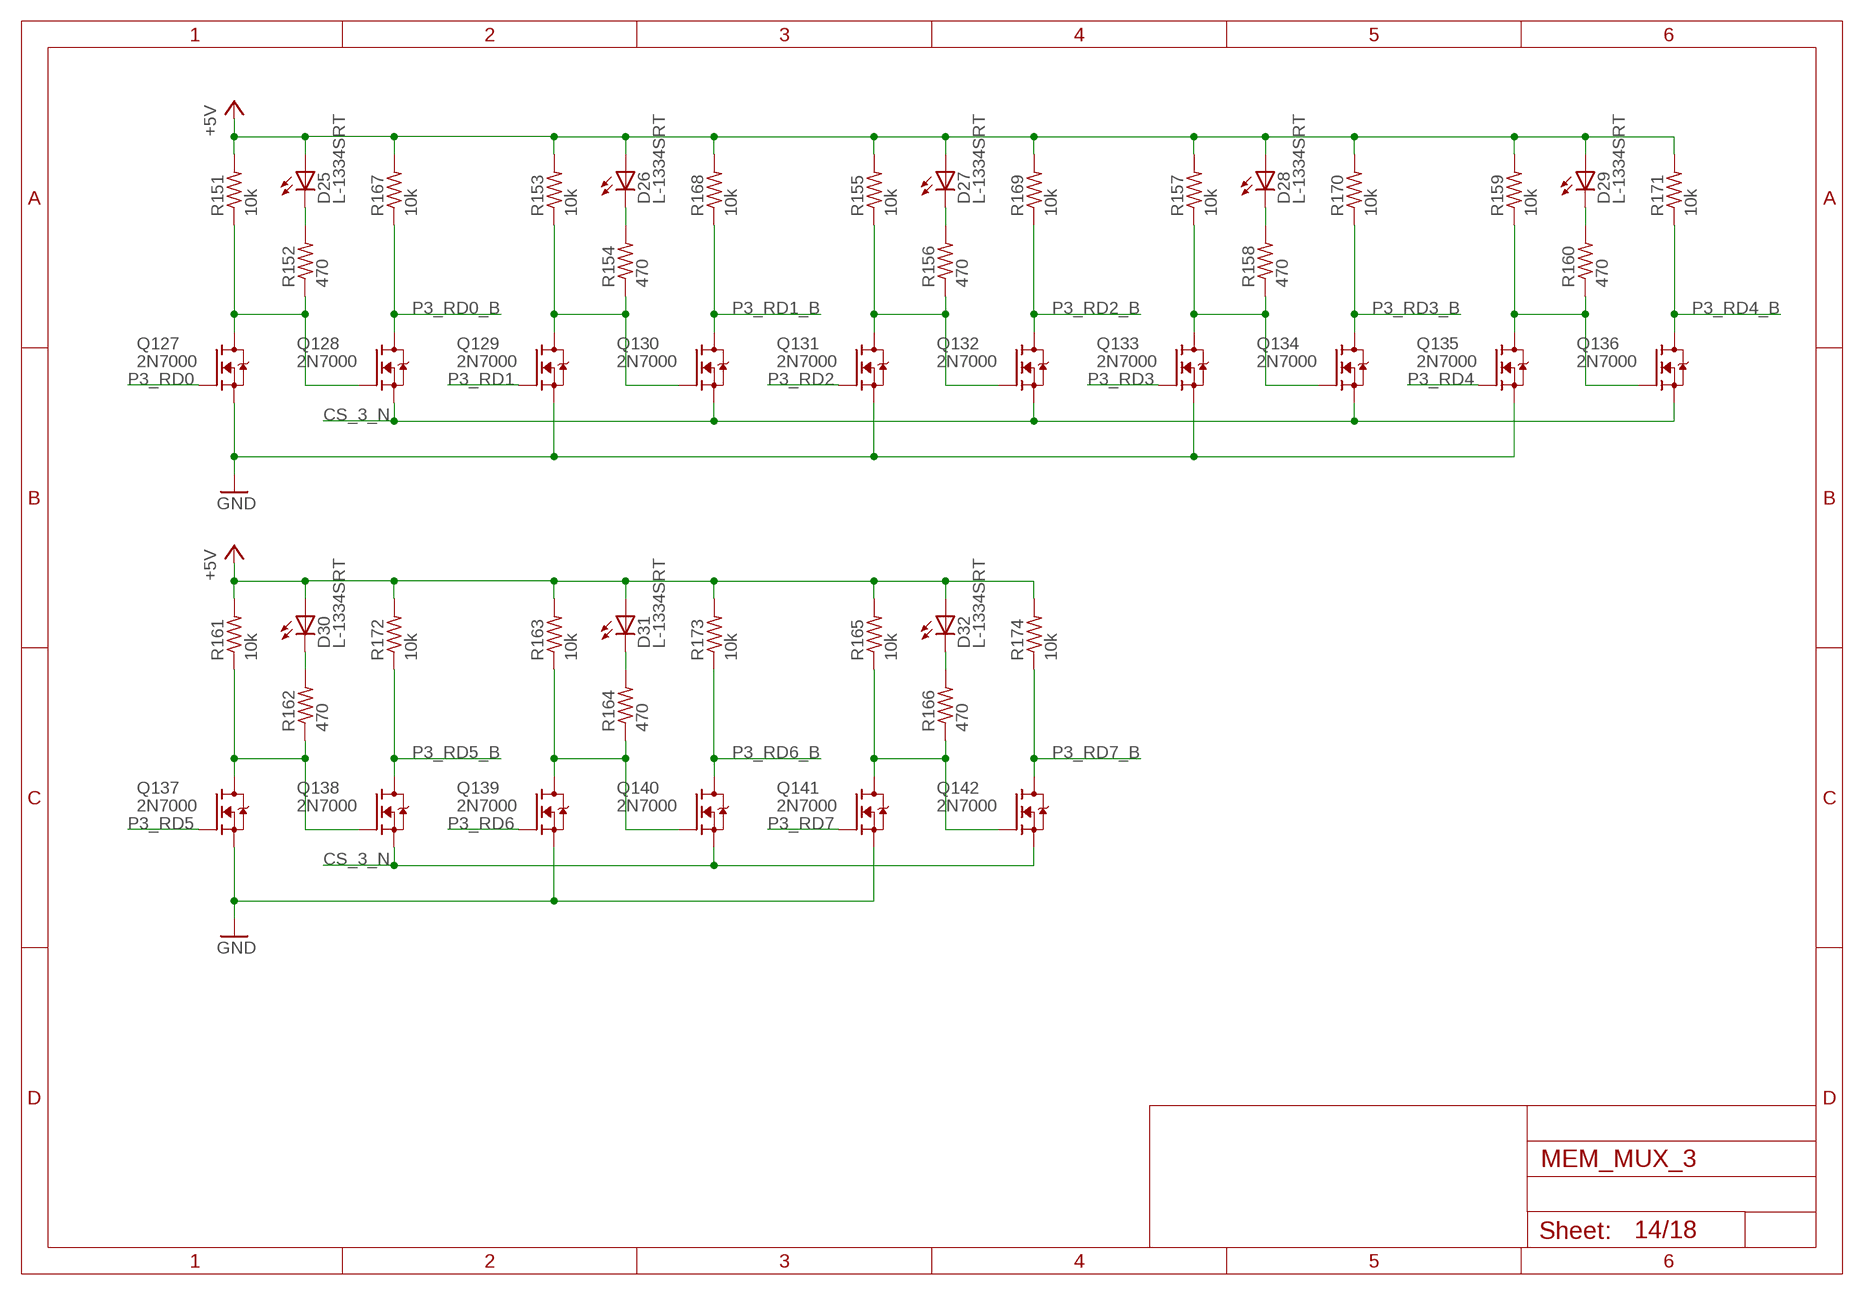
[diagram p13: schematic, sheet 14]

### Parts
D25  L-1334SRT  [LED3MM]
D26  L-1334SRT  [LED3MM]
D27  L-1334SRT  [LED3MM]
D28  L-1334SRT  [LED3MM]
D29  L-1334SRT  [LED3MM]
D30  L-1334SRT  [LED3MM]
D31  L-1334SRT  [LED3MM]
D32  L-1334SRT  [LED3MM]
Q127  2N7000  [TO92-DGS]
Q128  2N7000  [TO92-DGS]
Q129  2N7000  [TO92-DGS]
Q130  2N7000  [TO92-DGS]
Q131  2N7000  [TO92-DGS]
Q132  2N7000  [TO92-DGS]
Q133  2N7000  [TO92-DGS]
Q134  2N7000  [TO92-DGS]
Q135  2N7000  [TO92-DGS]
Q136  2N7000  [TO92-DGS]
Q137  2N7000  [TO92-DGS]
Q138  2N7000  [TO92-DGS]
Q139  2N7000  [TO92-DGS]
Q140  2N7000  [TO92-DGS]
Q141  2N7000  [TO92-DGS]
Q142  2N7000  [TO92-DGS]
R151  10k  R_P2INCH  [R_P2INCH]
R152  470  R_P2INCH  [R_P2INCH]
R153  10k  R_P2INCH  [R_P2INCH]
R154  470  R_P2INCH  [R_P2INCH]
R155  10k  R_P2INCH  [R_P2INCH]
R156  470  R_P2INCH  [R_P2INCH]
R157  10k  R_P2INCH  [R_P2INCH]
R158  470  R_P2INCH  [R_P2INCH]
R159  10k  R_P2INCH  [R_P2INCH]
R160  470  R_P2INCH  [R_P2INCH]
R161  10k  R_P2INCH  [R_P2INCH]
R162  470  R_P2INCH  [R_P2INCH]
R163  10k  R_P2INCH  [R_P2INCH]
R164  470  R_P2INCH  [R_P2INCH]
R165  10k  R_P2INCH  [R_P2INCH]
R166  470  R_P2INCH  [R_P2INCH]
R167  10k  R_P2INCH  [R_P2INCH]
R168  10k  R_P2INCH  [R_P2INCH]
R169  10k  R_P2INCH  [R_P2INCH]
R170  10k  R_P2INCH  [R_P2INCH]
R171  10k  R_P2INCH  [R_P2INCH]
R172  10k  R_P2INCH  [R_P2INCH]
R173  10k  R_P2INCH  [R_P2INCH]
R174  10k  R_P2INCH  [R_P2INCH]

### Nets
+5V: D25.A D26.A D27.A D28.A D29.A D30.A D31.A D32.A R151.2 R153.2 R155.2 R157.2 R159.2 R161.2 R163.2 R165.2 R167.2 R168.2 R169.2 R170.2 R171.2 R172.2 R173.2 R174.2 ; also sheet 2,3,4,5,6,7,8,9,10,11,12,13,15,16,17,18
CS_3_N: Q128.S Q130.S Q132.S Q134.S Q136.S Q138.S Q140.S Q142.S ; also sheet 3
GND: Q127.S Q129.S Q131.S Q133.S Q135.S Q137.S Q139.S Q141.S ; also sheet 2,3,4,5,6,7,8,9,10,11,12,13,15,16,17,18
N$49: Q127.D Q128.G R151.1 R152.1
N$50: D25.K(C) R152.2
N$51: Q129.D Q130.G R153.1 R154.1
N$52: D26.K(C) R154.2
N$53: Q131.D Q132.G R155.1 R156.1
N$54: D27.K(C) R156.2
N$55: Q133.D Q134.G R157.1 R158.1
N$56: D28.K(C) R158.2
N$57: Q135.D Q136.G R159.1 R160.1
N$58: D29.K(C) R160.2
N$59: Q137.D Q138.G R161.1 R162.1
N$60: D30.K(C) R162.2
N$61: Q139.D Q140.G R163.1 R164.1
N$62: D31.K(C) R164.2
N$63: Q141.D Q142.G R165.1 R166.1
N$64: D32.K(C) R166.2
P3_RD0: Q127.G ; also sheet 15
P3_RD0_B: Q128.D R167.1 ; also sheet 17
P3_RD1: Q129.G ; also sheet 15
P3_RD1_B: Q130.D R168.1 ; also sheet 17
P3_RD2: Q131.G ; also sheet 15
P3_RD2_B: Q132.D R169.1 ; also sheet 17
P3_RD3: Q133.G ; also sheet 15
P3_RD3_B: Q134.D R170.1 ; also sheet 17
P3_RD4: Q135.G ; also sheet 15
P3_RD4_B: Q136.D R171.1 ; also sheet 18
P3_RD5: Q137.G ; also sheet 15
P3_RD5_B: Q138.D R172.1 ; also sheet 18
P3_RD6: Q139.G ; also sheet 15
P3_RD6_B: Q140.D R173.1 ; also sheet 18
P3_RD7: Q141.G ; also sheet 15
P3_RD7_B: Q142.D R174.1 ; also sheet 18

## Sheet 15 of 18
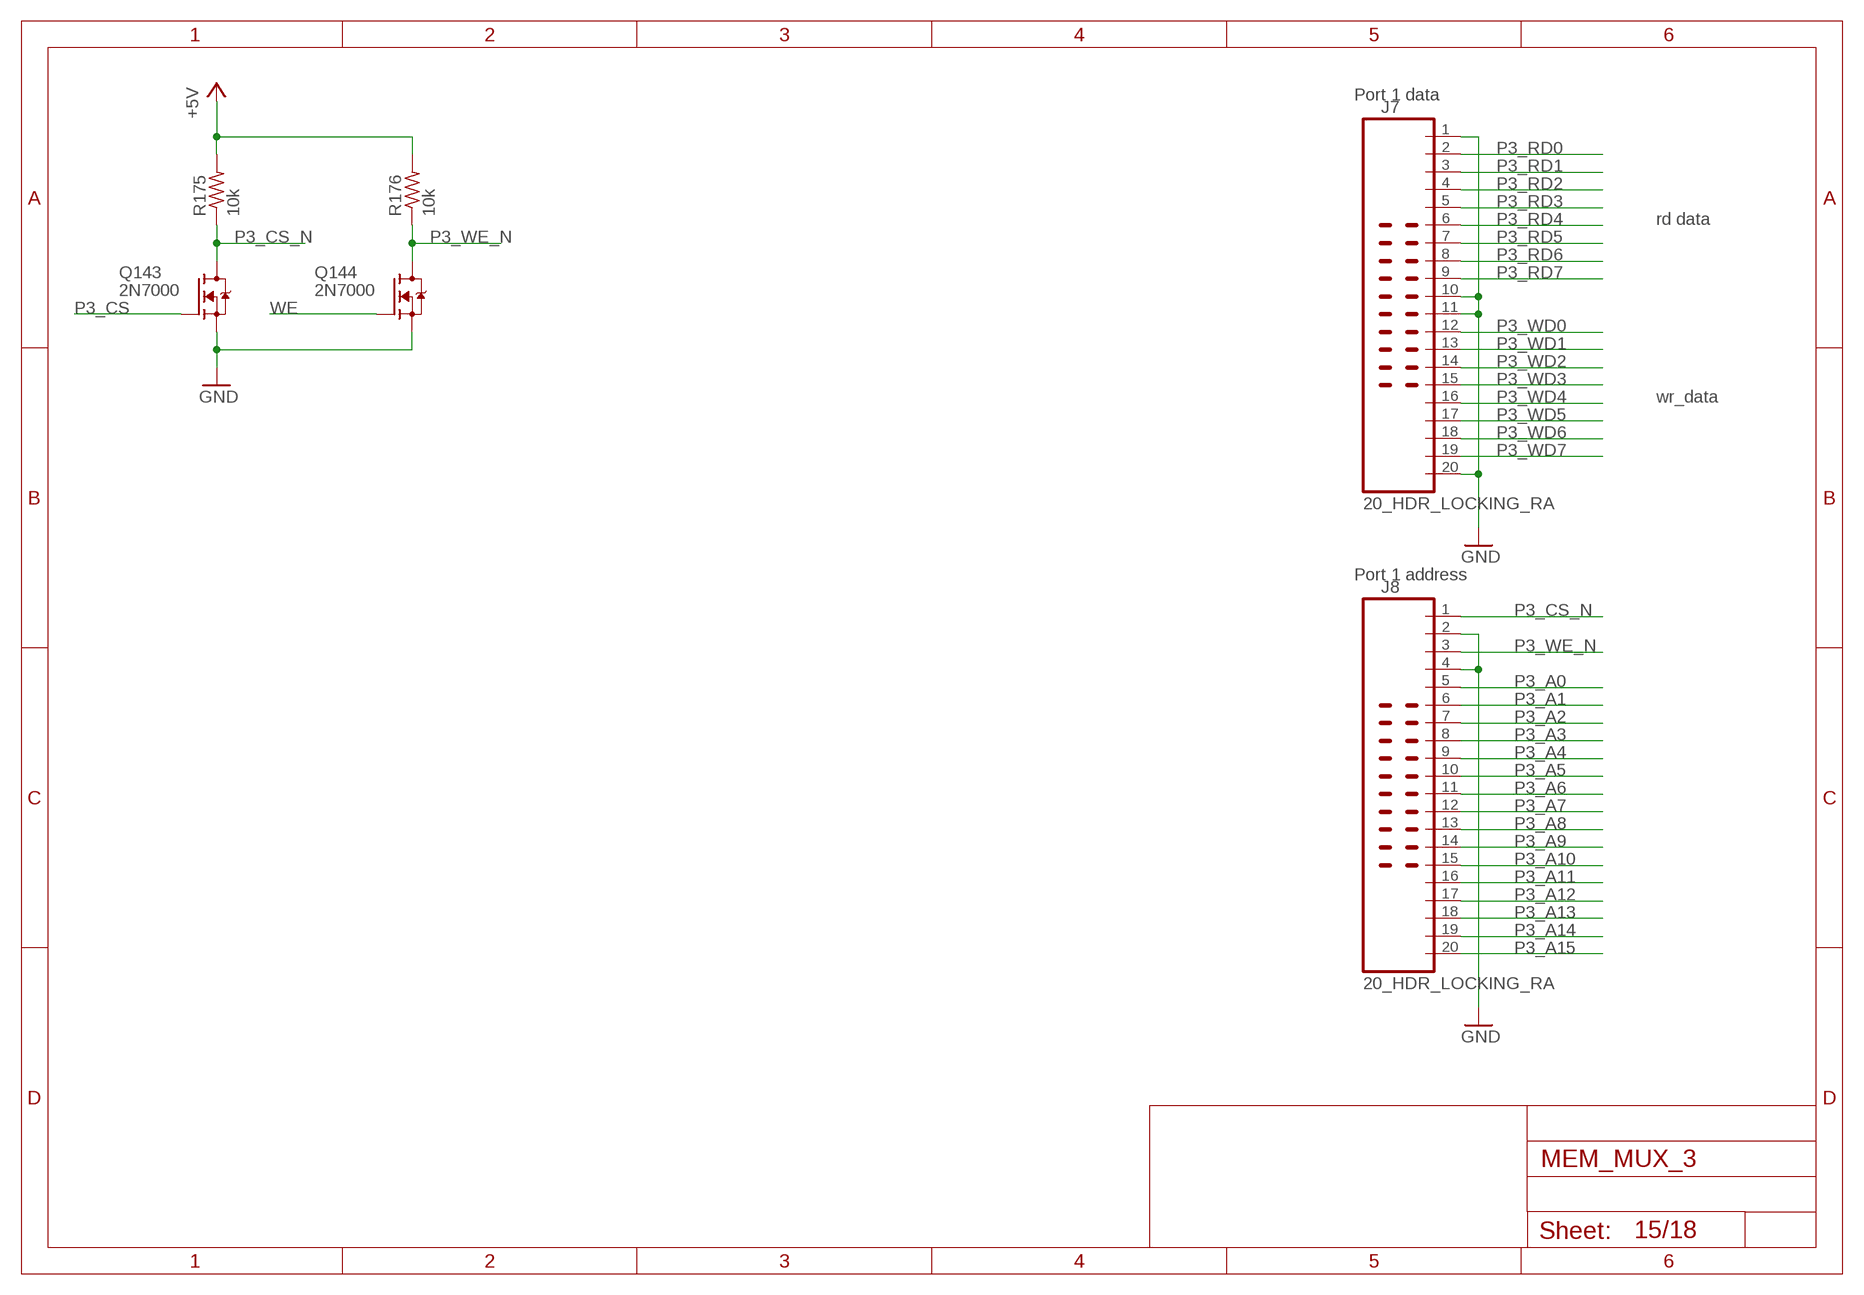
[diagram p14: schematic, sheet 15]

### Parts
J7  20_HDR_LOCKING_RA  [20_HDR_LOCKING_RA]
J8  20_HDR_LOCKING_RA  [20_HDR_LOCKING_RA]
Q143  2N7000  [TO92-DGS]
Q144  2N7000  [TO92-DGS]
R175  10k  R_P2INCH  [R_P2INCH]
R176  10k  R_P2INCH  [R_P2INCH]

### Nets
+5V: R175.2 R176.2 ; also sheet 2,3,4,5,6,7,8,9,10,11,12,13,14,16,17,18
GND: J7.1 J7.10 J7.11 J7.20 J8.2 J8.4 Q143.S Q144.S ; also sheet 2,3,4,5,6,7,8,9,10,11,12,13,14,16,17,18
P3_A0: J8.5 ; also sheet 16
P3_A1: J8.6 ; also sheet 16
P3_A2: J8.7 ; also sheet 16
P3_A3: J8.8 ; also sheet 16
P3_A4: J8.9 ; also sheet 16
P3_A5: J8.10 ; also sheet 16
P3_A6: J8.11 ; also sheet 16
P3_A7: J8.12 ; also sheet 16
P3_A8: J8.13 ; also sheet 16
P3_A9: J8.14 ; also sheet 16
P3_A10: J8.15 ; also sheet 16
P3_A11: J8.16 ; also sheet 16
P3_A12: J8.17 ; also sheet 16
P3_A13: J8.18 ; also sheet 16
P3_A14: J8.19 ; also sheet 16
P3_A15: J8.20 ; also sheet 16
P3_CS: Q143.G ; also sheet 3
P3_CS_N: J8.1 Q143.D R175.1
P3_RD0: J7.2 ; also sheet 14
P3_RD1: J7.3 ; also sheet 14
P3_RD2: J7.4 ; also sheet 14
P3_RD3: J7.5 ; also sheet 14
P3_RD4: J7.6 ; also sheet 14
P3_RD5: J7.7 ; also sheet 14
P3_RD6: J7.8 ; also sheet 14
P3_RD7: J7.9 ; also sheet 14
P3_WD0: J7.12 ; also sheet 16
P3_WD1: J7.13 ; also sheet 16
P3_WD2: J7.14 ; also sheet 16
P3_WD3: J7.15 ; also sheet 16
P3_WD4: J7.16 ; also sheet 16
P3_WD5: J7.17 ; also sheet 16
P3_WD6: J7.18 ; also sheet 16
P3_WD7: J7.19 ; also sheet 16
P3_WE_N: J8.3 Q144.D R176.1
WE: Q144.G ; also sheet 3,6,9,12

### Notes on the sheet
- Port 1 data
- rd data
- wr_data
- Port 1 address

## Sheet 16 of 18
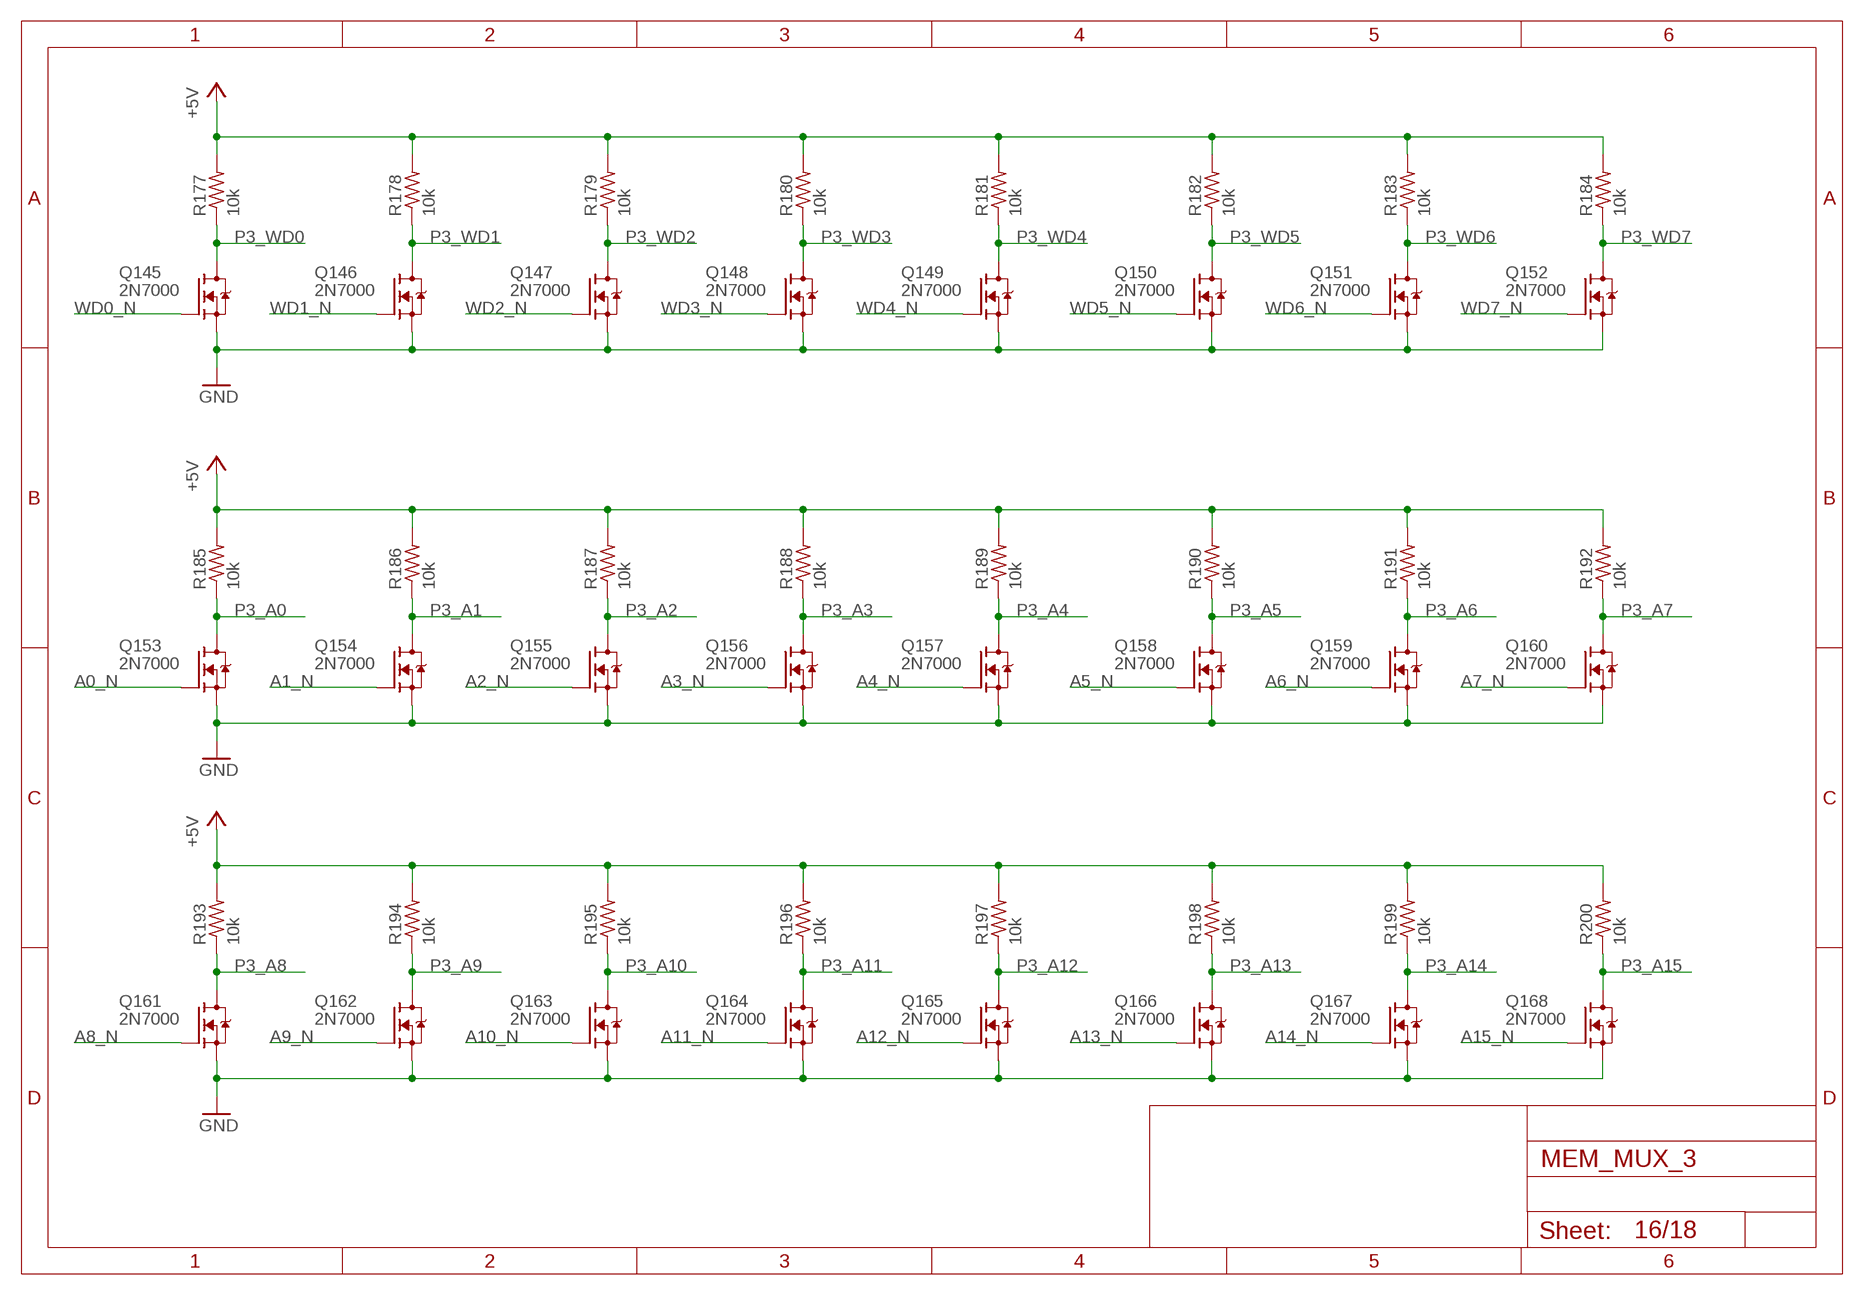
[diagram p15: schematic, sheet 16]

### Parts
Q145  2N7000  [TO92-DGS]
Q146  2N7000  [TO92-DGS]
Q147  2N7000  [TO92-DGS]
Q148  2N7000  [TO92-DGS]
Q149  2N7000  [TO92-DGS]
Q150  2N7000  [TO92-DGS]
Q151  2N7000  [TO92-DGS]
Q152  2N7000  [TO92-DGS]
Q153  2N7000  [TO92-DGS]
Q154  2N7000  [TO92-DGS]
Q155  2N7000  [TO92-DGS]
Q156  2N7000  [TO92-DGS]
Q157  2N7000  [TO92-DGS]
Q158  2N7000  [TO92-DGS]
Q159  2N7000  [TO92-DGS]
Q160  2N7000  [TO92-DGS]
Q161  2N7000  [TO92-DGS]
Q162  2N7000  [TO92-DGS]
Q163  2N7000  [TO92-DGS]
Q164  2N7000  [TO92-DGS]
Q165  2N7000  [TO92-DGS]
Q166  2N7000  [TO92-DGS]
Q167  2N7000  [TO92-DGS]
Q168  2N7000  [TO92-DGS]
R177  10k  R_P2INCH  [R_P2INCH]
R178  10k  R_P2INCH  [R_P2INCH]
R179  10k  R_P2INCH  [R_P2INCH]
R180  10k  R_P2INCH  [R_P2INCH]
R181  10k  R_P2INCH  [R_P2INCH]
R182  10k  R_P2INCH  [R_P2INCH]
R183  10k  R_P2INCH  [R_P2INCH]
R184  10k  R_P2INCH  [R_P2INCH]
R185  10k  R_P2INCH  [R_P2INCH]
R186  10k  R_P2INCH  [R_P2INCH]
R187  10k  R_P2INCH  [R_P2INCH]
R188  10k  R_P2INCH  [R_P2INCH]
R189  10k  R_P2INCH  [R_P2INCH]
R190  10k  R_P2INCH  [R_P2INCH]
R191  10k  R_P2INCH  [R_P2INCH]
R192  10k  R_P2INCH  [R_P2INCH]
R193  10k  R_P2INCH  [R_P2INCH]
R194  10k  R_P2INCH  [R_P2INCH]
R195  10k  R_P2INCH  [R_P2INCH]
R196  10k  R_P2INCH  [R_P2INCH]
R197  10k  R_P2INCH  [R_P2INCH]
R198  10k  R_P2INCH  [R_P2INCH]
R199  10k  R_P2INCH  [R_P2INCH]
R200  10k  R_P2INCH  [R_P2INCH]

### Nets
+5V: R177.2 R178.2 R179.2 R180.2 R181.2 R182.2 R183.2 R184.2 R185.2 R186.2 R187.2 R188.2 R189.2 R190.2 R191.2 R192.2 R193.2 R194.2 R195.2 R196.2 R197.2 R198.2 R199.2 R200.2 ; also sheet 2,3,4,5,6,7,8,9,10,11,12,13,14,15,17,18
A0_N: Q153.G ; also sheet 3,4,7,10,13
A1_N: Q154.G ; also sheet 3,4,7,10,13
A2_N: Q155.G ; also sheet 3,4,7,10,13
A3_N: Q156.G ; also sheet 3,4,7,10,13
A4_N: Q157.G ; also sheet 3,4,7,10,13
A5_N: Q158.G ; also sheet 3,4,7,10,13
A6_N: Q159.G ; also sheet 3,4,7,10,13
A7_N: Q160.G ; also sheet 3,4,7,10,13
A8_N: Q161.G ; also sheet 3,4,7,10,13
A9_N: Q162.G ; also sheet 3,4,7,10,13
A10_N: Q163.G ; also sheet 3,4,7,10,13
A11_N: Q164.G ; also sheet 3,4,7,10,13
A12_N: Q165.G ; also sheet 3,4,7,10,13
A13_N: Q166.G ; also sheet 3,4,7,10,13
A14_N: Q167.G ; also sheet 3,4,7,10,13
A15_N: Q168.G ; also sheet 3,4,7,10,13
GND: Q145.S Q146.S Q147.S Q148.S Q149.S Q150.S Q151.S Q152.S Q153.S Q154.S Q155.S Q156.S Q157.S Q158.S Q159.S Q160.S Q161.S Q162.S Q163.S Q164.S Q165.S Q166.S Q167.S Q168.S ; also sheet 2,3,4,5,6,7,8,9,10,11,12,13,14,15,17,18
P3_A0: Q153.D R185.1 ; also sheet 15
P3_A1: Q154.D R186.1 ; also sheet 15
P3_A2: Q155.D R187.1 ; also sheet 15
P3_A3: Q156.D R188.1 ; also sheet 15
P3_A4: Q157.D R189.1 ; also sheet 15
P3_A5: Q158.D R190.1 ; also sheet 15
P3_A6: Q159.D R191.1 ; also sheet 15
P3_A7: Q160.D R192.1 ; also sheet 15
P3_A8: Q161.D R193.1 ; also sheet 15
P3_A9: Q162.D R194.1 ; also sheet 15
P3_A10: Q163.D R195.1 ; also sheet 15
P3_A11: Q164.D R196.1 ; also sheet 15
P3_A12: Q165.D R197.1 ; also sheet 15
P3_A13: Q166.D R198.1 ; also sheet 15
P3_A14: Q167.D R199.1 ; also sheet 15
P3_A15: Q168.D R200.1 ; also sheet 15
P3_WD0: Q145.D R177.1 ; also sheet 15
P3_WD1: Q146.D R178.1 ; also sheet 15
P3_WD2: Q147.D R179.1 ; also sheet 15
P3_WD3: Q148.D R180.1 ; also sheet 15
P3_WD4: Q149.D R181.1 ; also sheet 15
P3_WD5: Q150.D R182.1 ; also sheet 15
P3_WD6: Q151.D R183.1 ; also sheet 15
P3_WD7: Q152.D R184.1 ; also sheet 15
WD0_N: Q145.G ; also sheet 4,7,10,13
WD1_N: Q146.G ; also sheet 4,7,10,13
WD2_N: Q147.G ; also sheet 4,7,10,13
WD3_N: Q148.G ; also sheet 4,7,10,13
WD4_N: Q149.G ; also sheet 4,7,10,13
WD5_N: Q150.G ; also sheet 4,7,10,13
WD6_N: Q151.G ; also sheet 4,7,10,13
WD7_N: Q152.G ; also sheet 4,7,10,13

## Sheet 17 of 18
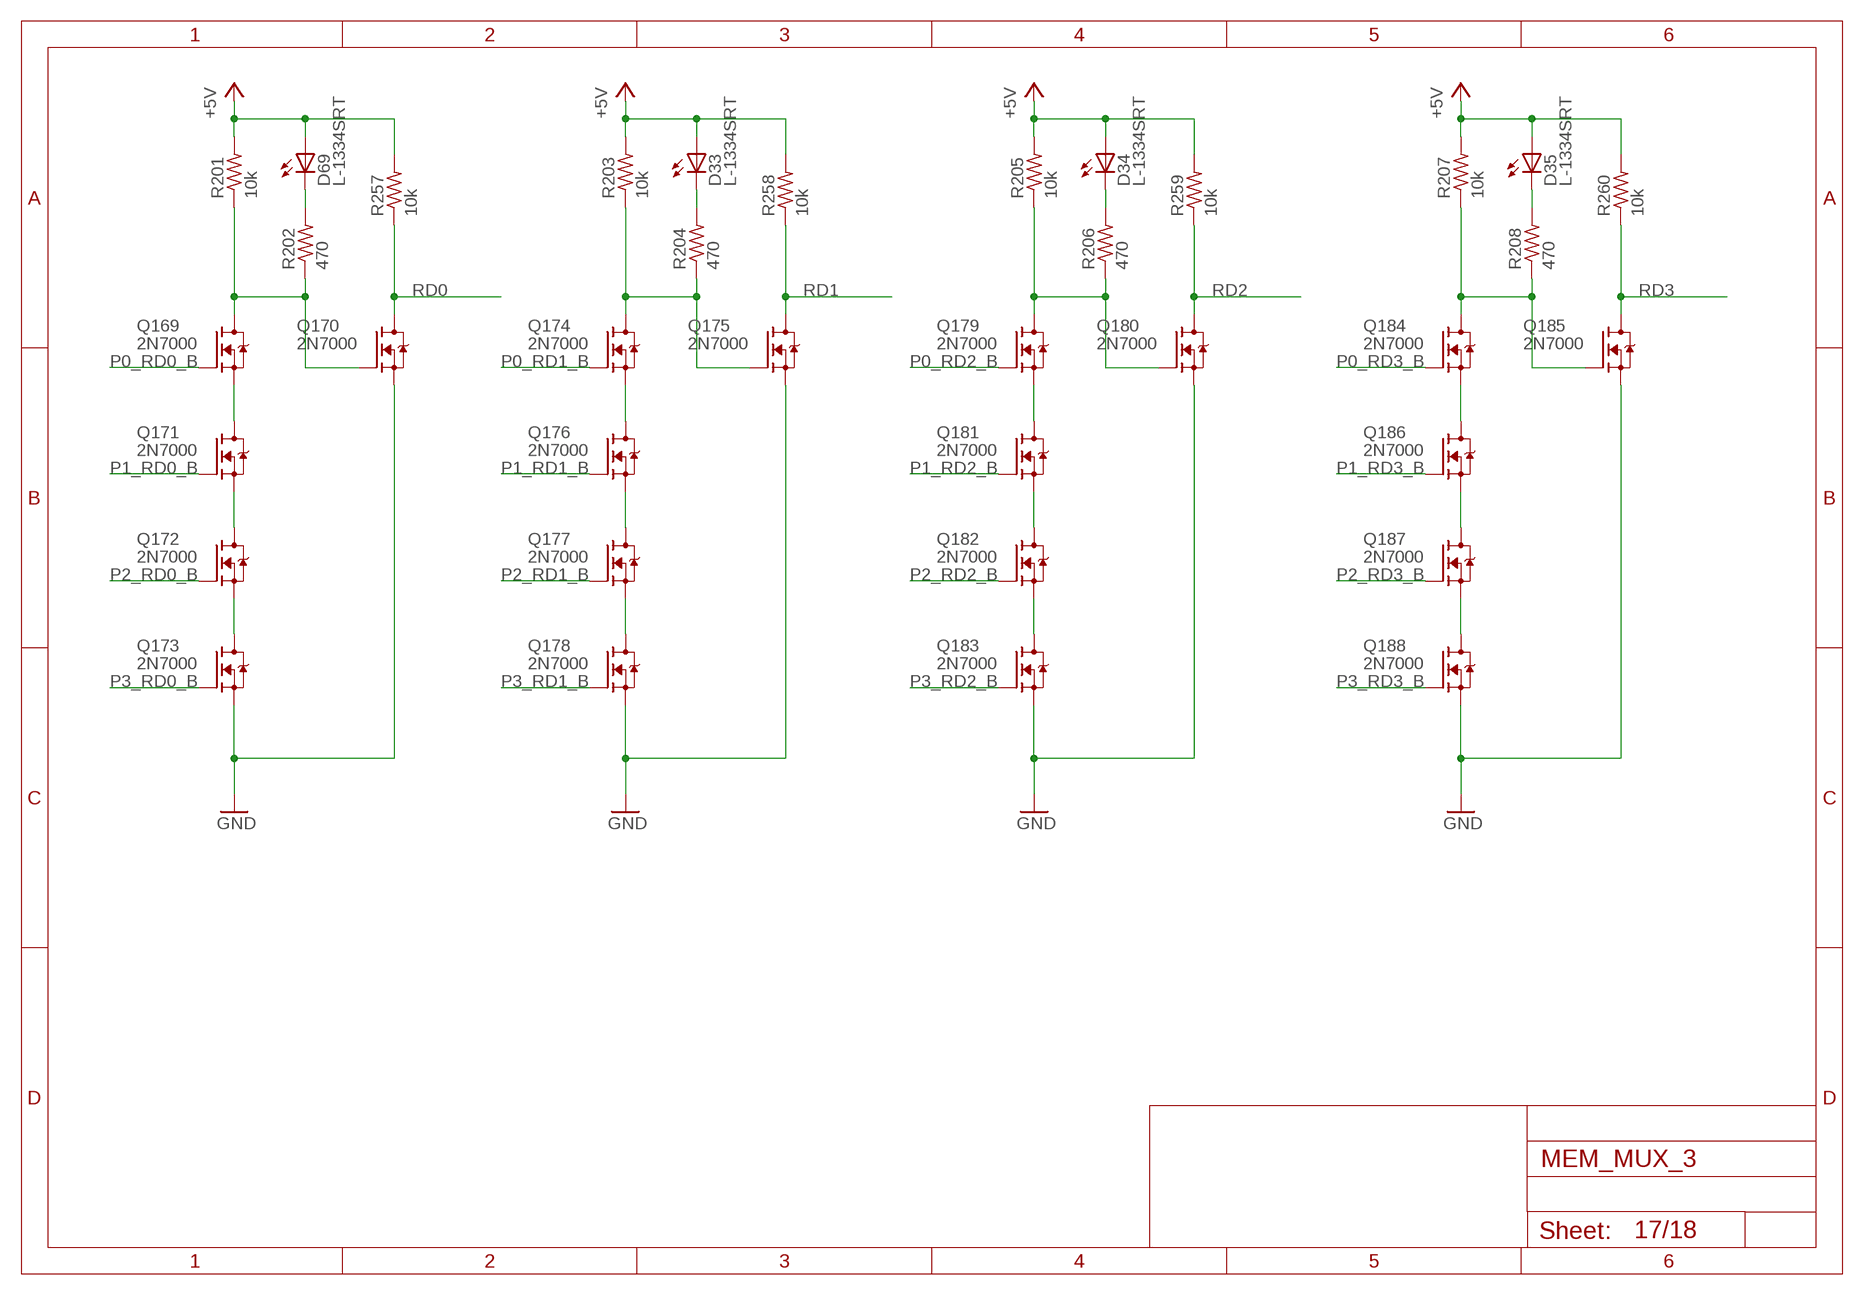
[diagram p16: schematic, sheet 17]

### Parts
D33  L-1334SRT  [LED3MM]
D34  L-1334SRT  [LED3MM]
D35  L-1334SRT  [LED3MM]
D69  L-1334SRT  [LED3MM]
Q169  2N7000  [TO92-DGS]
Q170  2N7000  [TO92-DGS]
Q171  2N7000  [TO92-DGS]
Q172  2N7000  [TO92-DGS]
Q173  2N7000  [TO92-DGS]
Q174  2N7000  [TO92-DGS]
Q175  2N7000  [TO92-DGS]
Q176  2N7000  [TO92-DGS]
Q177  2N7000  [TO92-DGS]
Q178  2N7000  [TO92-DGS]
Q179  2N7000  [TO92-DGS]
Q180  2N7000  [TO92-DGS]
Q181  2N7000  [TO92-DGS]
Q182  2N7000  [TO92-DGS]
Q183  2N7000  [TO92-DGS]
Q184  2N7000  [TO92-DGS]
Q185  2N7000  [TO92-DGS]
Q186  2N7000  [TO92-DGS]
Q187  2N7000  [TO92-DGS]
Q188  2N7000  [TO92-DGS]
R201  10k  R_P2INCH  [R_P2INCH]
R202  470  R_P2INCH  [R_P2INCH]
R203  10k  R_P2INCH  [R_P2INCH]
R204  470  R_P2INCH  [R_P2INCH]
R205  10k  R_P2INCH  [R_P2INCH]
R206  470  R_P2INCH  [R_P2INCH]
R207  10k  R_P2INCH  [R_P2INCH]
R208  470  R_P2INCH  [R_P2INCH]
R257  10k  R_P2INCH  [R_P2INCH]
R258  10k  R_P2INCH  [R_P2INCH]
R259  10k  R_P2INCH  [R_P2INCH]
R260  10k  R_P2INCH  [R_P2INCH]

### Nets
+5V: D33.A D34.A D35.A D69.A R201.2 R203.2 R205.2 R207.2 R257.2 R258.2 R259.2 R260.2 ; also sheet 2,3,4,5,6,7,8,9,10,11,12,13,14,15,16,18
GND: Q170.S Q173.S Q175.S Q178.S Q180.S Q183.S Q185.S Q188.S ; also sheet 2,3,4,5,6,7,8,9,10,11,12,13,14,15,16,18
N$65: Q174.D Q175.G R203.1 R204.1
N$66: D33.K(C) R204.2
N$67: Q177.S Q178.D
N$68: Q176.S Q177.D
N$69: Q174.S Q176.D
N$70: Q179.D Q180.G R205.1 R206.1
N$71: D34.K(C) R206.2
N$72: Q182.S Q183.D
N$73: Q181.S Q182.D
N$74: Q179.S Q181.D
N$75: Q184.D Q185.G R207.1 R208.1
N$76: D35.K(C) R208.2
N$77: Q187.S Q188.D
N$78: Q186.S Q187.D
N$79: Q184.S Q186.D
N$133: Q169.D Q170.G R201.1 R202.1
N$134: D69.K(C) R202.2
N$135: Q172.S Q173.D
N$136: Q171.S Q172.D
N$137: Q169.S Q171.D
P0_RD0_B: Q169.G ; also sheet 5
P0_RD1_B: Q174.G ; also sheet 5
P0_RD2_B: Q179.G ; also sheet 5
P0_RD3_B: Q184.G ; also sheet 5
P1_RD0_B: Q171.G ; also sheet 8
P1_RD1_B: Q176.G ; also sheet 8
P1_RD2_B: Q181.G ; also sheet 8
P1_RD3_B: Q186.G ; also sheet 8
P2_RD0_B: Q172.G ; also sheet 11
P2_RD1_B: Q177.G ; also sheet 11
P2_RD2_B: Q182.G ; also sheet 11
P2_RD3_B: Q187.G ; also sheet 11
P3_RD0_B: Q173.G ; also sheet 14
P3_RD1_B: Q178.G ; also sheet 14
P3_RD2_B: Q183.G ; also sheet 14
P3_RD3_B: Q188.G ; also sheet 14
RD0: Q170.D R257.1 ; also sheet 3
RD1: Q175.D R258.1 ; also sheet 3
RD2: Q180.D R259.1 ; also sheet 3
RD3: Q185.D R260.1 ; also sheet 3

## Sheet 18 of 18
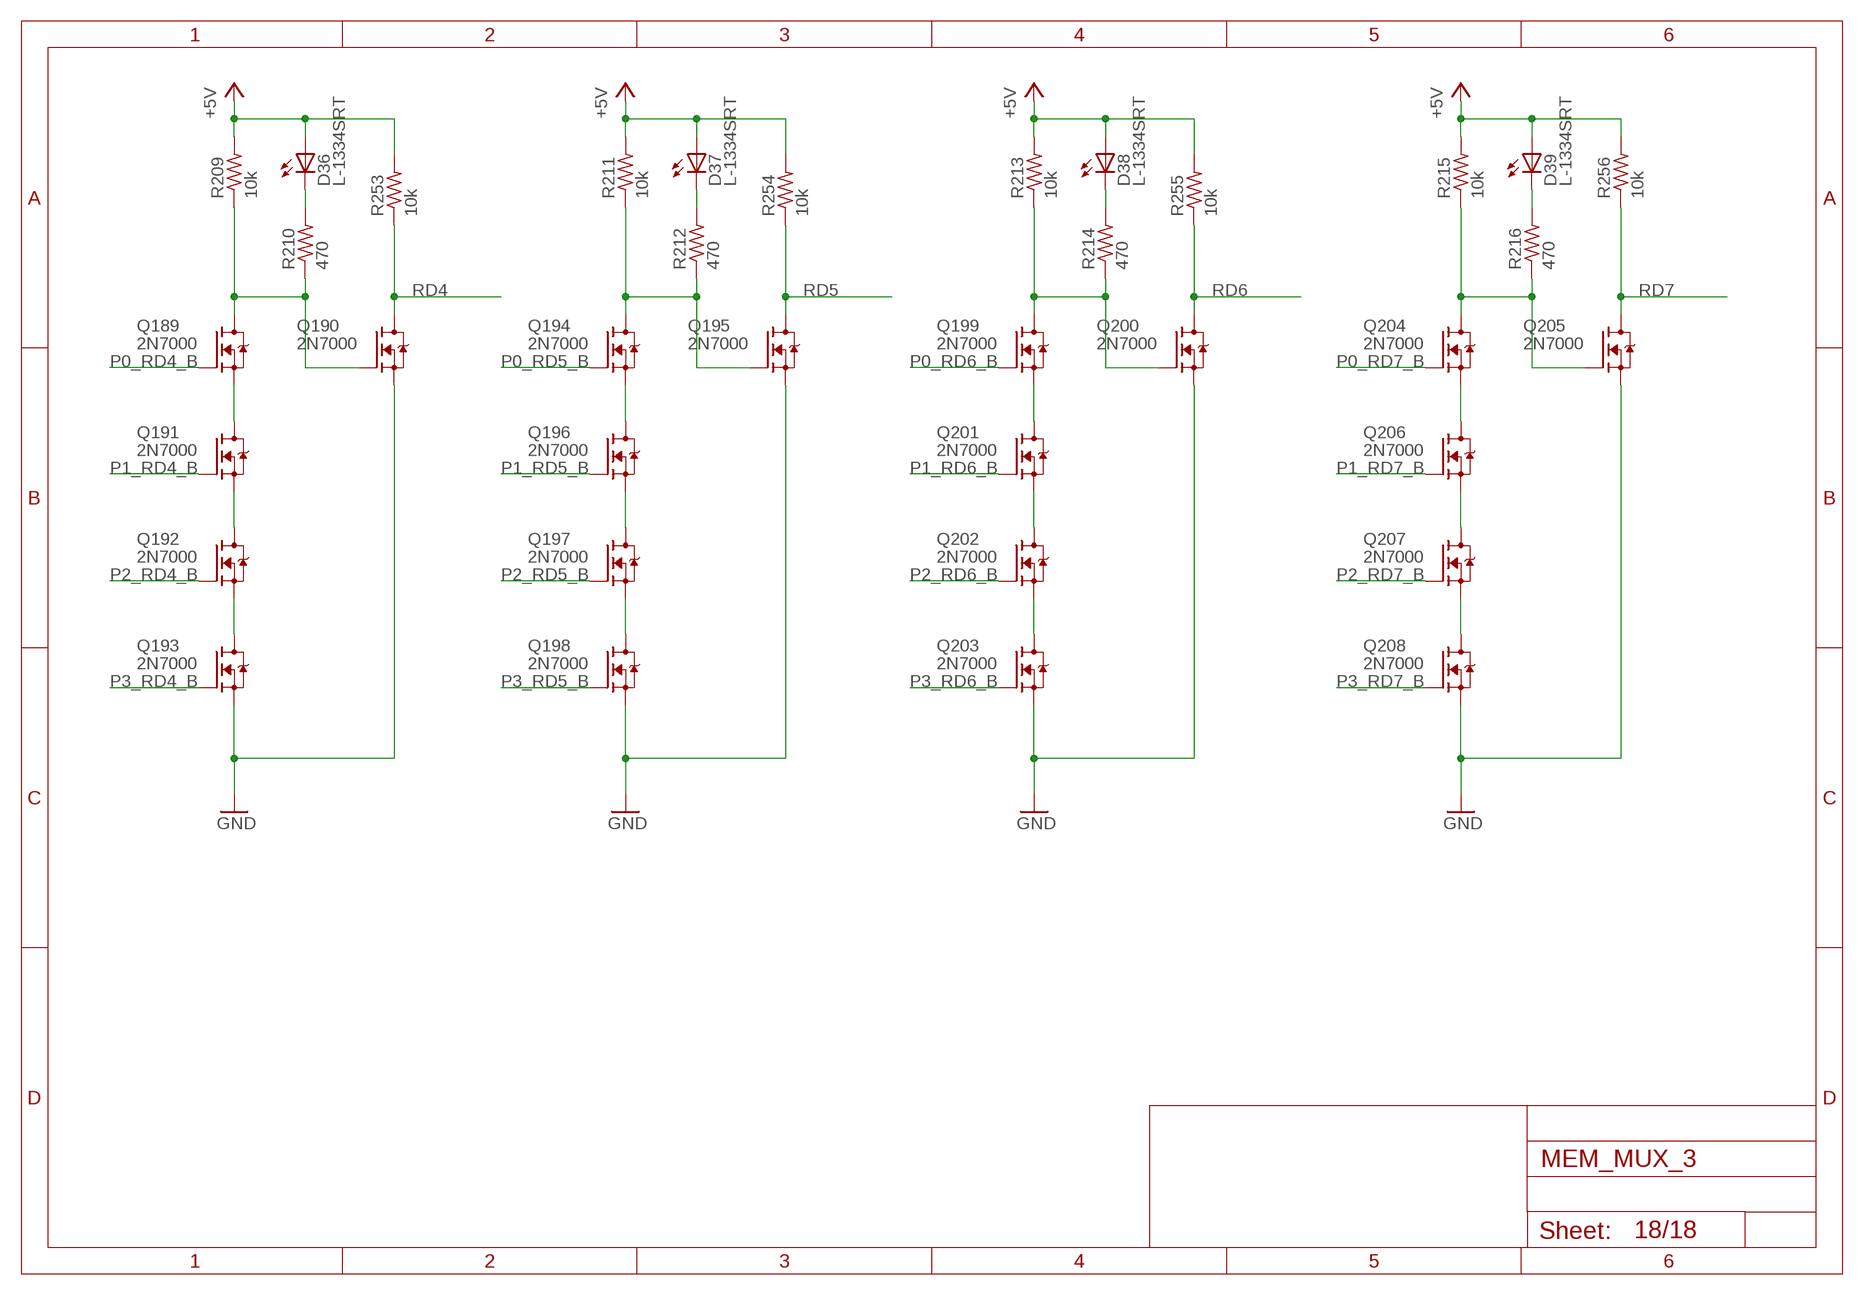
[diagram p17: schematic, sheet 18]

### Parts
D36  L-1334SRT  [LED3MM]
D37  L-1334SRT  [LED3MM]
D38  L-1334SRT  [LED3MM]
D39  L-1334SRT  [LED3MM]
Q189  2N7000  [TO92-DGS]
Q190  2N7000  [TO92-DGS]
Q191  2N7000  [TO92-DGS]
Q192  2N7000  [TO92-DGS]
Q193  2N7000  [TO92-DGS]
Q194  2N7000  [TO92-DGS]
Q195  2N7000  [TO92-DGS]
Q196  2N7000  [TO92-DGS]
Q197  2N7000  [TO92-DGS]
Q198  2N7000  [TO92-DGS]
Q199  2N7000  [TO92-DGS]
Q200  2N7000  [TO92-DGS]
Q201  2N7000  [TO92-DGS]
Q202  2N7000  [TO92-DGS]
Q203  2N7000  [TO92-DGS]
Q204  2N7000  [TO92-DGS]
Q205  2N7000  [TO92-DGS]
Q206  2N7000  [TO92-DGS]
Q207  2N7000  [TO92-DGS]
Q208  2N7000  [TO92-DGS]
R209  10k  R_P2INCH  [R_P2INCH]
R210  470  R_P2INCH  [R_P2INCH]
R211  10k  R_P2INCH  [R_P2INCH]
R212  470  R_P2INCH  [R_P2INCH]
R213  10k  R_P2INCH  [R_P2INCH]
R214  470  R_P2INCH  [R_P2INCH]
R215  10k  R_P2INCH  [R_P2INCH]
R216  470  R_P2INCH  [R_P2INCH]
R253  10k  R_P2INCH  [R_P2INCH]
R254  10k  R_P2INCH  [R_P2INCH]
R255  10k  R_P2INCH  [R_P2INCH]
R256  10k  R_P2INCH  [R_P2INCH]

### Nets
+5V: D36.A D37.A D38.A D39.A R209.2 R211.2 R213.2 R215.2 R253.2 R254.2 R255.2 R256.2 ; also sheet 2,3,4,5,6,7,8,9,10,11,12,13,14,15,16,17
GND: Q190.S Q193.S Q195.S Q198.S Q200.S Q203.S Q205.S Q208.S ; also sheet 2,3,4,5,6,7,8,9,10,11,12,13,14,15,16,17
N$80: Q189.D Q190.G R209.1 R210.1
N$81: D36.K(C) R210.2
N$82: Q192.S Q193.D
N$83: Q191.S Q192.D
N$84: Q189.S Q191.D
N$85: Q194.D Q195.G R211.1 R212.1
N$86: D37.K(C) R212.2
N$87: Q197.S Q198.D
N$88: Q196.S Q197.D
N$89: Q194.S Q196.D
N$90: Q199.D Q200.G R213.1 R214.1
N$91: D38.K(C) R214.2
N$92: Q202.S Q203.D
N$93: Q201.S Q202.D
N$94: Q199.S Q201.D
N$95: Q204.D Q205.G R215.1 R216.1
N$96: D39.K(C) R216.2
N$97: Q207.S Q208.D
N$98: Q206.S Q207.D
N$99: Q204.S Q206.D
P0_RD4_B: Q189.G ; also sheet 5
P0_RD5_B: Q194.G ; also sheet 5
P0_RD6_B: Q199.G ; also sheet 5
P0_RD7_B: Q204.G ; also sheet 5
P1_RD4_B: Q191.G ; also sheet 8
P1_RD5_B: Q196.G ; also sheet 8
P1_RD6_B: Q201.G ; also sheet 8
P1_RD7_B: Q206.G ; also sheet 8
P2_RD4_B: Q192.G ; also sheet 11
P2_RD5_B: Q197.G ; also sheet 11
P2_RD6_B: Q202.G ; also sheet 11
P2_RD7_B: Q207.G ; also sheet 11
P3_RD4_B: Q193.G ; also sheet 14
P3_RD5_B: Q198.G ; also sheet 14
P3_RD6_B: Q203.G ; also sheet 14
P3_RD7_B: Q208.G ; also sheet 14
RD4: Q190.D R253.1 ; also sheet 3
RD5: Q195.D R254.1 ; also sheet 3
RD6: Q200.D R255.1 ; also sheet 3
RD7: Q205.D R256.1 ; also sheet 3

## Library data of the parts
C1-C6 C8 = MyLib:C_P2INCH
C7 = MyLib:POLARISED_CAP_2P5_6P3MM
D1-D39 D69 = MyLib:L-1334SRT
H1-H10 = MyLib:3M_MOUNT_HOLE
J1-J10 = MyLib:20_HDR_LOCKING_RA
J11 = MyLib:JUMP_2X1
J12 = MyLib:JUMP_16X1
Q1-Q252 = MyLib:2N7000
R1-R260 = MyLib:R_P2INCH
TP5 TP6 = MyLib:POWER_PAD